# EasyEDA Pro project ProPrj_25G_2026-07-24.epro

# Schematic Schematic4
Assembly Variant: Basic; Board Name: Board1; Create Date: 2026-07-09; Page Name: P1; Project Name: 25G; Schematic Name: Schematic4; Update Date: 2026-07-09; Company: 嘉立创EDA; Page Size: A4; Version: V1.0
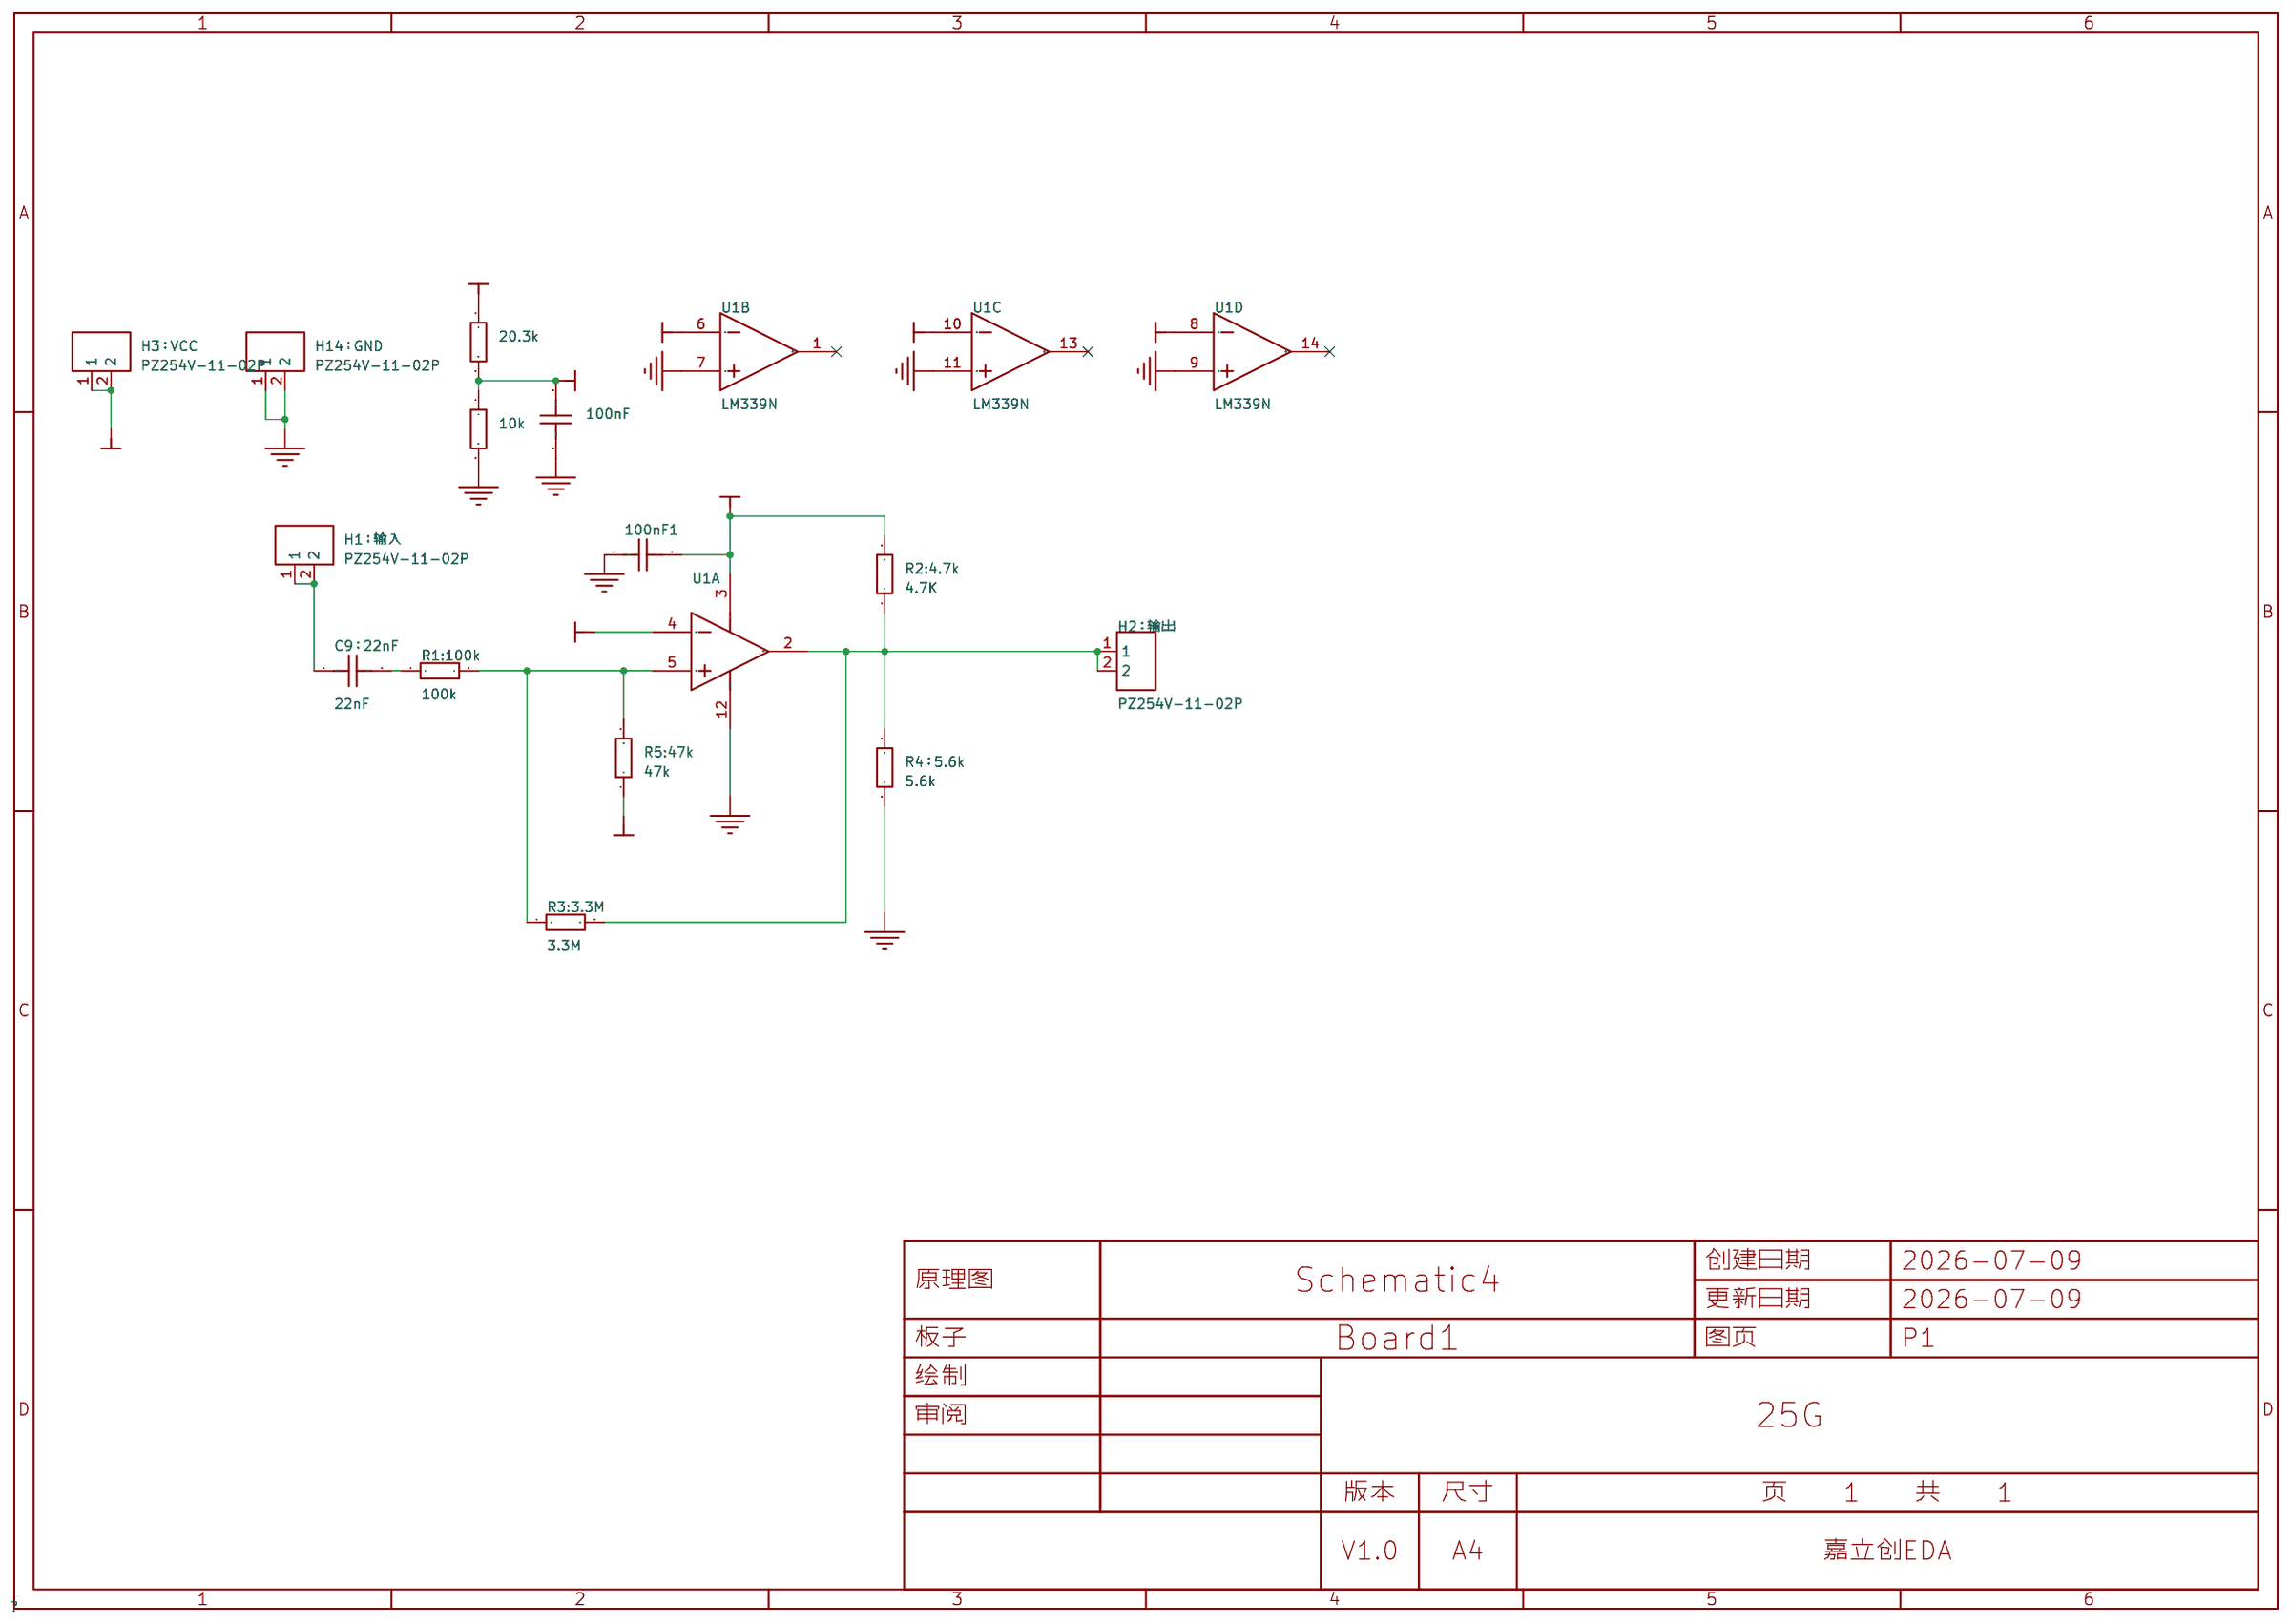
[diagram p0: schematic sheet]

## Parts
10k  20.3k  [R_AXIAL-0.3]
20.3k  20.3k  [R_AXIAL-0.3]
100nF  22nF  [CAP-TH_BD5.3-P2.00-D0.5-FD]
100nF1  22nF  [CAP-TH_BD5.3-P2.00-D0.5-FD]
C9：22nF  22nF  [CAP-TH_BD5.3-P2.00-D0.5-FD]
H1：输入  PZ254V-11-02P  [HDR-TH_2P-P2.54-V-M]
H2：输出  PZ254V-11-02P  [HDR-TH_2P-P2.54-V-M]
H3：VCC  PZ254V-11-02P  [HDR-TH_2P-P2.54-V-M]
H14：GND  PZ254V-11-02P  [HDR-TH_2P-P2.54-V-M]
R1:100k  100k  [R_AXIAL-0.3]
R2:4.7k  4.7K  [R_AXIAL-0.3]
R3:3.3M  3.3M  [R_AXIAL-0.3]
R4：5.6k  5.6k  [R_AXIAL-0.3]
R5:47k  47k  [R_AXIAL-0.3]
U1  LM339N  [PDIP-14_L19.3-W6.4-P2.54-LS9.0-BL]  (sections 1,2,3,4)

## Library data of the parts
10k 20.3k R1:100k R2:4.7k R3:3.3M R4：5.6k R5:47k = Res_0603: Supplier Footprint: 0603
100nF 100nF1 C9：22nF = CAP_0805: Supplier Footprint: 0805
H1：输入 H2：输出 H3：VCC H14：GND = PZ254V-11-02P: 插针结构:1x2P;间距:2.54mm;行距:-;圆针/方针:方针;安装方式:直插;排数:单排;总PIN位数:2P;额定电流:3A;额定电压:250V;配合针长度:6mm;塑高:2.5mm;端接针长度:3mm;触头材质:黄铜;触头镀层:-;工作温度:-40℃~+105℃;颜色:黑色;; LCSC Part Name: 1x2P 间距:2.54mm 方针 直插; Supplier Part: C492401; Manufacturer: XFCN(兴飞); Supplier Footprint: 插件,P=2.54mm; JLCPCB Part Class: Extended Part; Datasheet: https://item.szlcsc.com/datasheet/PZ254V-11-02P/502957.html; Supplier: LCSC; Pin Structure: 1x2P; Pitch: 2.54mm; Circluar Pins/Square Pins: 方针; Mounting Type: 直插; Number of Rows: 单排; Number of Pins: 2P; Current Rating: 3A; Voltage Rating (Max): 250V; Length of Mating Pin: 6mm; Insulation Height: 2.5mm; Length of End Connection Pin: 3mm; Contact Material: 黄铜; Operating Temperature: -40℃~+105℃; Color: 黑色
U1 = LM339N_C39202084: 输入失调电压(Vos):5mV;输入偏置电流(Ib):25nA;; LCSC Part Name: 四差分比较器; Supplier Part: C39202084; Manufacturer: TI(德州仪器); Supplier Footprint: DIP-14; JLCPCB Part Class: Extended Part; Datasheet: https://www.ti.com/lit/gpn/lm339; Supplier: LCSC; Vos - Input Offset Voltage: 5mV; Ib - Input Bias Current: 25nA; Propagation Delay Time: 300ns; Quiescent Current: 2mA; Operating Temperature: -40℃~+85℃

## Nets
GND: 10k.2 100nF.2 100nF1.2 H14：GND.1 H14：GND.2 R4：5.6k.1 U1.7(IN+) U1.9(IN+) U1.11(IN+) U1.12(GND)
VCC: 20.3k.1 100nF1.1 H3：VCC.1 H3：VCC.2 R2:4.7k.2 U1.3(V+)
Vref: 10k.1 20.3k.2 100nF.1 R5:47k.1 U1.4(IN-) U1.6(IN-) U1.8(IN-) U1.10(IN-)
$1N1: C9：22nF.2 H1：输入.1 H1：输入.2
$1N24: C9：22nF.1 R1:100k.1
Net-(H2：输出-1): H2：输出.1 H2：输出.2 R2:4.7k.1 R3:3.3M.2 R4：5.6k.2 U1.2(OUT)
Net-(R1:100k-2): R1:100k.2 R3:3.3M.1 R5:47k.2 U1.5(IN+)

Not connected (* = marked no-connect by the designer): U1 1(OUT)* 13(OUT)* 14(OUT)*

# Schematic Schematic6
Assembly Variant: Basic; Board Name: Board1; Create Date: 2026-07-17; Page Name: P1; Project Name: 25G; Schematic Name: Schematic6; Update Date: 2026-07-17; Company: 嘉立创EDA; Page Size: A4; Version: V1.0
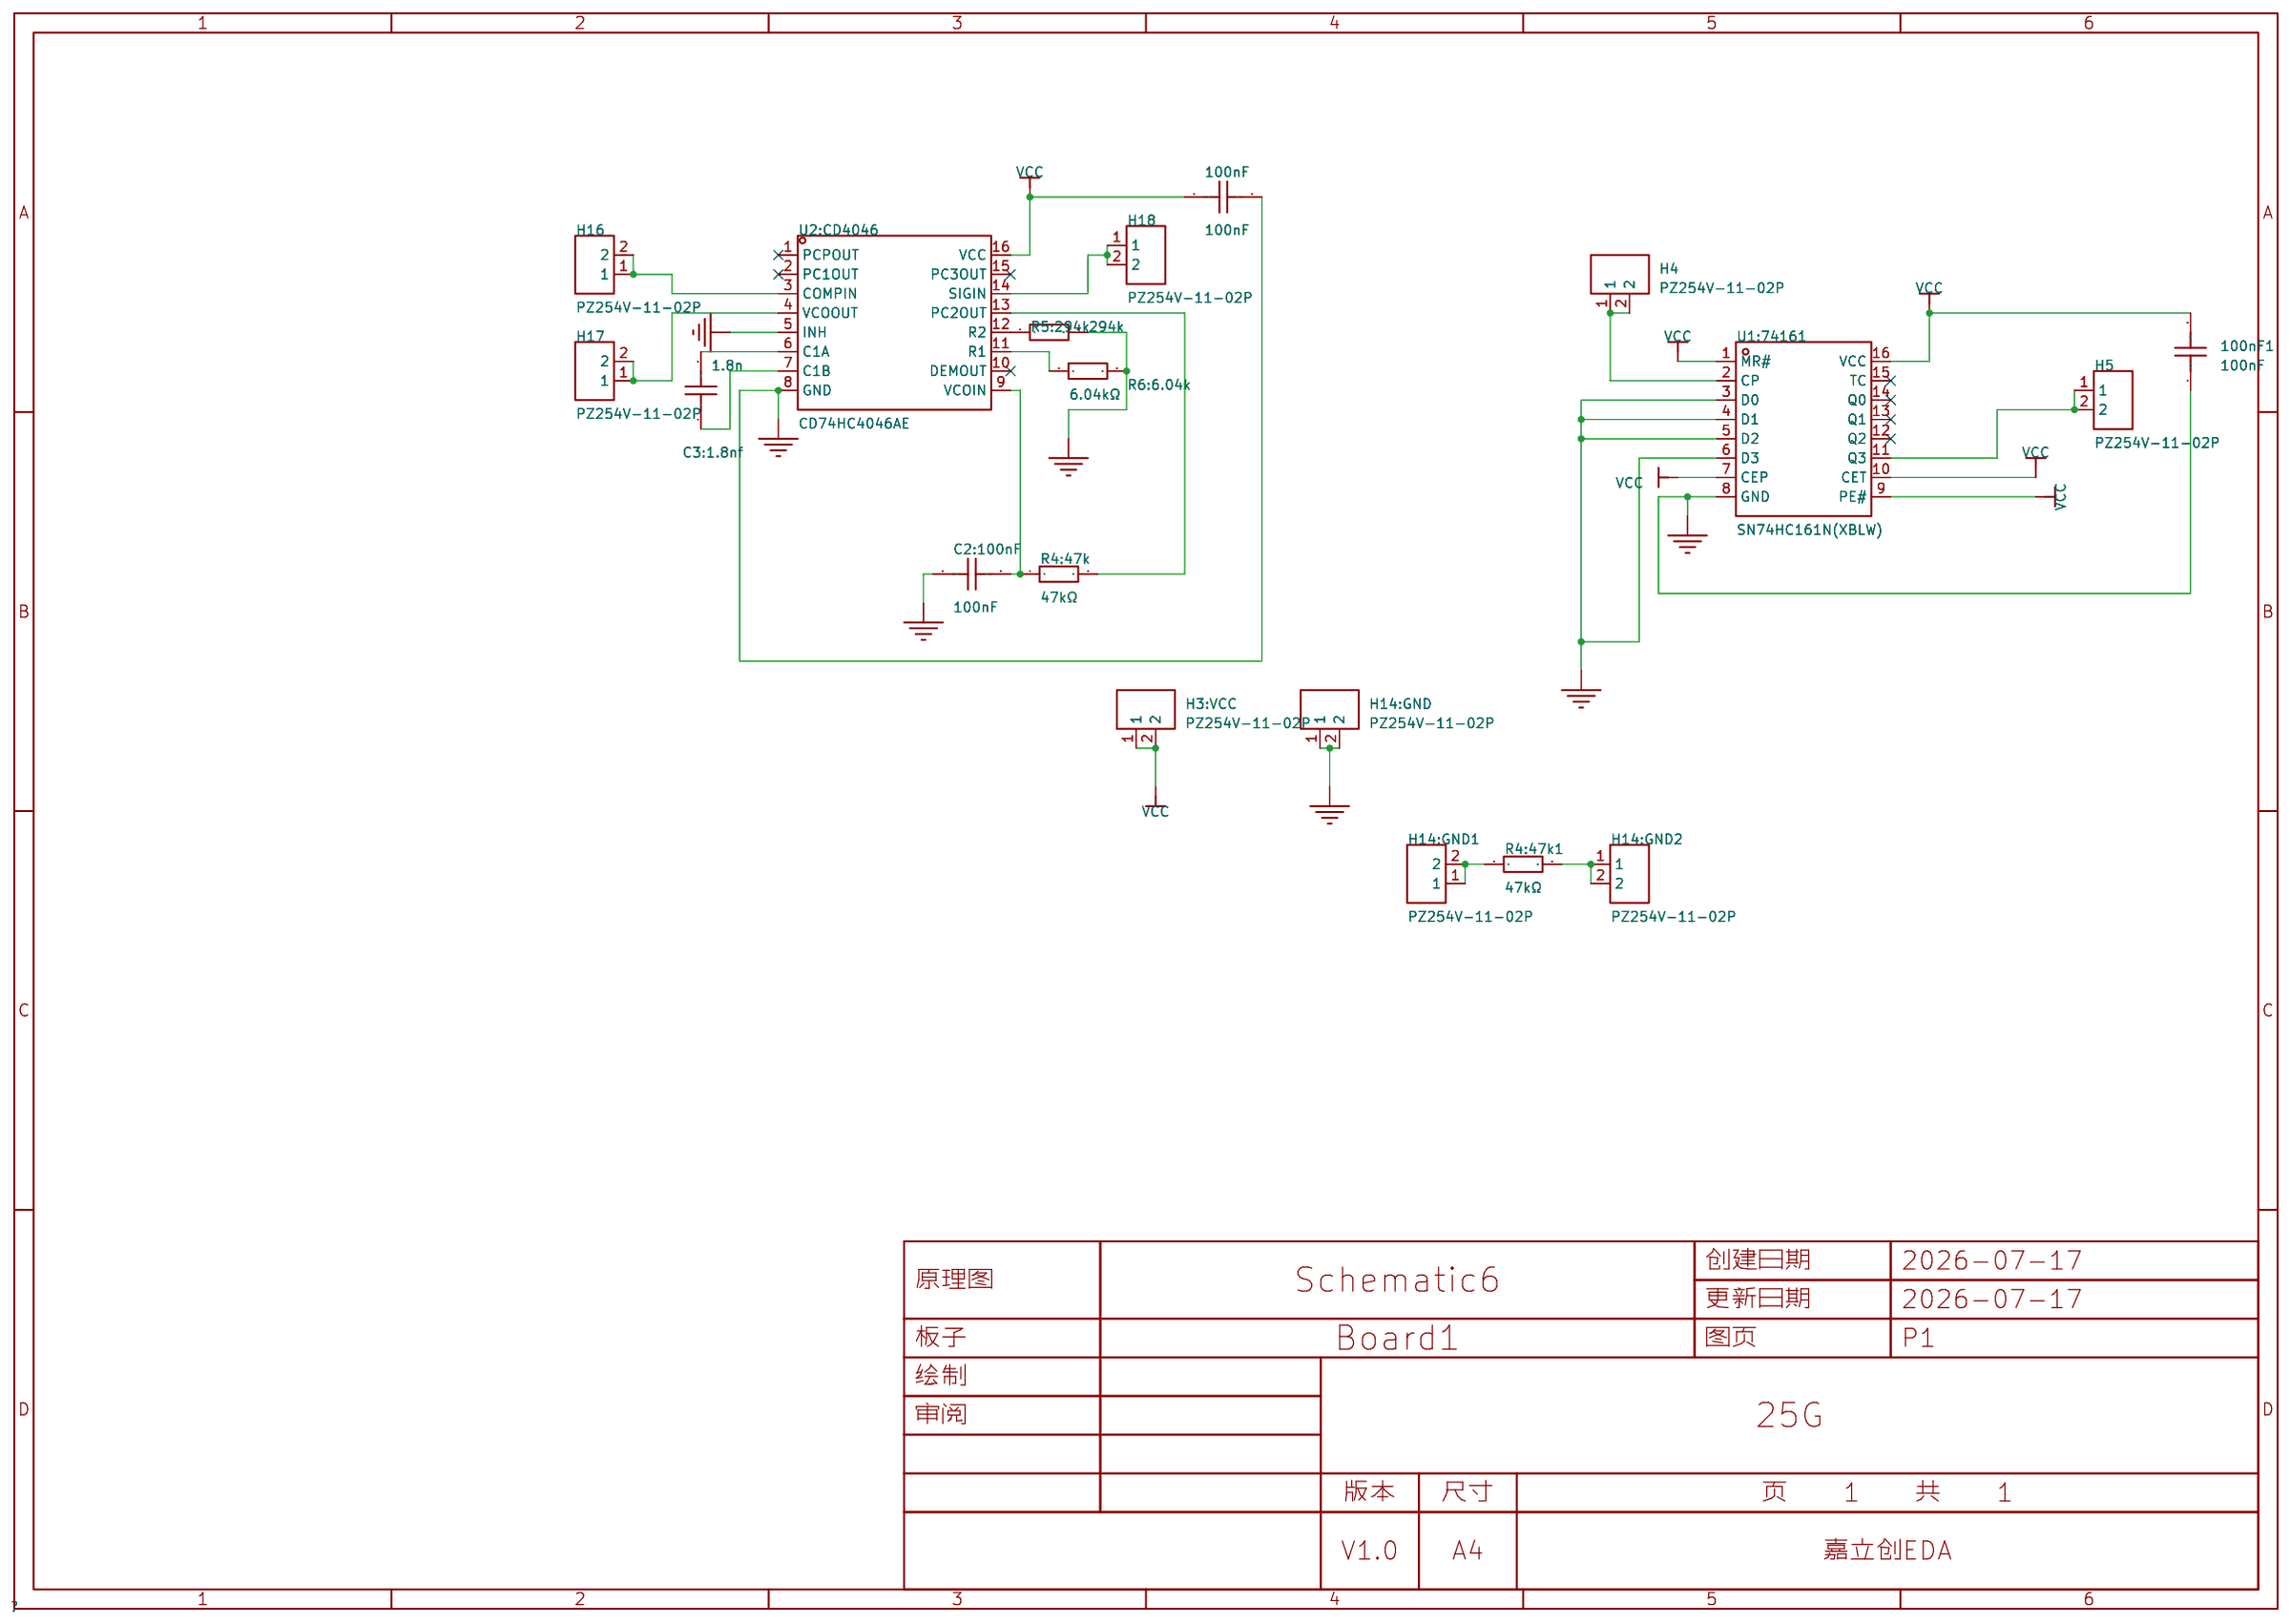
[diagram p1: schematic sheet]

## Parts
100nF  100nF  [CAP-TH_L8.5-W5.0-P5.00-D1.2]
100nF1  100nF  [CAP-TH_L8.5-W5.0-P5.00-D1.2]
C2:100nF  100nF  [CAP-TH_L8.5-W5.0-P5.00-D1.2]
C3:1.8nf  1.8n  [CAP-TH_L8.5-W5.0-P5.00-D1.2]
H3:VCC  PZ254V-11-02P  [HDR-TH_2P-P2.54-V-M]
H4  PZ254V-11-02P  [HDR-TH_2P-P2.54-V-M]
H5  PZ254V-11-02P  [HDR-TH_2P-P2.54-V-M]
H14:GND  PZ254V-11-02P  [HDR-TH_2P-P2.54-V-M]
H14:GND1  PZ254V-11-02P  [HDR-TH_2P-P2.54-V-M]
H14:GND2  PZ254V-11-02P  [HDR-TH_2P-P2.54-V-M]
H16  PZ254V-11-02P  [HDR-TH_2P-P2.54-V-M]
H17  PZ254V-11-02P  [HDR-TH_2P-P2.54-V-M]
H18  PZ254V-11-02P  [HDR-TH_2P-P2.54-V-M]
R4:47k  47kΩ  [R_AXIAL-0.3]
R4:47k1  47kΩ  [R_AXIAL-0.3]
R5:294k  294k  [R_AXIAL-0.3]
R6:6.04k  6.04kΩ  [R_AXIAL-0.3]
U1:74161  SN74HC161N(XBLW)  [PDIP-16_L19.3-W6.4-P2.54-LS7.9-BL]
U2:CD4046  CD74HC4046AE  [PDIP-16_L22.1-W6.3-P2.54-LS7.6-BL]

## Library data of the parts
100nF 100nF1 C2:100nF C3:1.8nf = CT4-0805B104K500F3: 容值:100nF;精度:±10%;额定电压:50V;温度系数:X7R;; LCSC Part Name: 100nF ±10% 50V C3型（直脚）; Supplier Part: C84772; Manufacturer: FH(风华); Supplier Footprint: 插件,P=5.08mm; JLCPCB Part Class: 扩展库; Datasheet: https://atta.szlcsc.com/upload/public/pdf/source/20190402/C385200_059806A6312B28FF1421A2413EB641E1.pdf; Supplier: LCSC; Tolerance: ±10%; Voltage Rated: 50V; Temperature Coefficient: X7R
H3:VCC H4 H5 H14:GND H14:GND1 H14:GND2 H16-H18 = PZ254V-11-02P: 插针结构:1x2P;间距:2.54mm;行距:-;圆针/方针:方针;安装方式:直插;排数:单排;总PIN位数:2P;额定电流:3A;额定电压:250V;配合针长度:6mm;塑高:2.5mm;端接针长度:3mm;触头材质:黄铜;触头镀层:-;工作温度:-40℃~+105℃;颜色:黑色;; LCSC Part Name: 1x2P 间距:2.54mm 方针 直插; Supplier Part: C492401; Manufacturer: XFCN(兴飞); Supplier Footprint: 插件,P=2.54mm; JLCPCB Part Class: Extended Part; Datasheet: https://item.szlcsc.com/datasheet/PZ254V-11-02P/502957.html; Supplier: LCSC; Pin Structure: 1x2P; Pitch: 2.54mm; Circluar Pins/Square Pins: 方针; Mounting Type: 直插; Number of Rows: 单排; Number of Pins: 2P; Current Rating: 3A; Voltage Rating (Max): 250V; Length of Mating Pin: 6mm; Insulation Height: 2.5mm; Length of End Connection Pin: 3mm; Contact Material: 黄铜; Operating Temperature: -40℃~+105℃; Color: 黑色
R4:47k R4:47k1 R5:294k R6:6.04k = Res_AXIAL-1/8W: Supplier Footprint: 轴向引线
U1:74161 = SN74HC161N(XBLW): 工作电压:2V~6V;触发沿:上升沿;计数速率:48MHz;; LCSC Part Name: SN74HC161N; Supplier Part: C18723509; Manufacturer: XBLW(芯伯乐); Supplier Footprint: DIP-16; JLCPCB Part Class: 扩展库; Datasheet: https://atta.szlcsc.com/upload/public/pdf/source/20231019/E4ACCDE238F6D312E2887AAFD4BE47C0.pdf; Supplier: LCSC; Supply Voltage: 2V~6V; Trigger Type: 上升沿; Reset Style: 异步; Timing mode: 同步; Count Rate: 48MHz; Operating Temperature: -40℃~+105℃
U2:CD4046 = CD74HC4046AE: 最大输出频率:38MHz;输出通道数:3;; LCSC Part Name: IC PLL W/VCO; Supplier Part: C354049; Manufacturer: TI(德州仪器); Supplier Footprint: PDIP-16; JLCPCB Part Class: 扩展库; Datasheet: https://www.ti.com/cn/lit/gpn/cd74hc4046a; Supplier: LCSC; Output Frequency(Max): 38MHz; Voltage - Supply: 2V~6V; Number of Outputs: 3; Operating Temperature: -55℃~+125℃

## Nets
GND: 100nF.2 100nF1.1 C2:100nF.1 H14:GND.1 H14:GND.2 R5:294k.2 R6:6.04k.2 U1:74161.3(D0) U1:74161.4(D1) U1:74161.5(D2) U1:74161.6(D3) U1:74161.8(GND) U2:CD4046.5(INH) U2:CD4046.8(GND)
VCC: 100nF.1 100nF1.2 H3:VCC.1 H3:VCC.2 U1:74161.1(MR#) U1:74161.7(CEP) U1:74161.9(PE#) U1:74161.10(CET) U1:74161.16(VCC) U2:CD4046.16(VCC)
$1N3: H18.1 H18.2 U2:CD4046.14(SIGIN)
$1N6: R5:294k.1 U2:CD4046.12(R2)
$1N8: C3:1.8nf.1 U2:CD4046.7(C1B)
$1N9: C3:1.8nf.2 U2:CD4046.6(C1A)
$1N10: R4:47k.2 U2:CD4046.13(PC2OUT)
$1N11: C2:100nF.2 R4:47k.1 U2:CD4046.9(VCOIN)
$1N13: H16.1 H16.2 U2:CD4046.3(COMPIN)
$1N14: H17.1 H17.2 U2:CD4046.4(VCOOUT)
$1N15: H5.1 H5.2 U1:74161.11(Q3)
$1N16: H4.1 H4.2 U1:74161.2(CP)
$1N28: H14:GND2.1 H14:GND2.2 R4:47k1.2
Net-(H14:GND1-1): H14:GND1.1 H14:GND1.2 R4:47k1.1
Net-(R6:6.04k-1): R6:6.04k.1 U2:CD4046.11(R1)

Not connected (* = marked no-connect by the designer): U1:74161 12(Q2)* 13(Q1)* 14(Q0)* 15(TC)*; U2:CD4046 1(PCPOUT)* 2(PC1OUT)* 10(DEMOUT)* 15(PC3OUT)*

# Schematic Schematic5
Assembly Variant: Basic; Board Name: Board1; Create Date: 2026-07-17; Page Name: P1; Project Name: 25G; Schematic Name: Schematic5; Update Date: 2026-07-17; Company: 嘉立创EDA; Page Size: A4; Version: V1.0
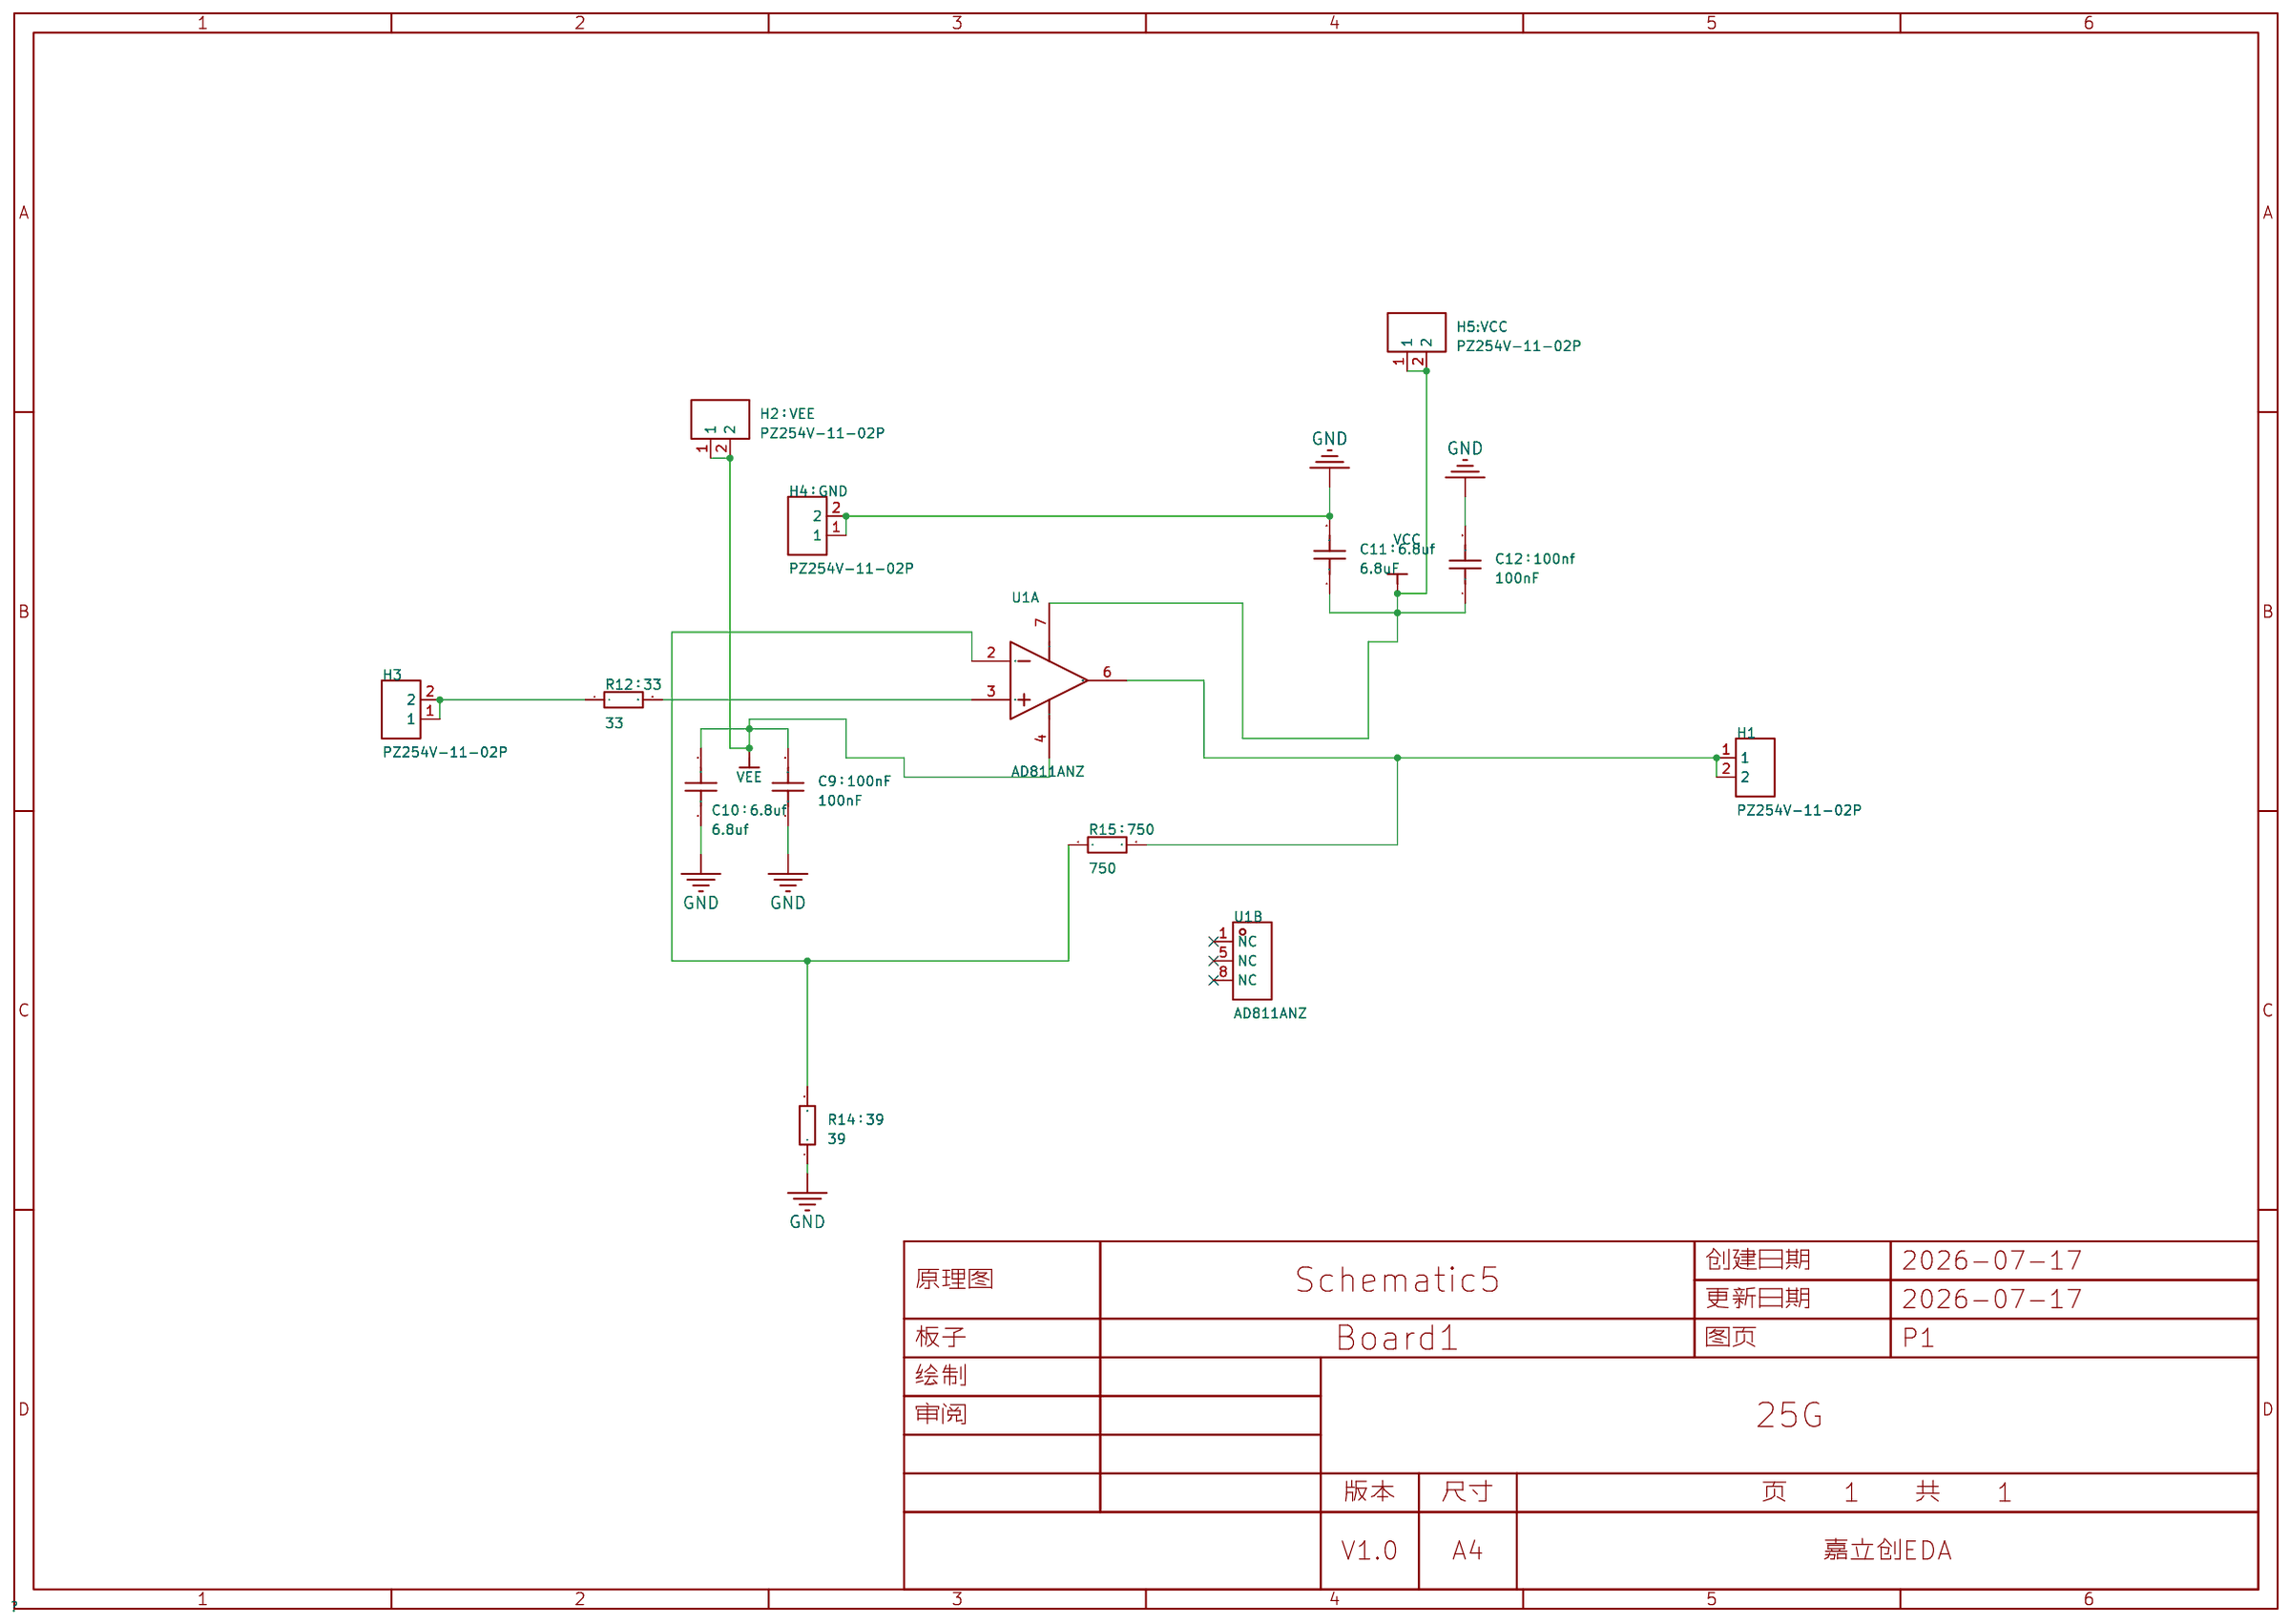
[diagram p2: schematic sheet]

## Parts
C9：100nF  100nF  [CAP-TH_BD5.3-P2.00-D0.5-FD]
C10：6.8uf  6.8uf  [CAP-TH_BD5.3-P2.00-D0.5-FD]
C11：6.8uf  6.8uF  [CAP-TH_BD5.3-P2.00-D0.5-FD]
C12：100nf  100nF  [CAP-TH_BD5.3-P2.00-D0.5-FD]
H1  PZ254V-11-02P  [HDR-TH_2P-P2.54-V-M]
H2：VEE  PZ254V-11-02P  [HDR-TH_2P-P2.54-V-M]
H3  PZ254V-11-02P  [HDR-TH_2P-P2.54-V-M]
H4：GND  PZ254V-11-02P  [HDR-TH_2P-P2.54-V-M]
H5:VCC  PZ254V-11-02P  [HDR-TH_2P-P2.54-V-M]
R12：33  33  [R_AXIAL-0.3]
R14：39  39  [R_AXIAL-0.3]
R15：750  750  [R_AXIAL-0.3]
U1  AD811ANZ  [PDIP-8_L9.3-W6.4-P2.54-LS7.9-BL-1]  (sections 1,2)

## Library data of the parts
C9：100nF C10：6.8uf C11：6.8uf C12：100nf = CAP_0805: Supplier Footprint: 0805
H1 H2：VEE H3 H4：GND H5:VCC = PZ254V-11-02P: 插针结构:1x2P;间距:2.54mm;行距:-;圆针/方针:方针;安装方式:直插;排数:单排;总PIN位数:2P;额定电流:3A;额定电压:250V;配合针长度:6mm;塑高:2.5mm;端接针长度:3mm;触头材质:黄铜;触头镀层:-;工作温度:-40℃~+105℃;颜色:黑色;; LCSC Part Name: 1x2P 间距:2.54mm 方针 直插; Supplier Part: C492401; Manufacturer: XFCN(兴飞); Supplier Footprint: 插件,P=2.54mm; JLCPCB Part Class: Extended Part; Datasheet: https://item.szlcsc.com/datasheet/PZ254V-11-02P/502957.html; Supplier: LCSC; Pin Structure: 1x2P; Pitch: 2.54mm; Circluar Pins/Square Pins: 方针; Mounting Type: 直插; Number of Rows: 单排; Number of Pins: 2P; Current Rating: 3A; Voltage Rating (Max): 250V; Length of Mating Pin: 6mm; Insulation Height: 2.5mm; Length of End Connection Pin: 3mm; Contact Material: 黄铜; Operating Temperature: -40℃~+105℃; Color: 黑色
R12：33 R14：39 R15：750 = Res_0805: Supplier Footprint: 0805
U1 = AD811ANZ: 放大器数:单路;带宽(-3db):140MHz;压摆率(SR):2500V/us;输入偏置电流(Ib):2uA;; LCSC Part Name: 高带宽电流反馈运算放大器; Supplier Part: C578626; Manufacturer: ADI(亚德诺); Supplier Footprint: PDIP-8; JLCPCB Part Class: Extended Part; Datasheet: https://item.szlcsc.com/datasheet/AD811ANZ/606403.html; Supplier: LCSC; Number of Channels: 单路; -3dB Bandwidth: 140MHz; Slew Rate: 2500V/us; Differential Gain: 0.01%; Differential Phase: 0.01deg; Voltage - Supply: 4.5V~18V；-18V~-4.5V; Ib - Input Bias Current: 2uA; Operating Temperature: -40℃~+85℃

## Nets
GND: C9：100nF.1 C10：6.8uf.1 C11：6.8uf.2 C12：100nf.2 H4：GND.1 H4：GND.2 R14：39.1
VCC: C11：6.8uf.1 C12：100nf.1 H5:VCC.1 H5:VCC.2 U1.7(V+)
VEE: C9：100nF.2 C10：6.8uf.2 H2：VEE.1 H2：VEE.2 U1.4(V-)
$1N1: H1.1 H1.2 R15：750.2 U1.6(OUT)
$1N3: R14：39.2 R15：750.1 U1.2(IN-)
$1N6: H3.1 H3.2 R12：33.1
$1N15: R12：33.2 U1.3(IN+)

Not connected (* = marked no-connect by the designer): U1 1(NC)* 5(NC)* 8(NC)*

# Schematic Schematic1
Board Name: Board1; Create Date: 2025-07-21
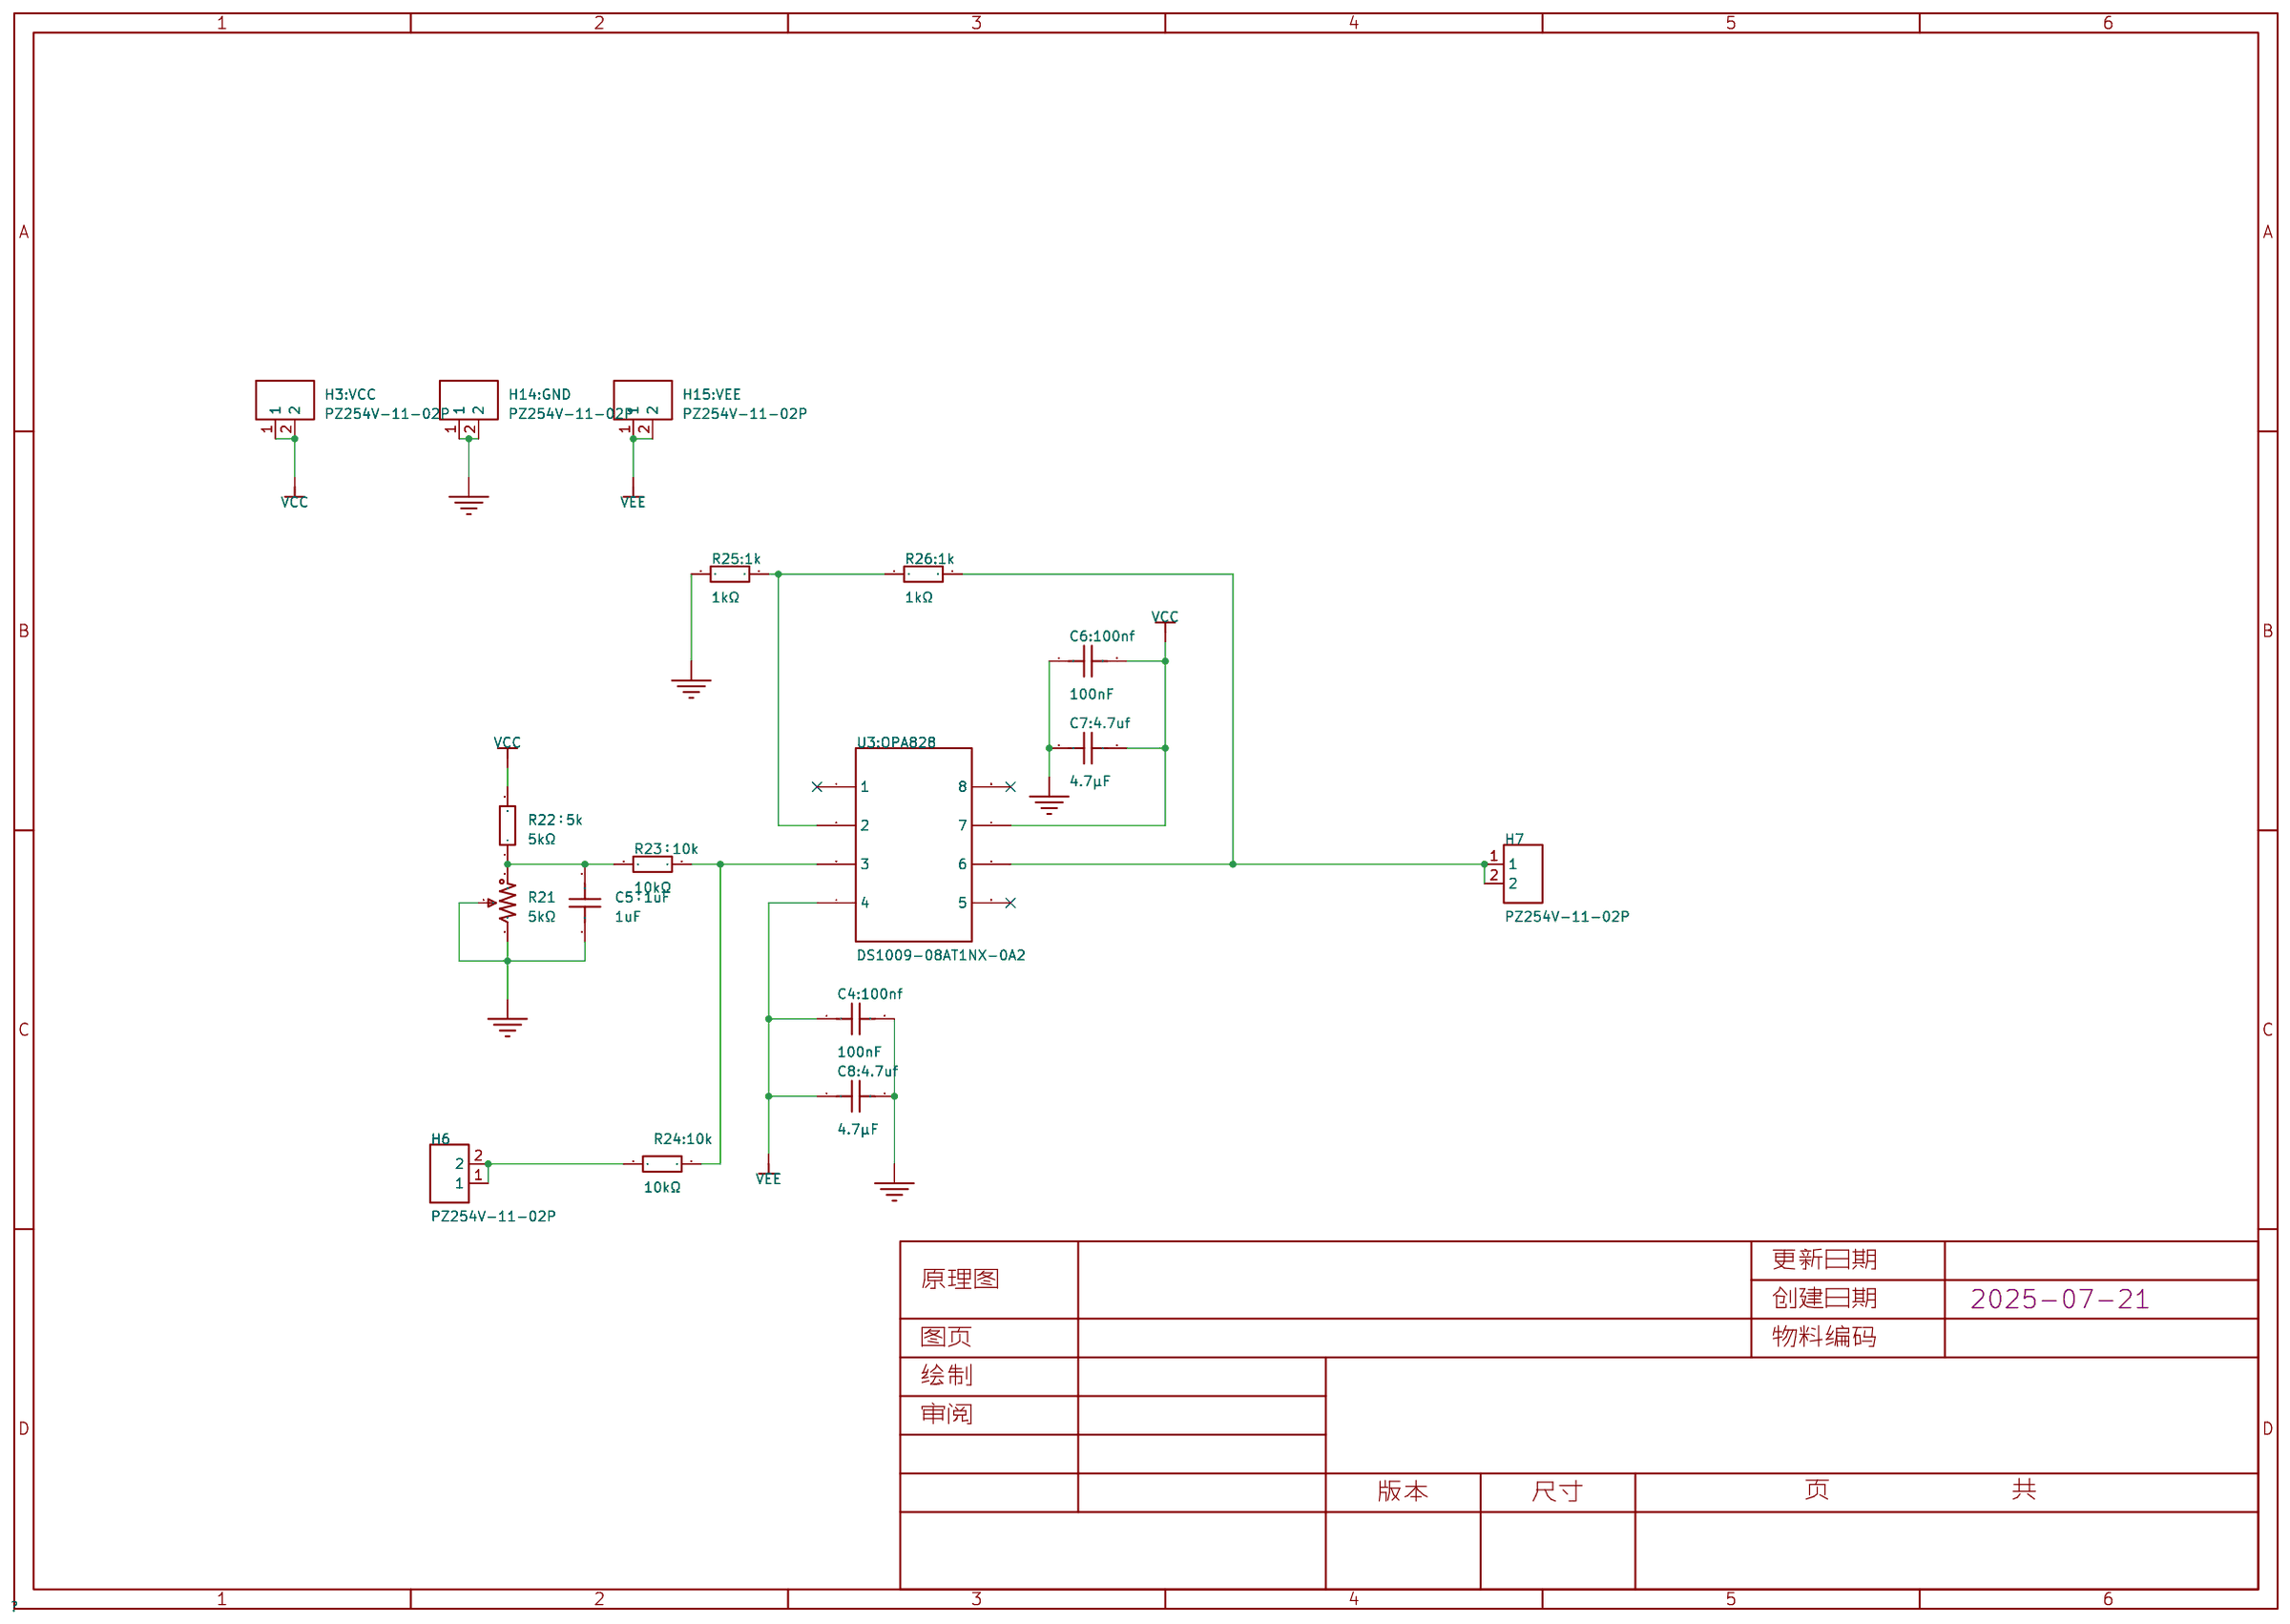
[diagram p3: schematic sheet]

## Parts
C4:100nf  100nF  [CAP-TH_L8.5-W5.0-P5.00-D1.2]
C5：1uF  1uF  [CAP-TH_L8.5-W5.0-P5.00-D1.2]
C6:100nf  100nF  [CAP-TH_L8.5-W5.0-P5.00-D1.2]
C7:4.7uf  4.7μF  [CAP-TH_L8.5-W5.0-P5.00-D1.2]
C8:4.7uf  4.7μF  [CAP-TH_L8.5-W5.0-P5.00-D1.2]
H3:VCC  PZ254V-11-02P  [HDR-TH_2P-P2.54-V-M]
H6  PZ254V-11-02P  [HDR-TH_2P-P2.54-V-M]
H7  PZ254V-11-02P  [HDR-TH_2P-P2.54-V-M]
H14:GND  PZ254V-11-02P  [HDR-TH_2P-P2.54-V-M]
H15:VEE  PZ254V-11-02P  [HDR-TH_2P-P2.54-V-M]
R21  5kΩ  [RES-ADJ-TH_3296W-1-104_C48601076]
R22：5k  5kΩ  [R_AXIAL-0.3]
R23：10k  10kΩ  [R_AXIAL-0.3]
R24:10k  10kΩ  [R_AXIAL-0.3]
R25:1k  1kΩ  [R_AXIAL-0.3]
R26:1k  1kΩ  [R_AXIAL-0.3]
U3:OPA828  DS1009-08AT1NX-0A2  [DIP-8_L10.2-W10.2-P2.54-LS7.6-BL]

## Library data of the parts
C4:100nf C5：1uF C6:100nf C7:4.7uf C8:4.7uf = CT4-0805B104K500F3: 容值:100nF;精度:±10%;额定电压:50V;温度系数:X7R;; LCSC Part Name: 100nF ±10% 50V C3型（直脚）; Supplier Part: C84772; Manufacturer: FH(风华); Supplier Footprint: 插件,P=5.08mm; JLCPCB Part Class: 扩展库; Datasheet: https://atta.szlcsc.com/upload/public/pdf/source/20190402/C385200_059806A6312B28FF1421A2413EB641E1.pdf; Supplier: LCSC; Tolerance: ±10%; Voltage Rated: 50V; Temperature Coefficient: X7R
H3:VCC H6 H7 H14:GND H15:VEE = PZ254V-11-02P: 插针结构:1x2P;间距:2.54mm;行距:-;圆针/方针:方针;安装方式:直插;排数:单排;总PIN位数:2P;额定电流:3A;额定电压:250V;配合针长度:6mm;塑高:2.5mm;端接针长度:3mm;触头材质:黄铜;触头镀层:-;工作温度:-40℃~+105℃;颜色:黑色;; LCSC Part Name: 1x2P 间距:2.54mm 方针 直插; Supplier Part: C492401; Manufacturer: XFCN(兴飞); Supplier Footprint: 插件,P=2.54mm; JLCPCB Part Class: Extended Part; Datasheet: https://item.szlcsc.com/datasheet/PZ254V-11-02P/502957.html; Supplier: LCSC; Pin Structure: 1x2P; Pitch: 2.54mm; Circluar Pins/Square Pins: 方针; Mounting Type: 直插; Number of Rows: 单排; Number of Pins: 2P; Current Rating: 3A; Voltage Rating (Max): 250V; Length of Mating Pin: 6mm; Insulation Height: 2.5mm; Length of End Connection Pin: 3mm; Contact Material: 黄铜; Operating Temperature: -40℃~+105℃; Color: 黑色
R21 = 3296W-1-103: 阻值:10kΩ;精度:±10%;; LCSC Part Name: 10kΩ ±10%; Supplier Part: C118954; Manufacturer: BOCHEN(博晨); Supplier Footprint: 插件; JLCPCB Part Class: 扩展库; Datasheet: https://atta.szlcsc.com/upload/public/pdf/source/20171114/C118954_15106326646611117443.pdf; Supplier: LCSC; Tolerance: ±10%
R22：5k R23：10k R24:10k R25:1k R26:1k = Res_AXIAL-1/8W: Supplier Footprint: 轴向引线
U3:OPA828 = DS1009-08AT1NX-0A2: 适用IC封装类型:DIP;间距:2.54mm;行距:7.62mm;总针脚数:8P;触头镀层:锡;; LCSC Part Name: 间距2.54mm P数:8P; Supplier Part: C72124; Manufacturer: CONNFLY; Supplier Footprint: DIP-8; JLCPCB Part Class: Extended Part; Datasheet: https://atta.szlcsc.com/upload/public/pdf/source/20160429/1461922462758.pdf; Supplier: LCSC; IC Type: DIP; Pitch: 2.54mm; Row Spacing: 7.62mm; Number of Positions: 8P; Contact Plating: 锡

## Nets
GND: C4:100nf.2 C5：1uF.1 C6:100nf.1 C7:4.7uf.1 C8:4.7uf.2 H14:GND.1 H14:GND.2 R21.2 R21.3 R25:1k.2
VCC: C6:100nf.2 C7:4.7uf.2 H3:VCC.1 H3:VCC.2 R22：5k.2 U3:OPA828.7
VEE: C4:100nf.1 C8:4.7uf.1 H15:VEE.1 H15:VEE.2 U3:OPA828.4
$1N2043: R25:1k.1 R26:1k.2 U3:OPA828.2
$1N2044: R23：10k.1 R24:10k.1 U3:OPA828.3
$1N2047: C5：1uF.2 R21.1 R22：5k.1 R23：10k.2
$1N2065: H6.1 H6.2 R24:10k.2
$1N2070: H7.1 H7.2 R26:1k.1 U3:OPA828.6

Not connected (* = marked no-connect by the designer): U3:OPA828 1* 5* 8*

# Schematic Schematic3
Assembly Variant: Basic; Board Name: Board1; Create Date: 2026-07-08; Page Name: P1; Project Name: 25G; Schematic Name: Schematic3; Update Date: 2026-07-08; Company: 嘉立创EDA; Page Size: A4; Version: V1.0
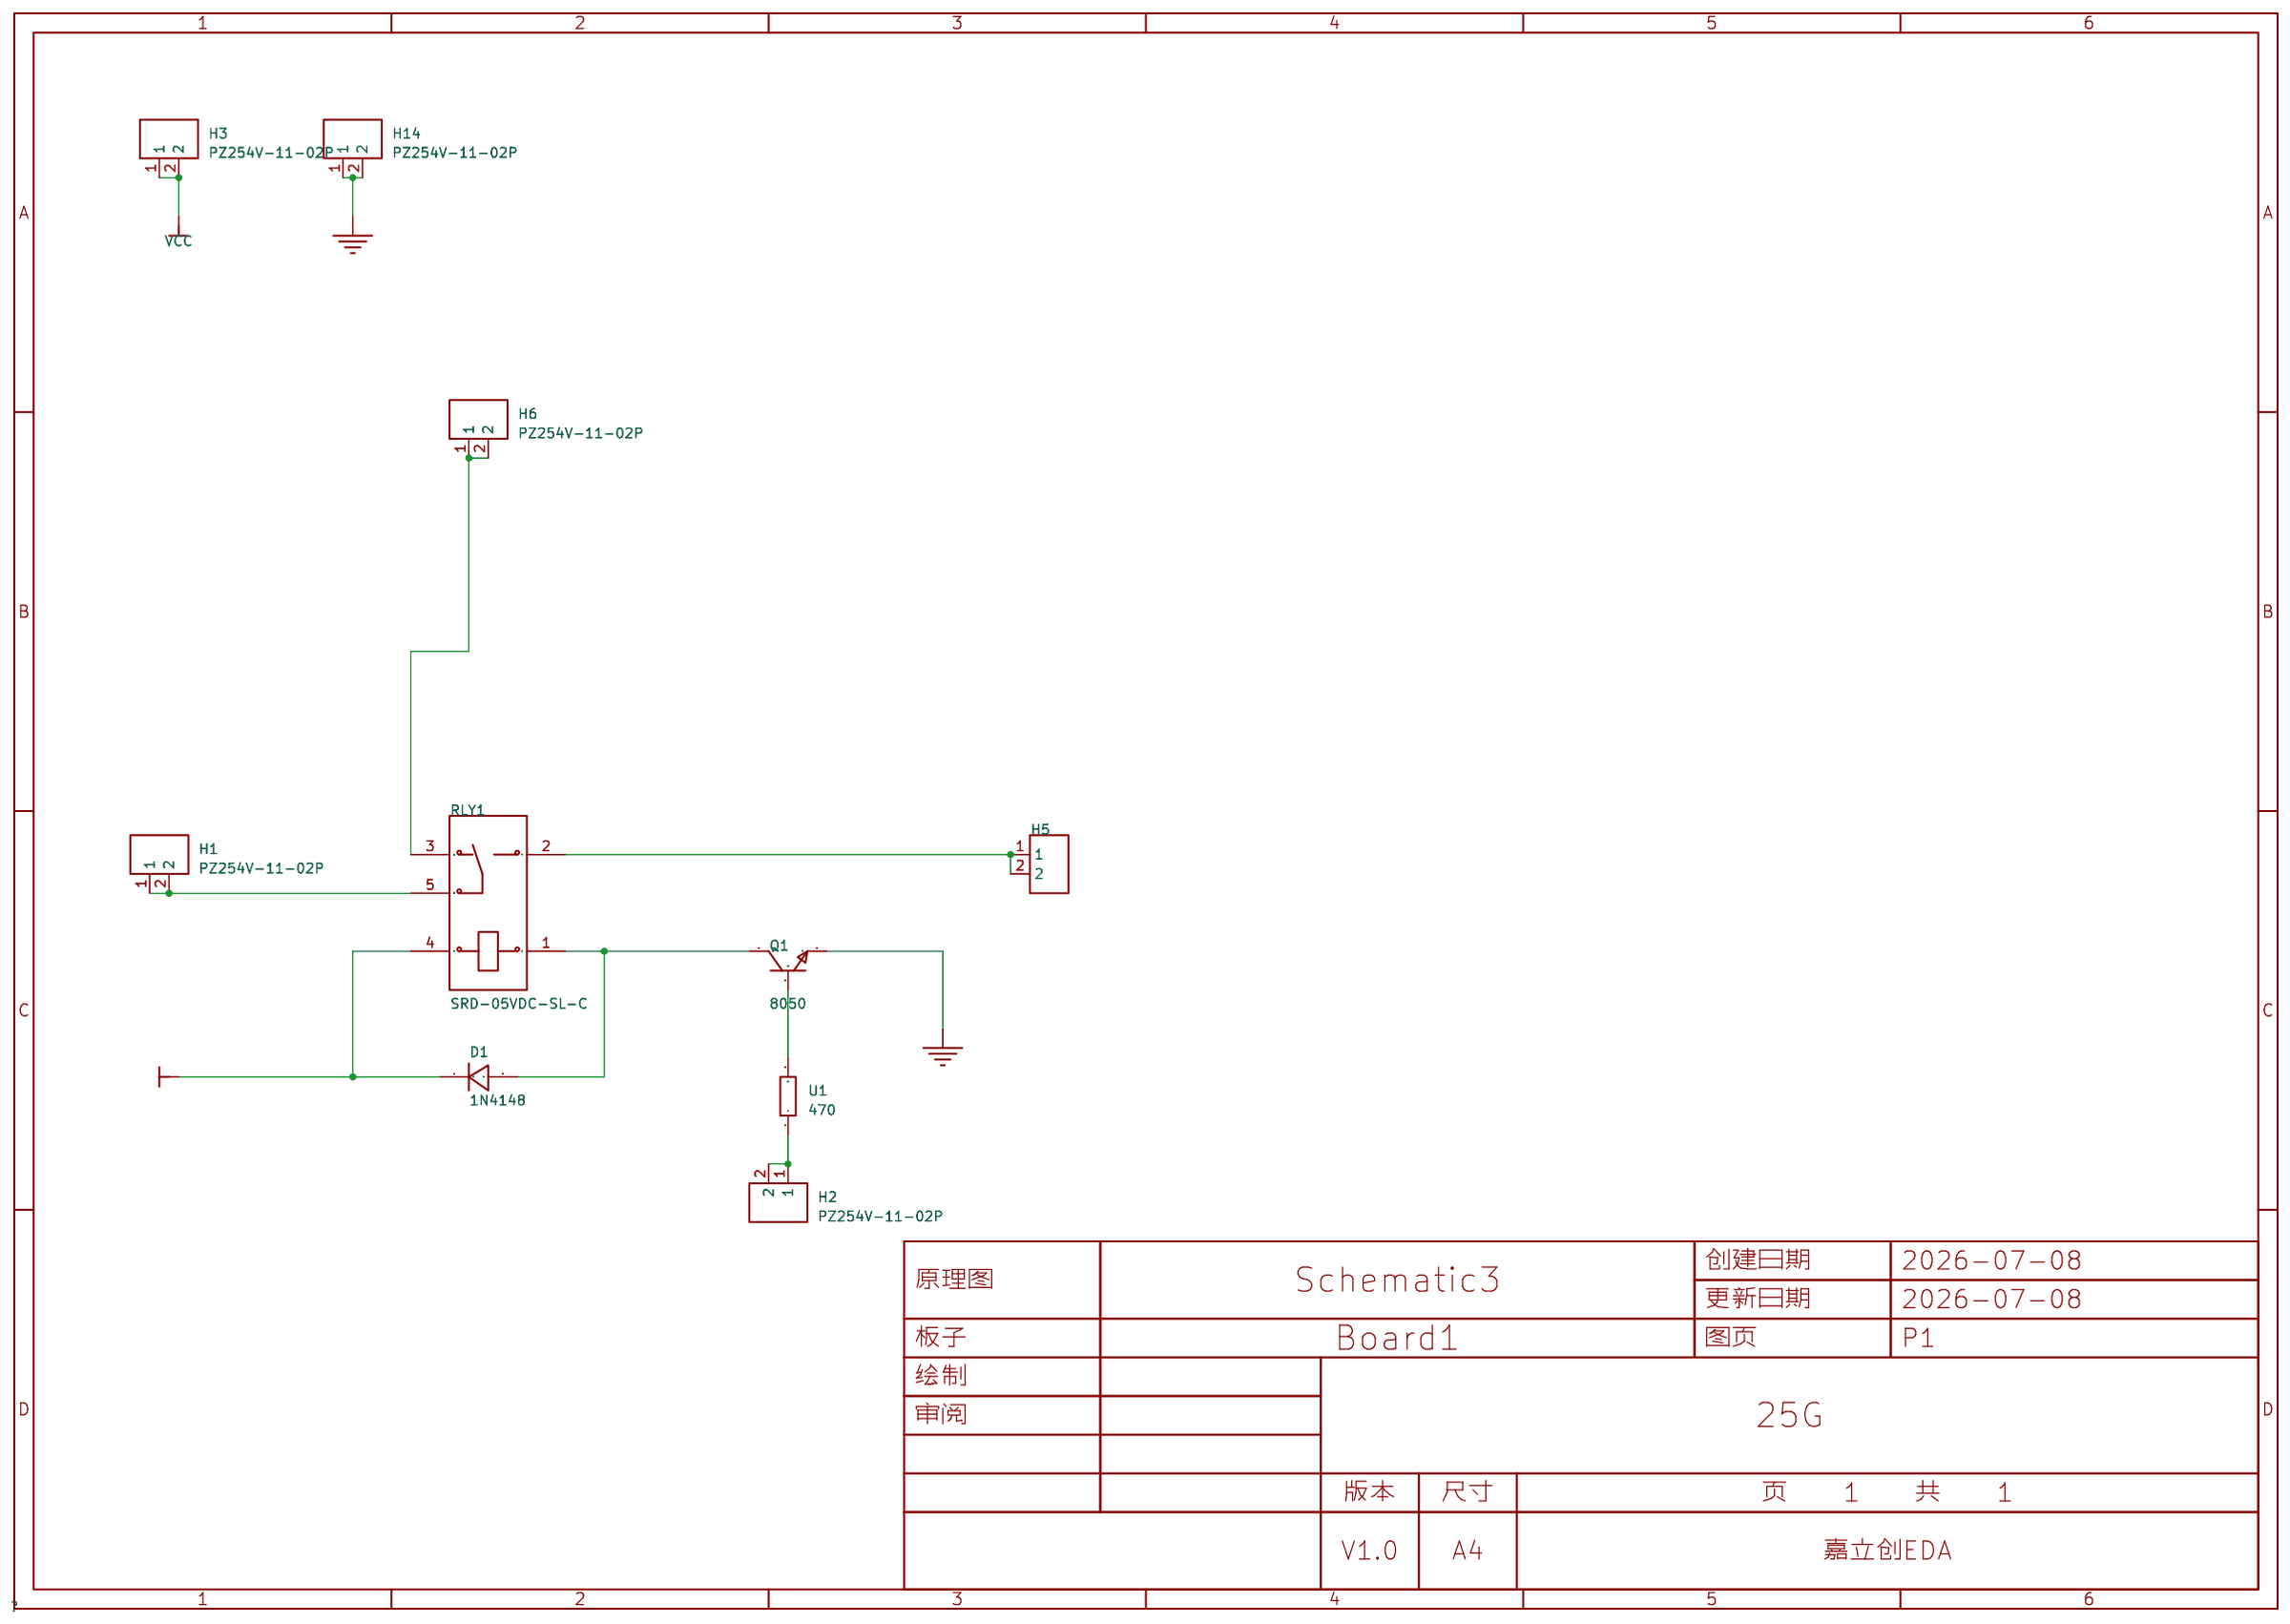
[diagram p4: schematic sheet]

## Parts
D1  1N4148  [DO-35_BD2.0-L4.2-P8.20-D0.5-RD]
H1  PZ254V-11-02P  [HDR-TH_2P-P2.54-V-M]
H2  PZ254V-11-02P  [HDR-TH_2P-P2.54-V-M]
H3  PZ254V-11-02P  [HDR-TH_2P-P2.54-V-M]
H5  PZ254V-11-02P  [HDR-TH_2P-P2.54-V-M]
H6  PZ254V-11-02P  [HDR-TH_2P-P2.54-V-M]
H14  PZ254V-11-02P  [HDR-TH_2P-P2.54-V-M]
Q1  8050  [TO-92-3_L4.8-W3.7-P2.54-R]
RLY1  SRD-05VDC-SL-C  [RELAY-TH_SRD-XXVDC-XL-C]
U1  470  [RES-TH_BD2.2-L6.0-P10.00-D0.5]

## Library data of the parts
D1 = 1N4148_C402212: 二极管配置:-;正向压降(Vf):1V@10mA;直流反向耐压(Vr):75V;整流电流:150mA;反向恢复时间(Trr):4ns;; LCSC Part Name: 75V 150mA; Supplier Part: C402212; Manufacturer: LGE(鲁光); Supplier Footprint: DO-35; JLCPCB Part Class: Extended Part; Datasheet: https://item.szlcsc.com/datasheet/1N4148/387357.html; Supplier: LCSC; Voltage - Forward(Vf@If): 1V@10mA; Voltage - DC Reverse(Vr): 75V; Current - Rectified: 150mA; Pd - Power Dissipation: 500mW; Reverse Leakage Current (Ir): 5uA@75V; Reverse Recovery Time (trr): 4ns; Non-Repetitive Peak Forward Surge Current: 2A
H1-H3 H5 H6 H14 = PZ254V-11-02P: 插针结构:1x2P;间距:2.54mm;行距:-;圆针/方针:方针;安装方式:直插;排数:单排;总PIN位数:2P;额定电流:3A;额定电压:250V;配合针长度:6mm;塑高:2.5mm;端接针长度:3mm;触头材质:黄铜;触头镀层:-;工作温度:-40℃~+105℃;颜色:黑色;; LCSC Part Name: 1x2P 间距:2.54mm 方针 直插; Supplier Part: C492401; Manufacturer: XFCN(兴飞); Supplier Footprint: 插件,P=2.54mm; JLCPCB Part Class: Extended Part; Datasheet: https://item.szlcsc.com/datasheet/PZ254V-11-02P/502957.html; Supplier: LCSC; Pin Structure: 1x2P; Pitch: 2.54mm; Circluar Pins/Square Pins: 方针; Mounting Type: 直插; Number of Rows: 单排; Number of Pins: 2P; Current Rating: 3A; Voltage Rating (Max): 250V; Length of Mating Pin: 6mm; Insulation Height: 2.5mm; Length of End Connection Pin: 3mm; Contact Material: 黄铜; Operating Temperature: -40℃~+105℃; Color: 黑色
Q1 = 8050: 晶体管类型:NPN;集电极电流(Ic):1.5A;集射极击穿电压(Vceo):25V;耗散功率(Pd):1W;直流电流增益(hFE):300@100mA,1V;; LCSC Part Name: TO-92塑封封装NPN半导体三极管 NPN 电流:1.5A 电压:25V; Supplier Part: C3037602; Manufacturer: BLUE ROCKET(蓝箭); Supplier Footprint: TO-92-2.54mm; JLCPCB Part Class: Extended Part; Datasheet: https://item.szlcsc.com/datasheet/8050/3589216.html; Supplier: LCSC; type: NPN; Current - Collector(Ic): 1.5A; Collector - Emitter Voltage VCEO: 25V; Pd - Power Dissipation: 1W; DC Current Gain: 300@100mA,1V; Transition frequency(fT): 200MHz; Current - Collector Cutoff: 100nA; Vce Saturation(VCE(sat)): 500mV@800mA,80mA; Emitter-Base Voltage(Vebo): 6V; Number: 1个NPN
RLY1 = SRD-05VDC-SL-C: 线圈电压:5V;触点形式:一组转换:1C(单刀双掷-转换);触点容量(电阻负载):-;最大切换电压:250V@AC;最大切换电流:15A;; LCSC Part Name: 蓝色 单组转换型继电器; Supplier Part: C35449; Manufacturer: 松乐; Supplier Footprint: 插件,19.2x15.6mm; JLCPCB Part Class: Extended Part; Datasheet: https://item.szlcsc.com/datasheet/SRD-05VDC-SL-C/36422.html; Supplier: LCSC; Coil Voltage: 5V; Contact Form: 一组转换:1C(单刀双掷-转换); Number of Pins: 5; Switching Voltage(Max): 250V@AC; Coil Rated Power: 360mW; Switching Current(Max): 15A; Coil Type: 无极性-单线圈; Coil Resistance: 70Ω; Contact Resistance: 100mΩ; Operate Time: 10ms; Release Time: 10ms; Length: 19.2mm; Width: 15.6mm
U1 = AXIAL-0.4_C9900020985: LCSC Part Name: AXIAL-0.4; Supplier Part: C9900020985; Supplier Footprint: RES-TH; JLCPCB Part Class: Extended Part; Supplier: LCSC

## Nets
GND: H14.1 H14.2 Q1.3(E)
VCC: D1.1(C) H3.1 H3.2 RLY1.4
$1N3: H1.1 H1.2 RLY1.5
$1N4: D1.2(A) Q1.1(C) RLY1.1
$1N8: Q1.2(B) U1.2
$1N10: H2.1 H2.2 U1.1
$1N11: H6.1 H6.2 RLY1.3
$1N14: H5.1 H5.2 RLY1.2

# Schematic Schematic2_1
Assembly Variant: Basic; Board Name: Board2; Create Date: 2026-07-08; Page Name: P1; Project Name: 4046; Schematic Name: Schematic2; Update Date: 2026-07-08; Company: 嘉立创EDA; Page Size: A4; Version: V1.0
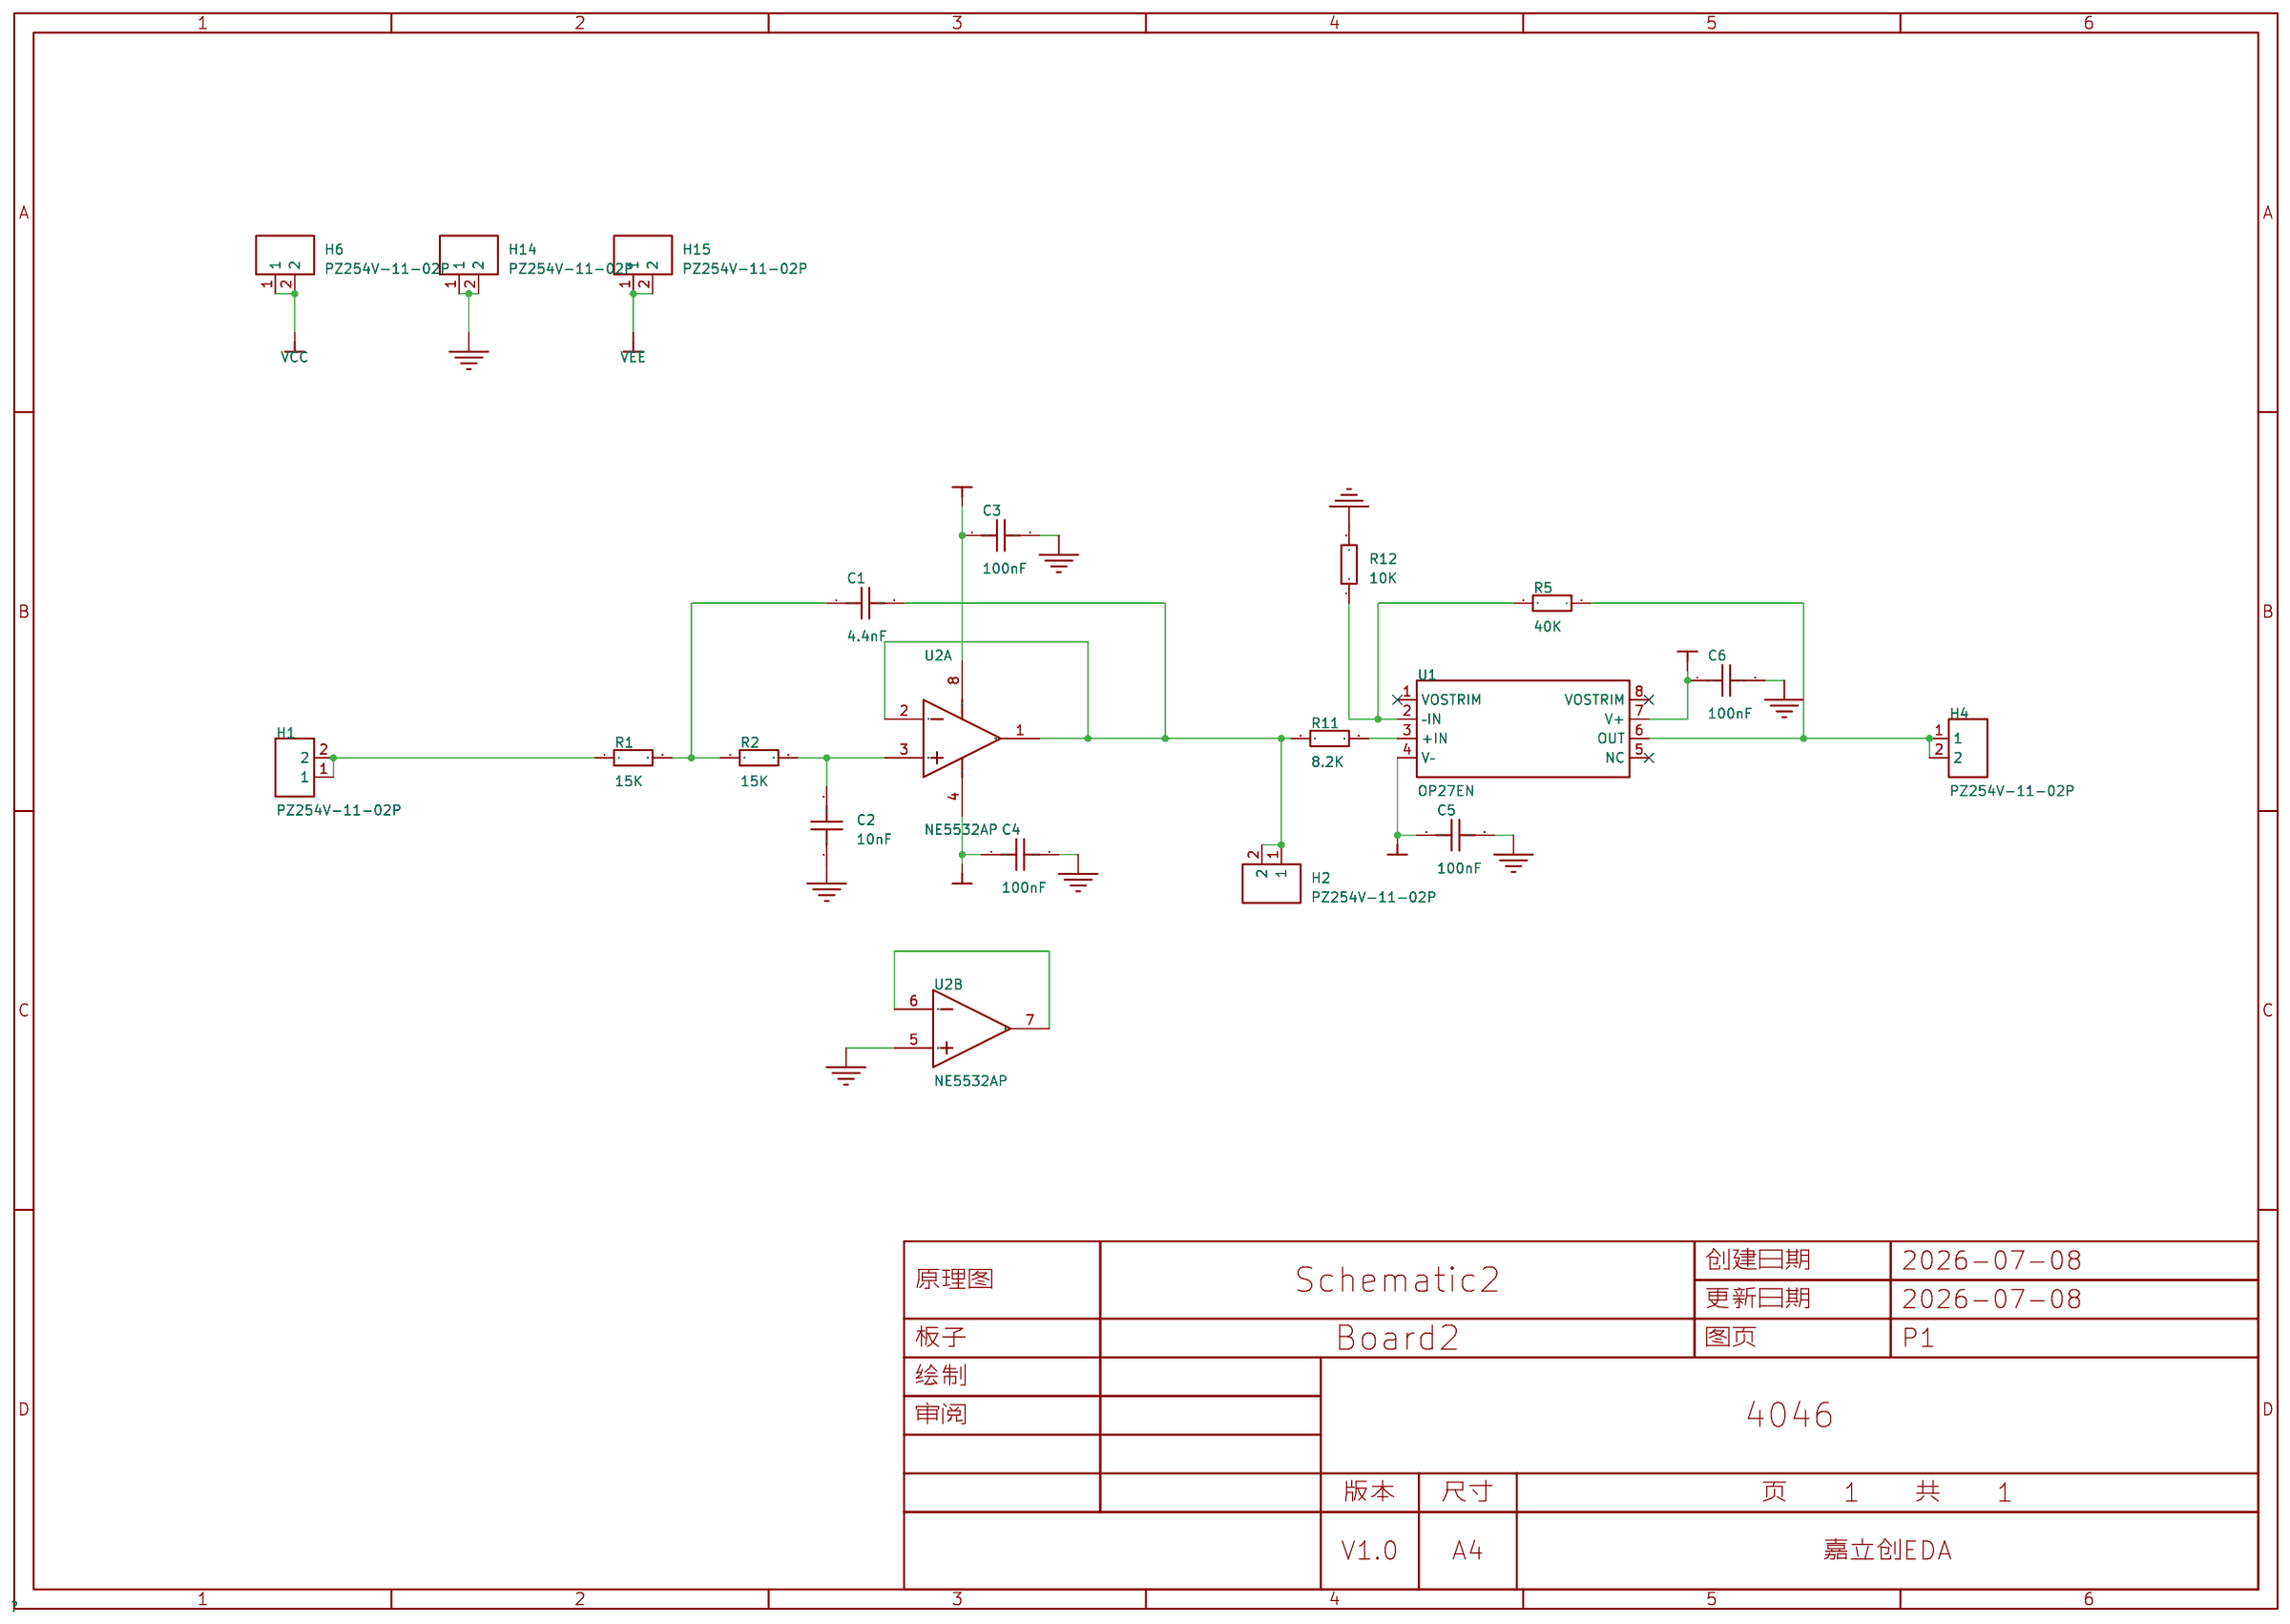
[diagram p5: schematic sheet]

## Parts
C1  4.4nF  [CAP-TH_BD5.3-P2.00-D0.5-FD]
C2  10nF  [CAP-TH_BD5.3-P2.00-D0.5-FD]
C3  100nF  [CAP-TH_BD5.3-P2.00-D0.5-FD]
C4  100nF  [CAP-TH_BD5.3-P2.00-D0.5-FD]
C5  100nF  [CAP-TH_BD5.3-P2.00-D0.5-FD]
C6  100nF  [CAP-TH_BD5.3-P2.00-D0.5-FD]
H1  PZ254V-11-02P  [HDR-TH_2P-P2.54-V-M]
H2  PZ254V-11-02P  [HDR-TH_2P-P2.54-V-M]
H4  PZ254V-11-02P  [HDR-TH_2P-P2.54-V-M]
H6  PZ254V-11-02P  [HDR-TH_2P-P2.54-V-M]
H14  PZ254V-11-02P  [HDR-TH_2P-P2.54-V-M]
H15  PZ254V-11-02P  [HDR-TH_2P-P2.54-V-M]
R1  15K  [RES-TH_BD2.2-L6.0-P10.00-D0.5]
R2  15K  [RES-TH_BD2.2-L6.0-P10.00-D0.5]
R5  40K  [RES-TH_BD2.2-L6.0-P10.00-D0.5]
R11  8.2K  [RES-TH_BD2.2-L6.0-P10.00-D0.5]
R12  10K  [RES-TH_BD2.2-L6.0-P10.00-D0.5]
U1  OP27EN  [PDIP-8_L9.3-W6.4-P2.54-LS7.6-BL]
U2  NE5532AP  [PDIP-8_L9.6-W6.4-P2.54-LS7.6-BL]  (sections 1,2)

## Library data of the parts
C1-C6 = CAP_0603: Supplier Footprint: 0603
H1 H2 H4 H6 H14 H15 = PZ254V-11-02P: 插针结构:1x2P;间距:2.54mm;行距:-;圆针/方针:方针;安装方式:直插;排数:单排;总PIN位数:2P;额定电流:3A;额定电压:250V;配合针长度:6mm;塑高:2.5mm;端接针长度:3mm;触头材质:黄铜;触头镀层:-;工作温度:-40℃~+105℃;颜色:黑色;; LCSC Part Name: 1x2P 间距:2.54mm 方针 直插; Supplier Part: C492401; Manufacturer: XFCN(兴飞); Supplier Footprint: 插件,P=2.54mm; JLCPCB Part Class: Extended Part; Datasheet: https://item.szlcsc.com/datasheet/PZ254V-11-02P/502957.html; Supplier: LCSC; Pin Structure: 1x2P; Pitch: 2.54mm; Circluar Pins/Square Pins: 方针; Mounting Type: 直插; Number of Rows: 单排; Number of Pins: 2P; Current Rating: 3A; Voltage Rating (Max): 250V; Length of Mating Pin: 6mm; Insulation Height: 2.5mm; Length of End Connection Pin: 3mm; Contact Material: 黄铜; Operating Temperature: -40℃~+105℃; Color: 黑色
R1 R2 R5 R11 R12 = Res_0603: Supplier Footprint: 0603
U1 = OP27EN: 增益带宽积(GBP):8MHz;输入偏置电流(Ib):28nA;输入失调电压(Vos):10uV;; LCSC Part Name: 低噪声高速精确运算放大器; Supplier Part: C47411535; Manufacturer: HGSEMI(华冠); Supplier Footprint: DIP-8; JLCPCB Part Class: Extended Part; Datasheet: https://item.szlcsc.com/datasheet/OP27EN/49633776.html; Supplier: LCSC; Gain Bandwidth Product: 8MHz; Ib - Input Bias Current: 28nA; Vos - Input Offset Voltage: 10uV; Common Mode Rejection Ratio(CMRR): 100dB; Input Offset Voltage Drift(Vos TC): 1.8uV/℃; Quiescent Current(Iq): 3.8mA; Dual Supply: -18V~-3V；3V~18V; Maximum Power Supply Range (Vdd-Vss): 36V; Noise density(eN): 3.5nV/√Hz@10Hz; Input Offset Current(Ios): 8nA; Operating Temperature: 0℃~+70℃
U2 = NE5532AP: NE5532A 适用于音频应用的双通道、30V、10MHz、低噪声 (6nV/√Hz) 运算放大器; Supplier Part: C353150; Manufacturer: TI(德州仪器); Supplier Footprint: PDIP-8; JLCPCB Part Class: Extended Part; Datasheet: https://www.ti.com/cn/lit/gpn/sa5532a; Supplier: LCSC

## Nets
GND: C2.1 C3.2 C4.2 C5.2 C6.2 H14.1 H14.2 R12.2 U2.5(IN B+)
VCC: C3.1 C6.1 H6.1 H6.2 U1.7(V+) U2.8(V+)
VEE: C4.1 C5.1 H15.1 H15.2 U1.4(V–) U2.4(V-)
$1N8: C1.1 R1.2 R2.1
$1N9: C2.2 R2.2 U2.3(IN A+)
$1N13: C1.2 H2.1 H2.2 R11.1 U2.1(OUT A) U2.2(IN A-)
$1N15: R11.2 U1.3(+IN)
$1N16: R5.2 R12.1 U1.2(–IN)
$1N35: U2.6(IN B-) U2.7(OUT B)
Net-(H1-1): H1.1 H1.2 R1.1
Net-(H4-1): H4.1 H4.2 R5.1 U1.6(OUT)

Not connected (* = marked no-connect by the designer): U1 1(VOSTRIM)* 5(NC)* 8(VOSTRIM)*

# Board PCB6
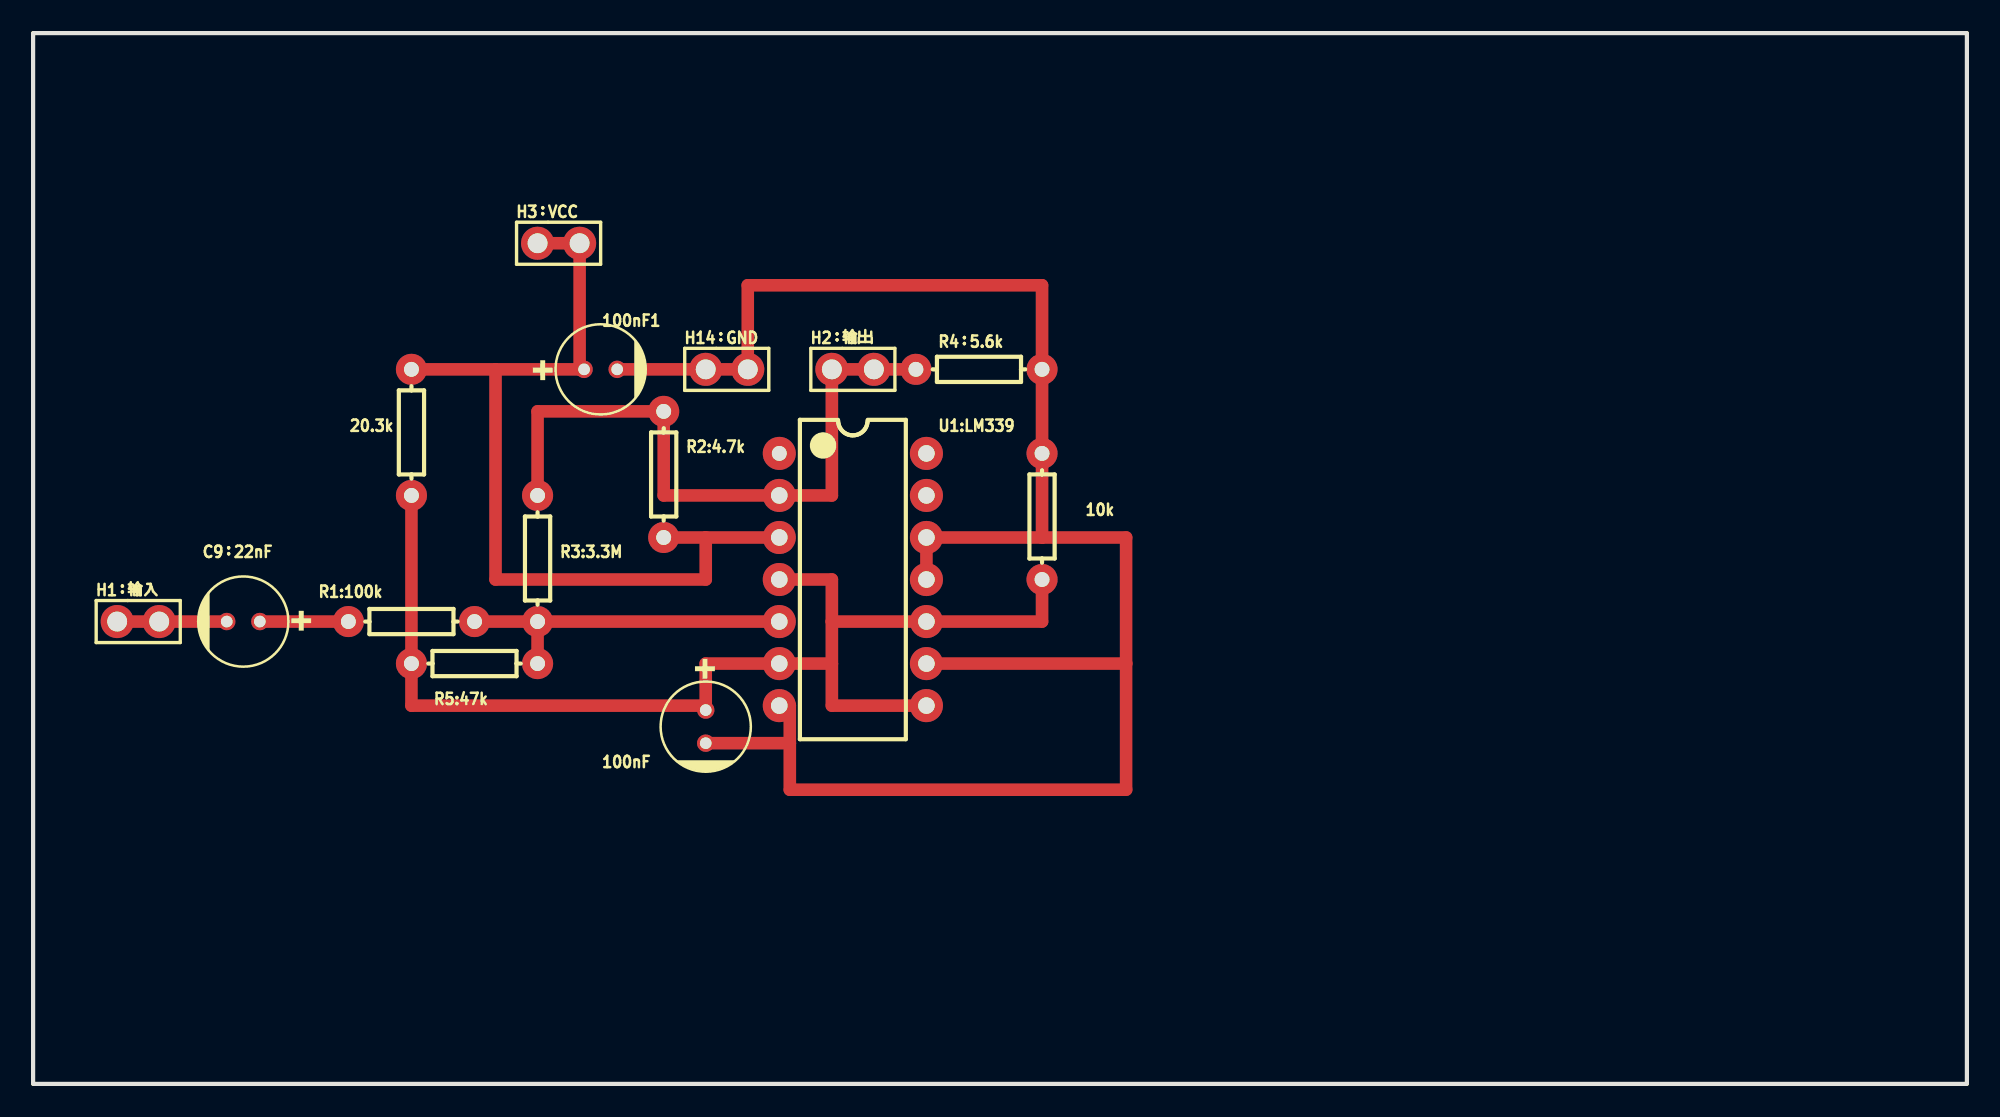
[diagram p6: board, top side]
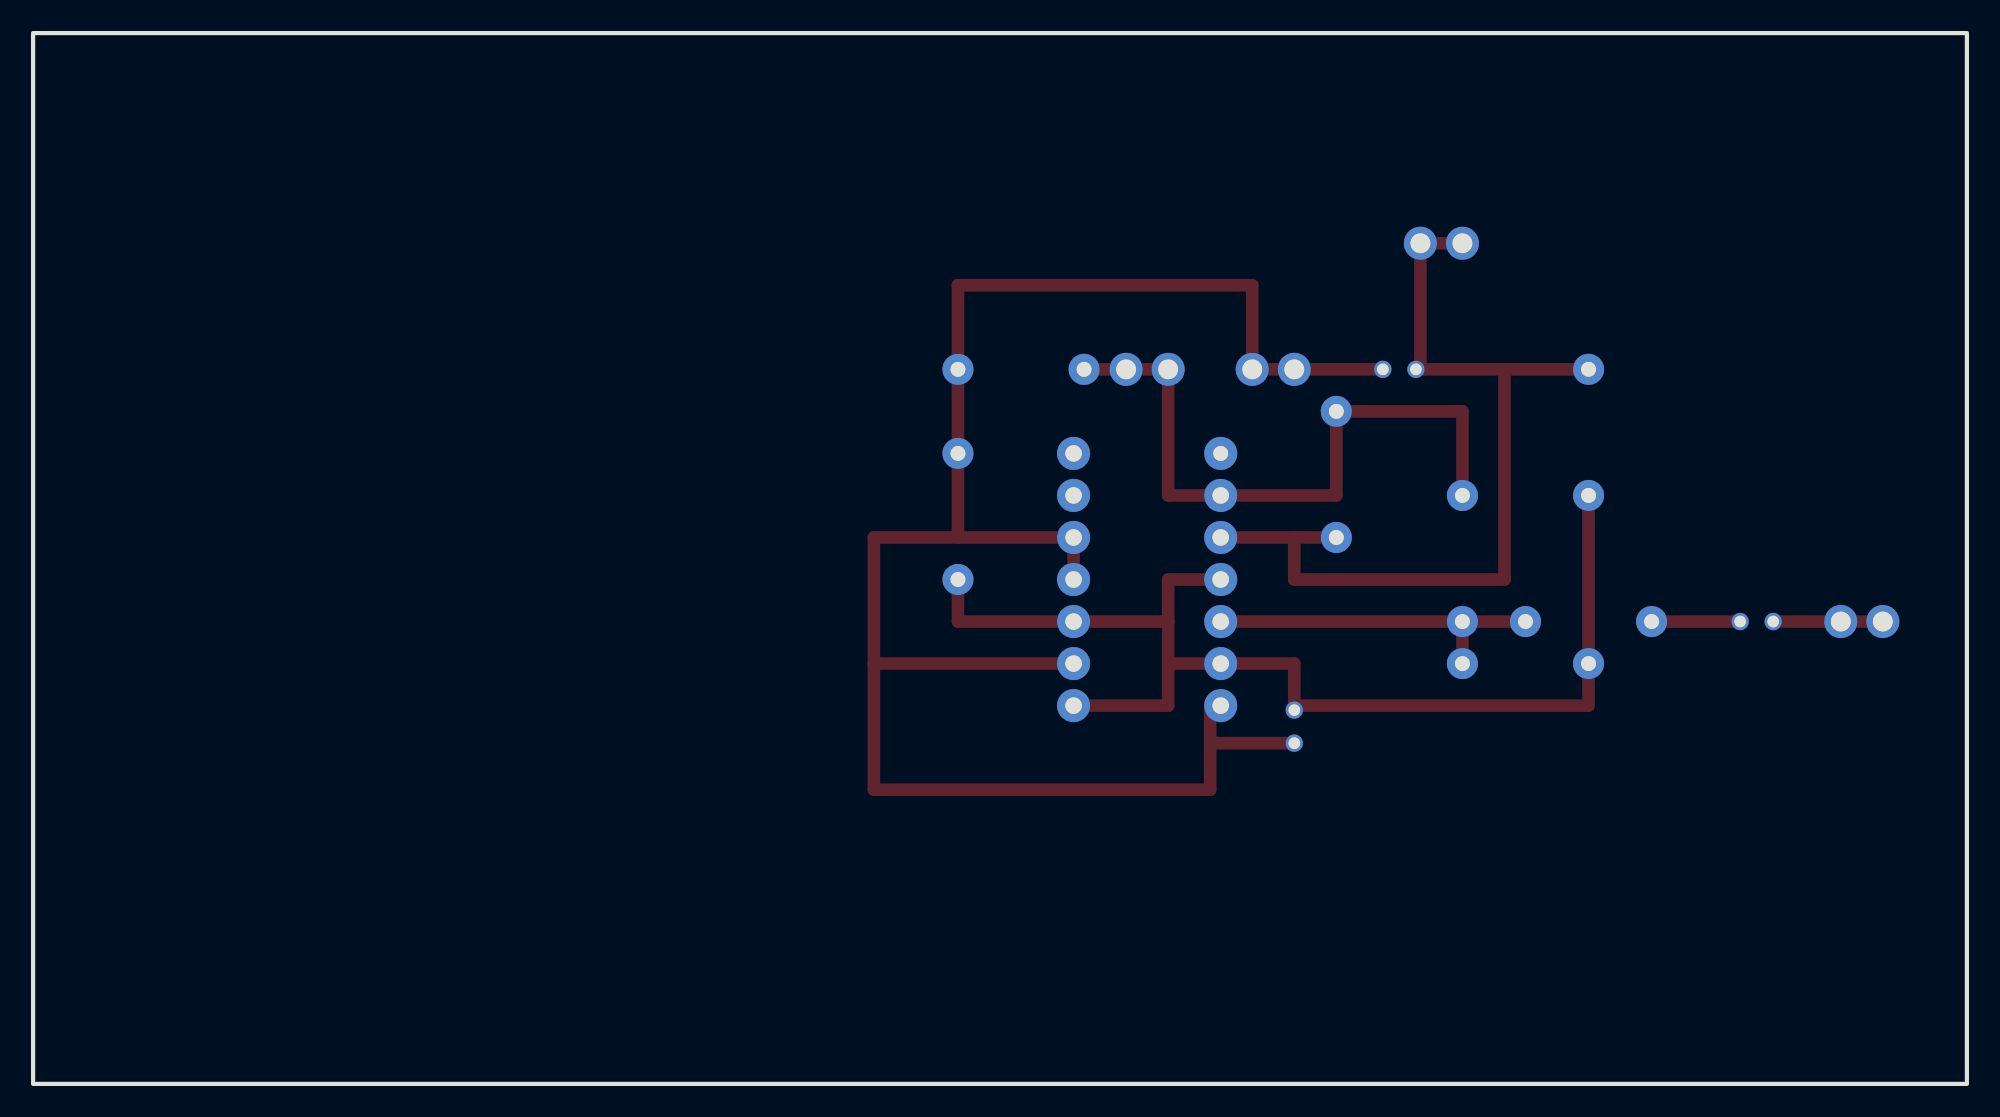
[diagram p7: board, bottom side, seen from below]

Outline 116.84 x 63.5 mm; copper layers: Top Layer, Bottom Layer. Coordinates in mm from the lower left corner of the outline.
Outline path: rectangle 0,63.5 116.84,0
Stack: Top Layer 0.035mm / Dielectric1 1.51mm FR4 er 4.5 / Bottom Layer 0.035mm

## Design rules (mm)
spacing copperThickness1oz (default): track to track 0.102, other pairs 0.152 to 0.3
spacing copperThickness2oz: track to track 0.203, other pairs 0.152 to 0.3
track width copperThickness1oz (default): min 0.127, default 0.254, max 2.54
track width copperThickness2oz: min 0.203, default 0.254, max 2.54
differential pair differentialPair (default): width min 0.127, default 0.254, max 2.54; gap min 0.152, default 0.152

## Placement (name value [footprint] x y rotation side)
10k  20.3k  [R_AXIAL-0.3]  60.96 34.29 90 top
20.3k  20.3k  [R_AXIAL-0.3]  22.86 39.37 270 top
100nF  22nF  [CAP-TH_BD5.3-P2.00-D0.5-FD]  40.64 21.59 270 top
100nF1  22nF  [CAP-TH_BD5.3-P2.00-D0.5-FD]  34.29 43.18 0 top
C9：22nF  22nF  [CAP-TH_BD5.3-P2.00-D0.5-FD]  12.7 27.94 180 top
H1：输入  PZ254V-11-02P  [HDR-TH_2P-P2.54-V-M]  6.35 27.94 0 top
H2：输出  PZ254V-11-02P  [HDR-TH_2P-P2.54-V-M]  49.53 43.18 0 top
H3：VCC  PZ254V-11-02P  [HDR-TH_2P-P2.54-V-M]  31.75 50.8 0 top
H14：GND  PZ254V-11-02P  [HDR-TH_2P-P2.54-V-M]  41.91 43.18 0 top
R1:100k  100k  [R_AXIAL-0.3]  22.86 27.94 0 top
R2:4.7k  4.7K  [R_AXIAL-0.3]  38.1 36.83 270 top
R3:3.3M  3.3M  [R_AXIAL-0.3]  30.48 31.75 90 top
R4：5.6k  5.6k  [R_AXIAL-0.3]  57.15 43.18 180 top
R5:47k  47k  [R_AXIAL-0.3]  26.67 25.4 0 top
U1:LM339  LM339N  [PDIP-14_L19.3-W6.4-P2.54-LS9.0-BL]  49.53 30.48 270 top

## Footprints (pads in the part's own frame, mm; a bottom-side part is the same pattern mirrored in y, then rotated)
CAP-TH_BD5.3-P2.00-D0.5-FD
  round 1.052 hole 0.701: 1(-1,0) 2(1,0)
HDR-TH_2P-P2.54-V-M
  round 2 hole 1.2: 1(-1.27,0) 2(1.27,0)
PDIP-14_L19.3-W6.4-P2.54-LS9.0-BL
  round 2 hole 0.9: 1(-7.62,-4.445)
  round 2 hole 1: 2(-5.08,-4.445) 3(-2.54,-4.445) 4(0,-4.445) 5(2.54,-4.445) 6(5.08,-4.445) 7(7.62,-4.445) 8(7.62,4.445) 9(5.08,4.445) 10(2.54,4.445) 11(0,4.445) 12(-2.54,4.445) 13(-5.08,4.445) 14(-7.62,4.445)
R_AXIAL-0.3
  round 1.879 hole 0.899: 1(-3.81,0) 2(3.81,0)

## Nets
GND: 10k.2 100nF.2 100nF1.2 H14：GND.1 H14：GND.2 R4：5.6k.1 U1:LM339.7 U1:LM339.9 U1:LM339.11 U1:LM339.12
VCC: 20.3k.1 100nF1.1 H3：VCC.1 H3：VCC.2 R2:4.7k.2 U1:LM339.3
Vref: 10k.1 20.3k.2 100nF.1 R5:47k.1 U1:LM339.4 U1:LM339.6 U1:LM339.8 U1:LM339.10
$1N1: C9：22nF.2 H1：输入.1 H1：输入.2
$1N23: H2：输出.1 H2：输出.2 R2:4.7k.1 R3:3.3M.2 R4：5.6k.2 U1:LM339.2
$1N24: C9：22nF.1 R1:100k.1
$1N30: R1:100k.2 R3:3.3M.1 R5:47k.2 U1:LM339.5

Pads without a net: U1:LM339 1 13 14

## Routing (per net, layer and track width the routed paths; a pad name or vN(x,y) marks a point on that pad's centre or on a via; arc(x,y) is an arc through that point)
GND: length 119
  Top Layer w0.762: 100nF.2 45.72,20.59 ; 45.72,20.59 45.72,17.78 66.04,17.78 66.04,25.4 ; 45.72,20.59 45.72,22.86 U1:LM339.7 ; 60.96,33.02 U1:LM339.12 U1:LM339.11 ; 60.96,33.02 66.04,33.02 66.04,25.4 ; 60.96,33.02 10k.2 R4：5.6k.1 60.96,48.26 43.18,48.26 H14：GND.2 H14：GND.1 100nF1.2 ; 66.04,25.4 U1:LM339.9
VCC: length 55.5
  Top Layer w0.762: 27.94,43.18 20.3k.1 ; 27.94,43.18 27.94,30.48 40.64,30.48 40.64,33.02 ; 27.94,43.18 33.02,43.18 ; H3：VCC.1 H3：VCC.2 33.02,43.18 ; 33.02,43.18 100nF1.1 ; 40.64,33.02 U1:LM339.3 ; 40.64,33.02 R2:4.7k.2
VREF: length 25.4
  Top Layer w0.762: 48.26,22.86 53.97,22.86 ; 60.96,27.94 53.97,27.94 ; 22.86,35.56 22.86,25.4 ; 48.26,30.48 48.26,27.94
Vref: length 47
  Top Layer w0.762: 48.26,25.4 48.26,22.86 ; 48.26,25.4 48.26,27.94 U1:LM339.10 ; 48.26,25.4 U1:LM339.6 40.64,25.4 40.64,22.86 22.86,22.86 R5:47k.1 ; U1:LM339.4 48.26,30.48 ; 10k.1 60.96,27.94
$1N1: length 6.6
  Top Layer w0.762: C9：22nF.2 H1：输入.2 H1：输入.1
$1N23: length 40.6
  Top Layer w0.762: R4：5.6k.2 H2：输出.2 H2：输出.1 48.26,35.56 U1:LM339.2 38.1,35.56 R2:4.7k.1 30.48,40.64 R3:3.3M.2
$1N24: length 5.3
  Top Layer w0.762: C9：22nF.1 R1:100k.1
$1N30: length 21
  Top Layer w0.762: R3:3.3M.1 R5:47k.2 ; R3:3.3M.1 R1:100k.2 ; R3:3.3M.1 U1:LM339.5

# Board PCB5
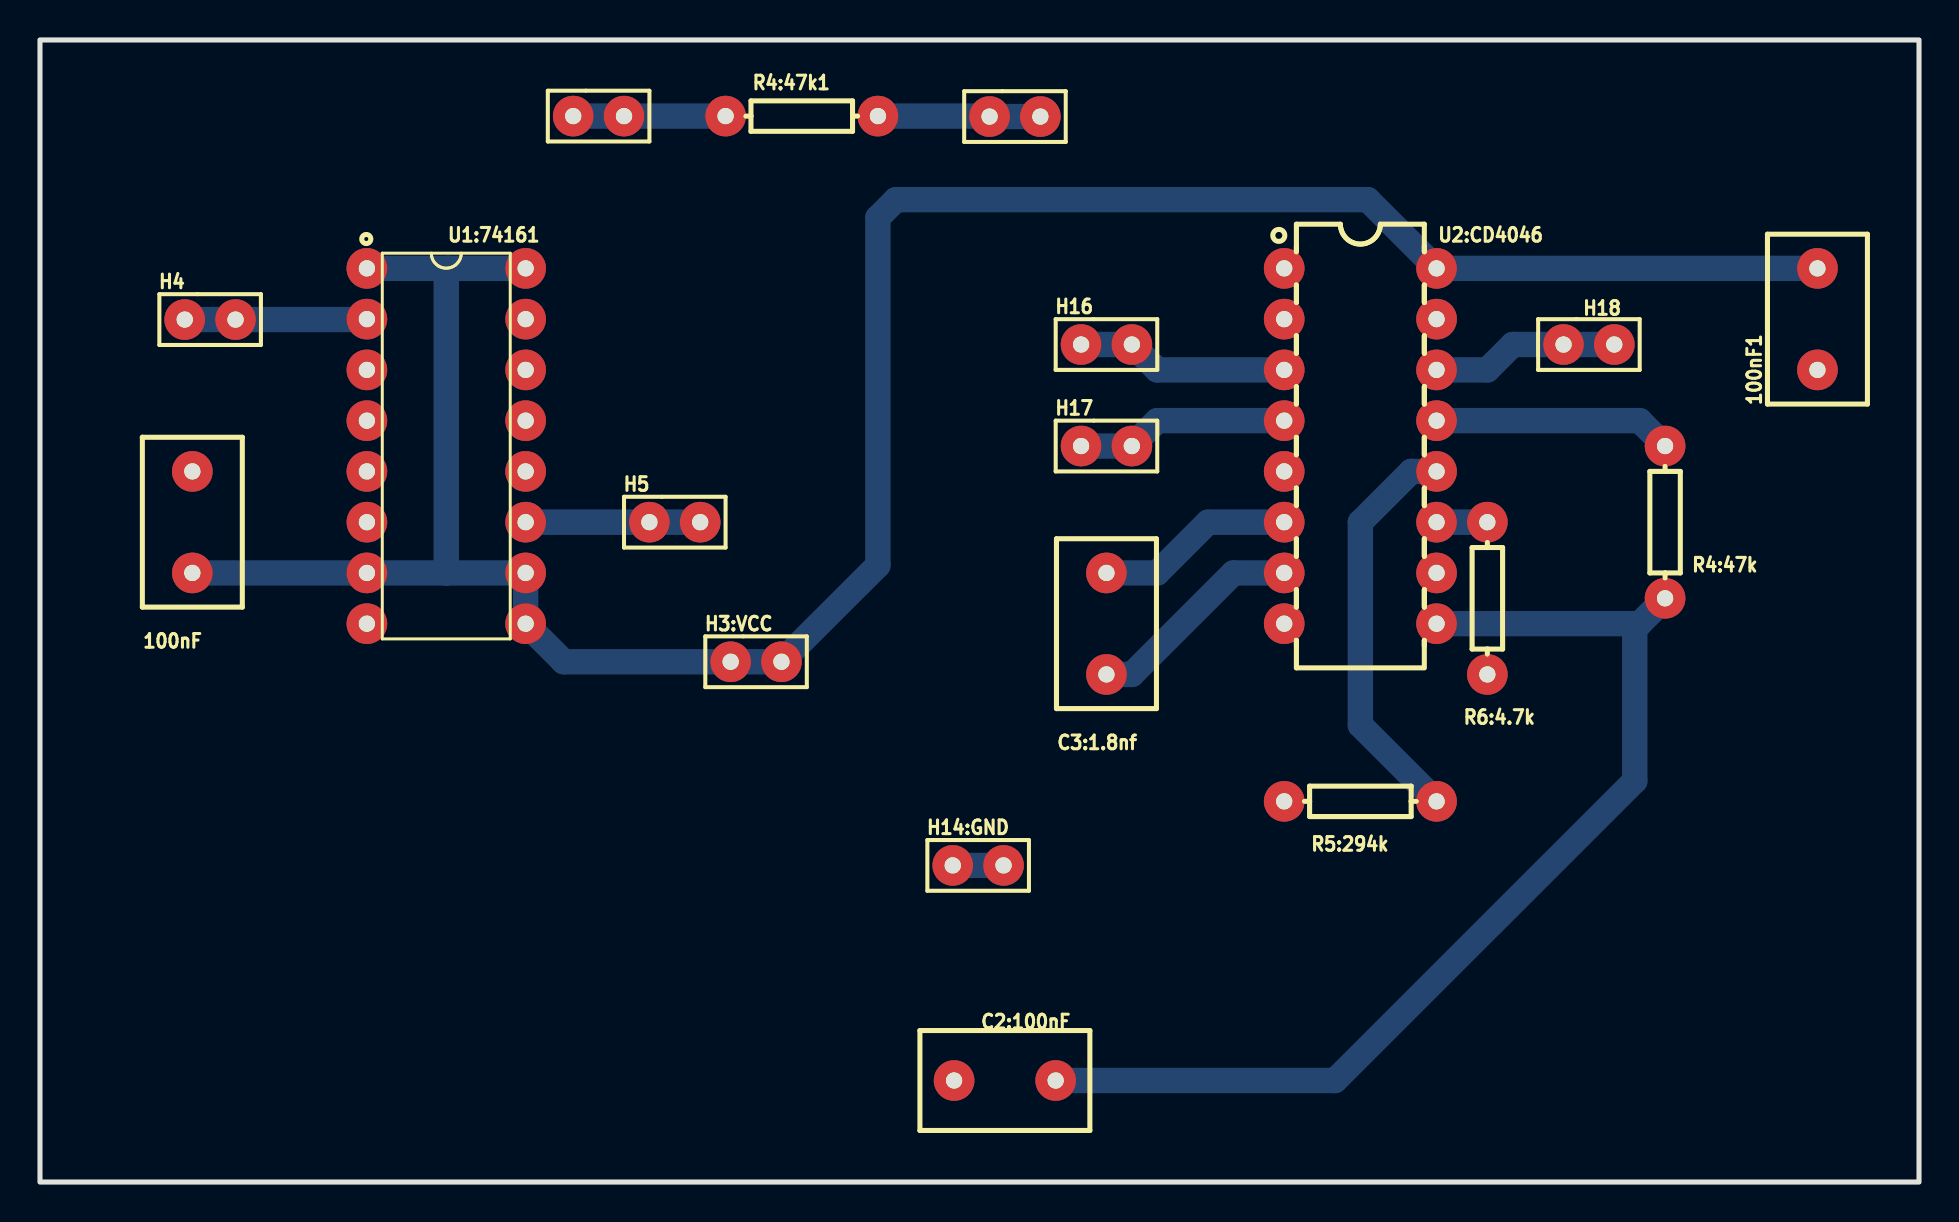
[diagram p8: board, top side]
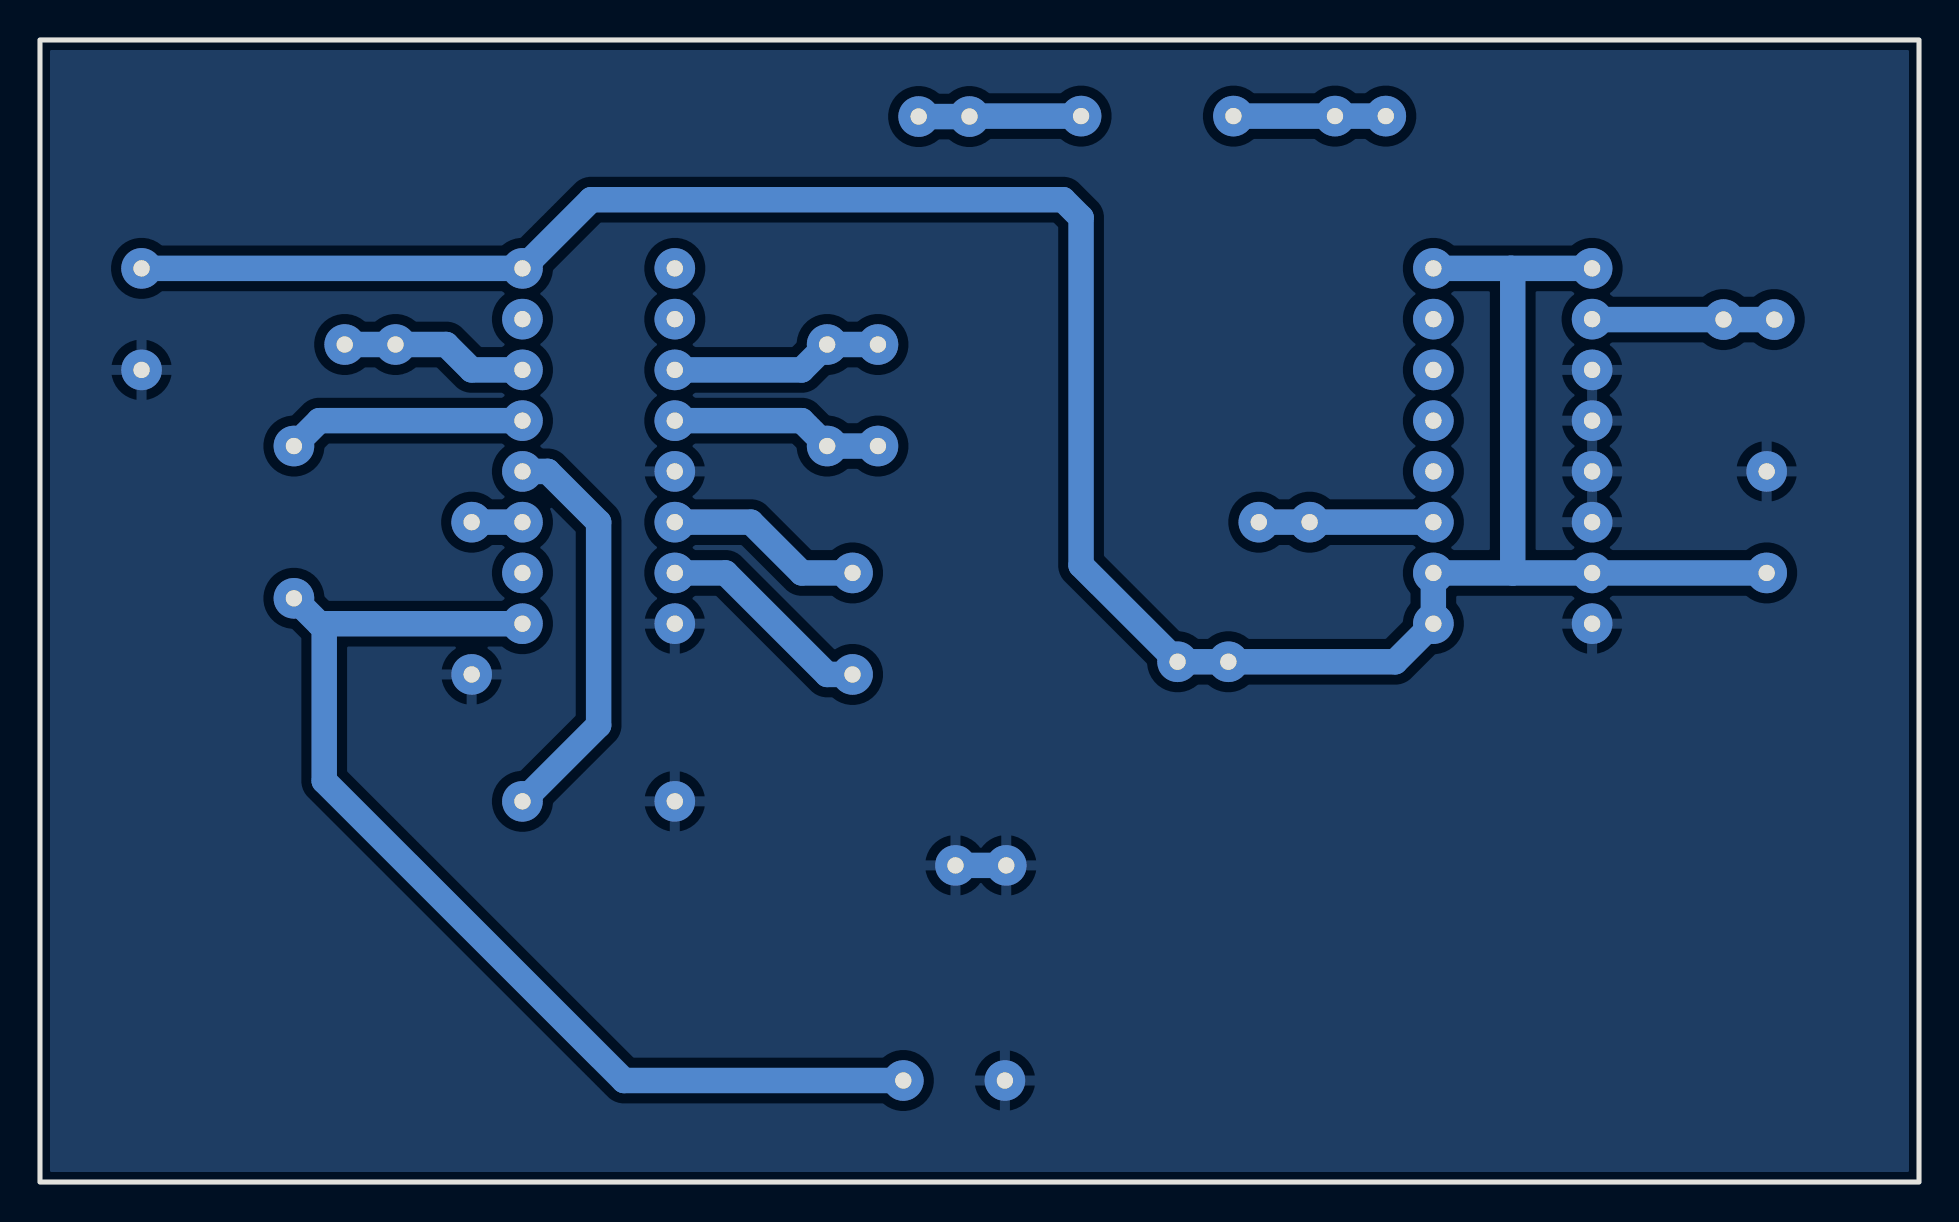
[diagram p9: board, bottom side, seen from below]

Outline 93.98 x 57.15 mm; copper layers: Top Layer, Bottom Layer. Coordinates in mm from the lower left corner of the outline.
Outline path: rectangle 0,57.15 93.98,0
Stack: Top Layer 0.035mm / Dielectric1 1.51mm FR4 er 4.5 / Bottom Layer 0.035mm

## Design rules (mm)
spacing copperThickness1oz (default): track to track 0.508, other pairs 0.508 to 0.508
spacing copperThickness2oz: track to track 0.203, other pairs 0.152 to 0.3
track width copperThickness1oz (default): min 0.127, default 0.254, max 2.54
track width copperThickness2oz: min 0.203, default 0.254, max 2.54
differential pair differentialPair (default): width min 0.127, default 0.254, max 2.54; gap min 0.152, default 0.152
net GND uses copperRegion

## Placement (name value [footprint] x y rotation side)
100nF  100nF  [CAP-TH_L8.5-W5.0-P5.00-D1.2]  7.62 33.02 90 top
100nF1  100nF  [CAP-TH_L8.5-W5.0-P5.00-D1.2]  88.9 43.18 90 top
C2:100nF  100nF  [CAP-TH_L8.5-W5.0-P5.00-D1.2]  48.26 5.08 0 top
C3:1.8nf  1.8n  [CAP-TH_L8.5-W5.0-P5.00-D1.2]  53.34 27.94 90 top
H3:VCC  PZ254V-11-02P  [HDR-TH_2P-P2.54-V-M]  35.81 26.03 0 top
H4  PZ254V-11-02P  [HDR-TH_2P-P2.54-V-M]  8.51 43.16 0 top
H5  PZ254V-11-02P  [HDR-TH_2P-P2.54-V-M]  31.75 33.02 0 top
H14:GND  PZ254V-11-02P  [HDR-TH_2P-P2.54-V-M]  46.92 15.84 0 top
H14:GND2  PZ254V-11-02P  [HDR-TH_2P-P2.54-V-M]  48.76 53.32 0 top
H16  PZ254V-11-02P  [HDR-TH_2P-P2.54-V-M]  53.34 41.91 0 top
H17  PZ254V-11-02P  [HDR-TH_2P-P2.54-V-M]  53.34 36.83 0 top
H18  PZ254V-11-02P  [HDR-TH_2P-P2.54-V-M]  77.47 41.91 0 top
NOREF  -  [HDR-TH_2P-P2.54-V-M]  27.94 53.34 0 top
R4:47k  47kΩ  [R_AXIAL-0.3]  81.28 33.02 90 top
R4:47k1  47kΩ  [R_AXIAL-0.3]  38.1 53.34 0 top
R5:294k  294k  [R_AXIAL-0.3]  66.04 19.05 180 top
R6:4.7k  6.04kΩ  [R_AXIAL-0.3]  72.39 29.21 270 top
U1:74161  SN74HC161N(XBLW)  [PDIP-16_L19.3-W6.4-P2.54-LS7.9-BL]  20.32 36.83 270 top
U2:CD4046  CD74HC4046AE  [PDIP-16_L22.1-W6.3-P2.54-LS7.6-BL]  66.04 36.83 270 top

## Footprints (pads in the part's own frame, mm; a bottom-side part is the same pattern mirrored in y, then rotated)
CAP-TH_L8.5-W5.0-P5.00-D1.2
  round 2.032 hole 0.813: 1(-2.54,0) 2(2.54,0)
HDR-TH_2P-P2.54-V-M
  round 2.032 hole 0.813: 1(-1.27,0) 2(1.27,0)
PDIP-16_L19.3-W6.4-P2.54-LS7.9-BL
  round 2.032 hole 0.813: 1(-8.89,-3.97) 2(-6.35,-3.97) 3(-3.81,-3.97) 4(-1.27,-3.97) 5(1.27,-3.97) 6(3.81,-3.97) 7(6.35,-3.97) 8(8.89,-3.97) 9(8.89,3.97) 10(6.35,3.97) 11(3.81,3.97) 12(1.27,3.97) 13(-1.27,3.97) 14(-3.81,3.97) 15(-6.35,3.97) 16(-8.89,3.97)
PDIP-16_L22.1-W6.3-P2.54-LS7.6-BL
  round 2.032 hole 0.813: 1(-8.89,-3.81) 2(-6.35,-3.81) 3(-3.81,-3.81) 4(-1.27,-3.81) 5(1.27,-3.81) 6(3.81,-3.81) 7(6.35,-3.81) 8(8.89,-3.81) 9(8.89,3.81) 10(6.35,3.81) 11(3.81,3.81) 12(1.27,3.81) 13(-1.27,3.81) 14(-3.81,3.81) 15(-6.35,3.81) 16(-8.89,3.81)
R_AXIAL-0.3
  round 2.032 hole 0.813: 1(-3.81,0) 2(3.81,0)

## Nets
As in the schematic, except:
GND: 100nF.2 100nF1.1 C2:100nF.1 H14:GND.1 H14:GND.2 R5:294k.2 R6:4.7k.2 U1:74161.3 U1:74161.4 U1:74161.5 U1:74161.6 U1:74161.8 U2:CD4046.5 U2:CD4046.8
$1N4: R6:4.7k.1 U2:CD4046.11
$1N26: NOREF.1 NOREF.2 R4:47k1.1

Pads without a net: U1:74161 12 13 14 15; U2:CD4046 1 2 10 15

## Routing (per net, layer and track width the routed paths; a pad name or vN(x,y) marks a point on that pad's centre or on a via; arc(x,y) is an arc through that point)
GND: length 2.5
  Bottom Layer w1.27: H14:GND.1 H14:GND.2
VCC: length 129
  Bottom Layer w1.27: 100nF1.2 U2:CD4046.16 66.41,49.16 42.81,49.16 41.91,48.26 41.91,30.86 H3:VCC.2 H3:VCC.1 26.19,26.03 U1:74161.9 U1:74161.10 20.32,30.48 ; 20.4,45.72 20.32,45.64 20.32,30.48 ; 20.4,45.72 U1:74161.16 ; 20.4,45.72 U1:74161.1 ; 20.32,30.48 U1:74161.7 100nF.1
$1N3: length 9.4
  Bottom Layer w1.27: H18.2 H18.1 73.66,41.91 72.39,40.64 U2:CD4046.14
$1N4: length 2.5
  Bottom Layer w1.27: U2:CD4046.11 R6:4.7k.1
$1N6: length 20.4
  Bottom Layer w1.27: U2:CD4046.12 68.58,35.56 66.04,33.02 66.04,22.86 R5:294k.1
$1N8: length 11
  Bottom Layer w1.27: U2:CD4046.7 59.69,30.48 54.61,25.4 C3:1.8nf.1
$1N9: length 9.9
  Bottom Layer w1.27: U2:CD4046.6 58.42,33.02 55.88,30.48 C3:1.8nf.2
$1N10: length 12
  Bottom Layer w1.27: R4:47k.2 80.01,38.1 U2:CD4046.13
$1N11: length 55
  Bottom Layer w1.27: C2:100nF.2 64.77,5.08 79.76,20.07 79.76,27.94 ; 79.76,27.94 80.01,27.94 R4:47k.1 ; 79.76,27.94 U2:CD4046.9
$1N13: length 10.7
  Bottom Layer w1.27: U2:CD4046.3 55.88,40.64 H16.2 H16.1
$1N14: length 10.7
  Bottom Layer w1.27: H17.1 H17.2 55.88,38.1 U2:CD4046.4
$1N15: length 8.7
  Bottom Layer w1.27: U1:74161.11 H5.1 H5.2
$1N16: length 9.1
  Bottom Layer w1.27: H4.1 H4.2 16.33,43.16 U1:74161.2
$1N26: length 7.6
  Bottom Layer w1.27: NOREF.1 NOREF.2 R4:47k1.1
$1N28: length 8.1
  Bottom Layer w1.27: H14:GND2.2 H14:GND2.1 47.47,53.34 R4:47k1.2

## Copper pours and planes (outline as drawn; the poured copper is in the pictures)
GND on Bottom Layer: 0,57.15 93.98,57.15 93.98,0 0,0
GND on Bottom Layer: 0,57.15 93.98,57.15 93.98,0 0,0

# Board PCB4
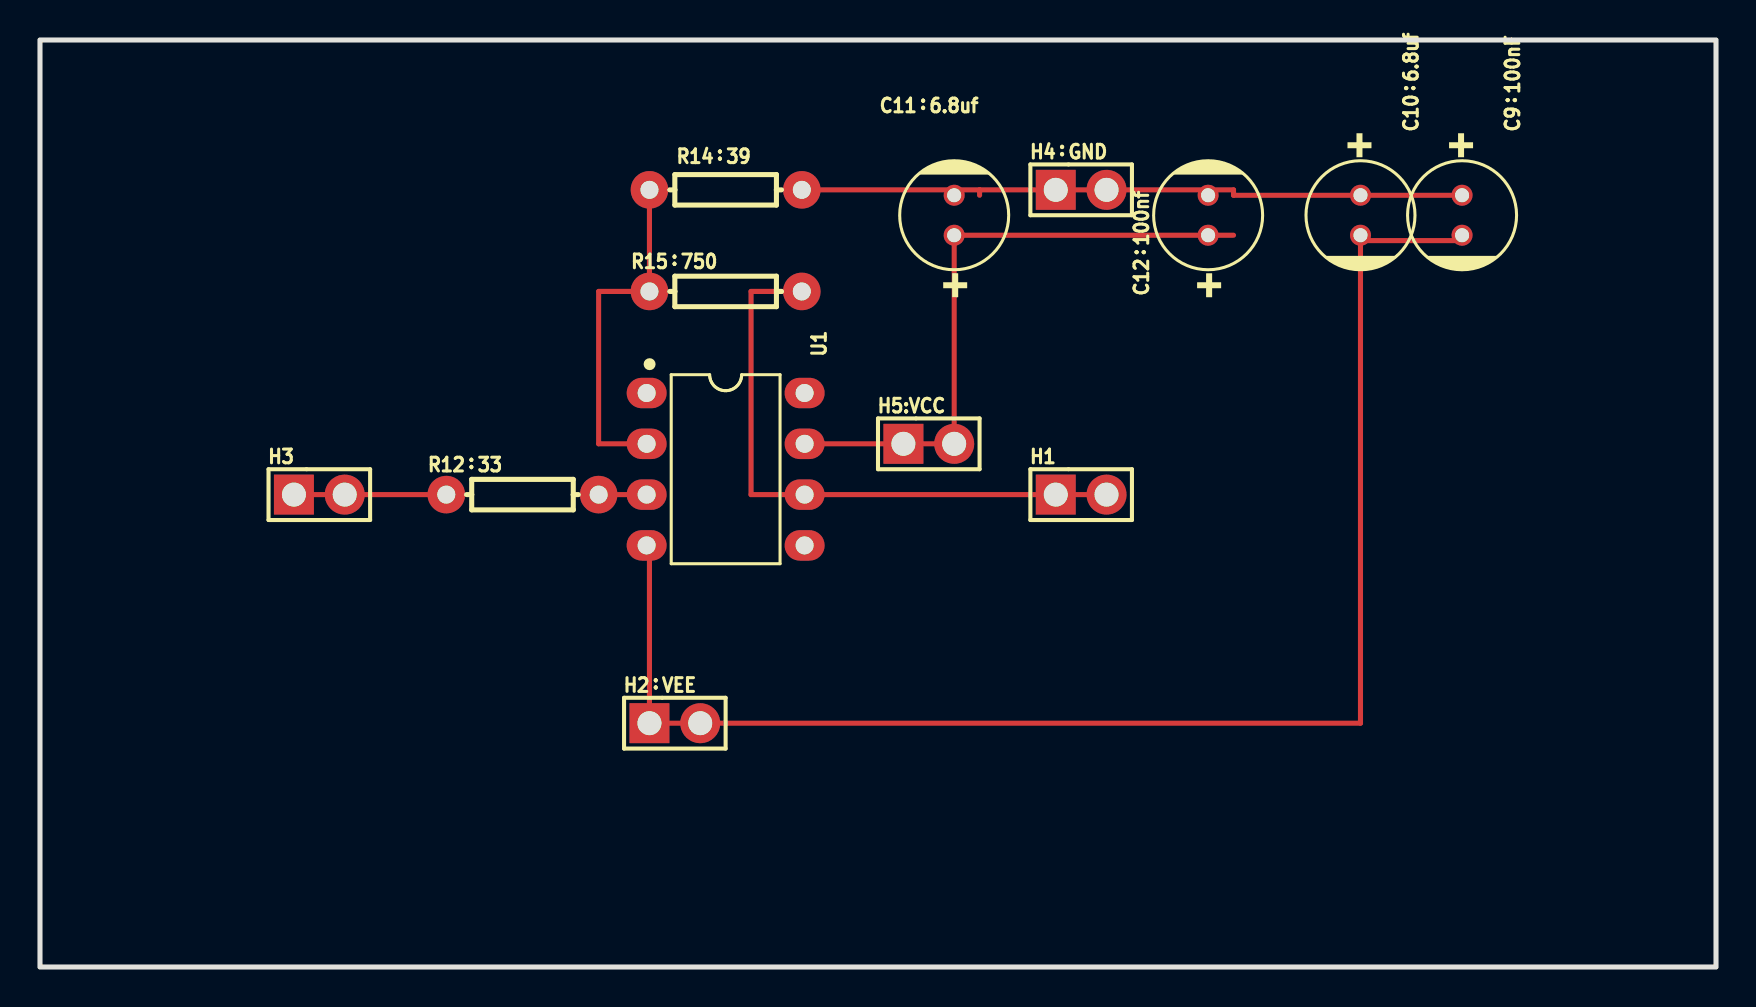
[diagram p10: board, top side]
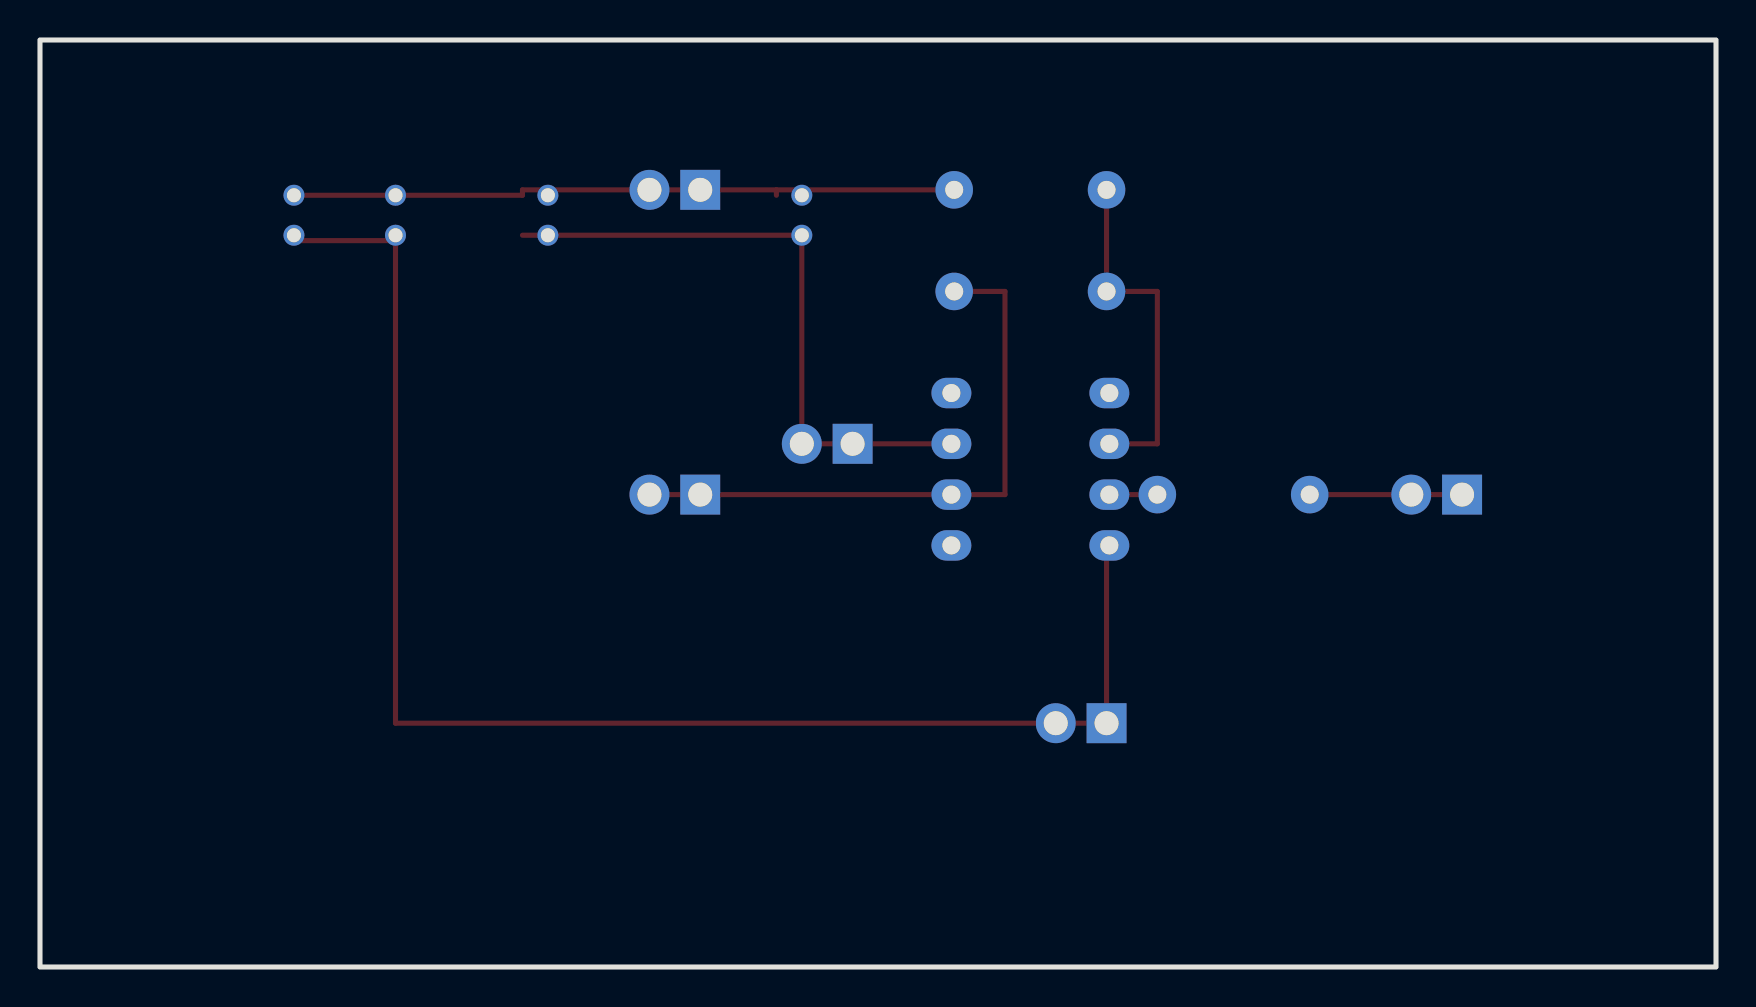
[diagram p11: board, bottom side, seen from below]

Outline 83.82 x 46.36 mm; copper layers: Top Layer, Bottom Layer. Coordinates in mm from the lower left corner of the outline.
Outline path: rectangle 0,46.36 83.82,0
Stack: Top Layer 0.035mm / Dielectric1 1.51mm FR4 er 4.5 / Bottom Layer 0.035mm

## Design rules (mm)
spacing copperThickness1oz (default): track to track 0.102, other pairs 0.152 to 0.3
spacing copperThickness2oz: track to track 0.203, other pairs 0.152 to 0.3
track width copperThickness1oz (default): min 0.127, default 0.254, max 2.54
track width copperThickness2oz: min 0.203, default 0.254, max 2.54
differential pair differentialPair (default): width min 0.127, default 0.254, max 2.54; gap min 0.152, default 0.152

## Placement (name value [footprint] x y rotation side)
C9：100nF  100nF  [CAP-TH_BD5.3-P2.00-D0.5-FD]  71.12 37.59 270 top
C10：6.8uf  6.8uf  [CAP-TH_BD5.3-P2.00-D0.5-FD]  66.04 37.59 270 top
C11：6.8uf  6.8uF  [CAP-TH_BD5.3-P2.00-D0.5-FD]  45.72 37.59 90 top
C12：100nf  100nF  [CAP-TH_BD5.3-P2.00-D0.5-FD]  58.42 37.59 90 top
H1  PZ254V-11-02P  [HDR-TH_2P-P2.54-V-M]  52.07 23.62 0 top
H2：VEE  PZ254V-11-02P  [HDR-TH_2P-P2.54-V-M]  31.75 12.19 0 top
H3  PZ254V-11-02P  [HDR-TH_2P-P2.54-V-M]  13.97 23.62 0 top
H4：GND  PZ254V-11-02P  [HDR-TH_2P-P2.54-V-M]  52.07 38.86 0 top
H5:VCC  PZ254V-11-02P  [HDR-TH_2P-P2.54-V-M]  44.45 26.16 0 top
R12：33  33  [R_AXIAL-0.3]  24.13 23.62 0 top
R14：39  39  [R_AXIAL-0.3]  34.29 38.86 180 top
R15：750  750  [R_AXIAL-0.3]  34.29 33.78 0 top
U1  AD811ANZ  [PDIP-8_L9.3-W6.4-P2.54-LS7.9-BL-1]  34.29 24.89 270 top

## Footprints (pads in the part's own frame, mm; a bottom-side part is the same pattern mirrored in y, then rotated)
CAP-TH_BD5.3-P2.00-D0.5-FD
  round 1.052 hole 0.701: 1(-1,0) 2(1,0)
HDR-TH_2P-P2.54-V-M
  rect 2x2 hole 1.2: 1(-1.27,0)
  round 2 hole 1.2: 2(1.27,0)
PDIP-8_L9.3-W6.4-P2.54-LS7.9-BL-1
  oval 1.524x2 hole 0.9: 1(-3.81,-3.95) 2(-1.27,-3.95) 3(1.27,-3.95) 4(3.81,-3.95) 5(3.81,3.95) 6(1.27,3.95) 7(-1.27,3.95) 8(-3.81,3.95)
R_AXIAL-0.3
  round 1.879 hole 0.899: 1(-3.81,0) 2(3.81,0)

## Nets
As in the schematic.

Pads without a net: U1 1 5 8

## Routing (per net, layer and track width the routed paths; a pad name or vN(x,y) marks a point on that pad's centre or on a via; arc(x,y) is an arc through that point)
GND: length 33.6
  Top Layer w0.254: 46.99,38.86 H4：GND.1 H4：GND.2 59.69,38.86 59.69,38.59 C10：6.8uf.1 C9：100nF.1 ; 46.99,38.86 46.99,38.59 ; 46.99,38.86 R14：39.1
VCC: length 31.9
  Top Layer w0.254: U1.7 H5:VCC.1 H5:VCC.2 C11：6.8uf.1 C12：100nf.1 59.69,36.59
VEE: length 74.1
  Top Layer w0.254: 66.04,36.32 71.12,36.32 ; 66.04,36.32 66.04,12.19 H2：VEE.2 H2：VEE.1 30.48,21.08 U1.4 ; 66.04,36.32 C10：6.8uf.2
$1N1: length 30.5
  Top Layer w0.254: R15：750.2 35.56,33.78 35.56,23.62 U1.6 H1.1 H1.2
$1N3: length 17.6
  Top Layer w0.254: U1.2 27.94,26.16 27.94,33.78 R15：750.1 R14：39.2
$1N6: length 7.6
  Top Layer w0.254: R12：33.1 H3.2 H3.1
$1N15: length 2.4
  Top Layer w0.254: R12：33.2 U1.3

# Board PCB1
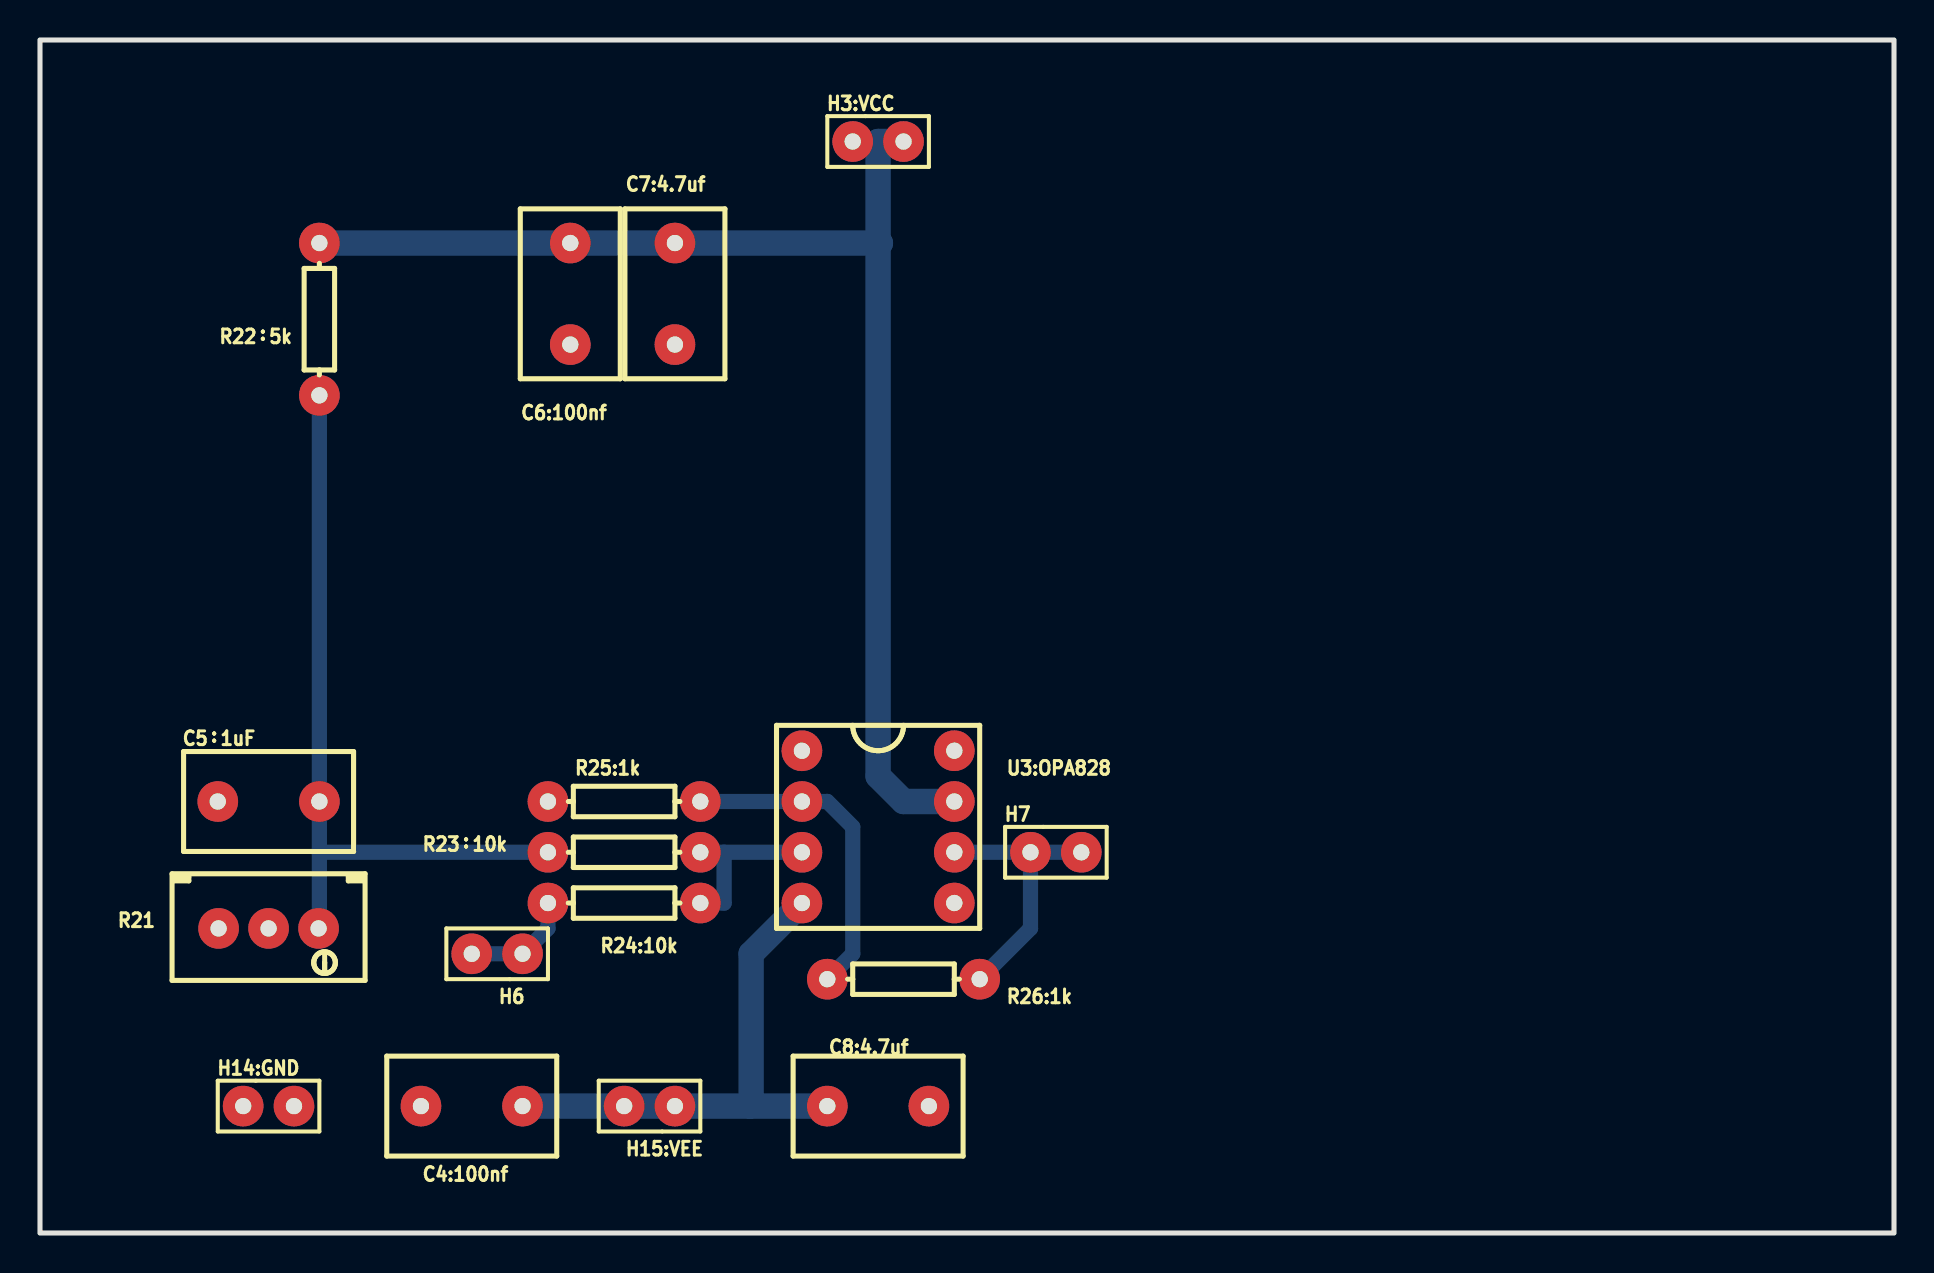
[diagram p12: board, top side]
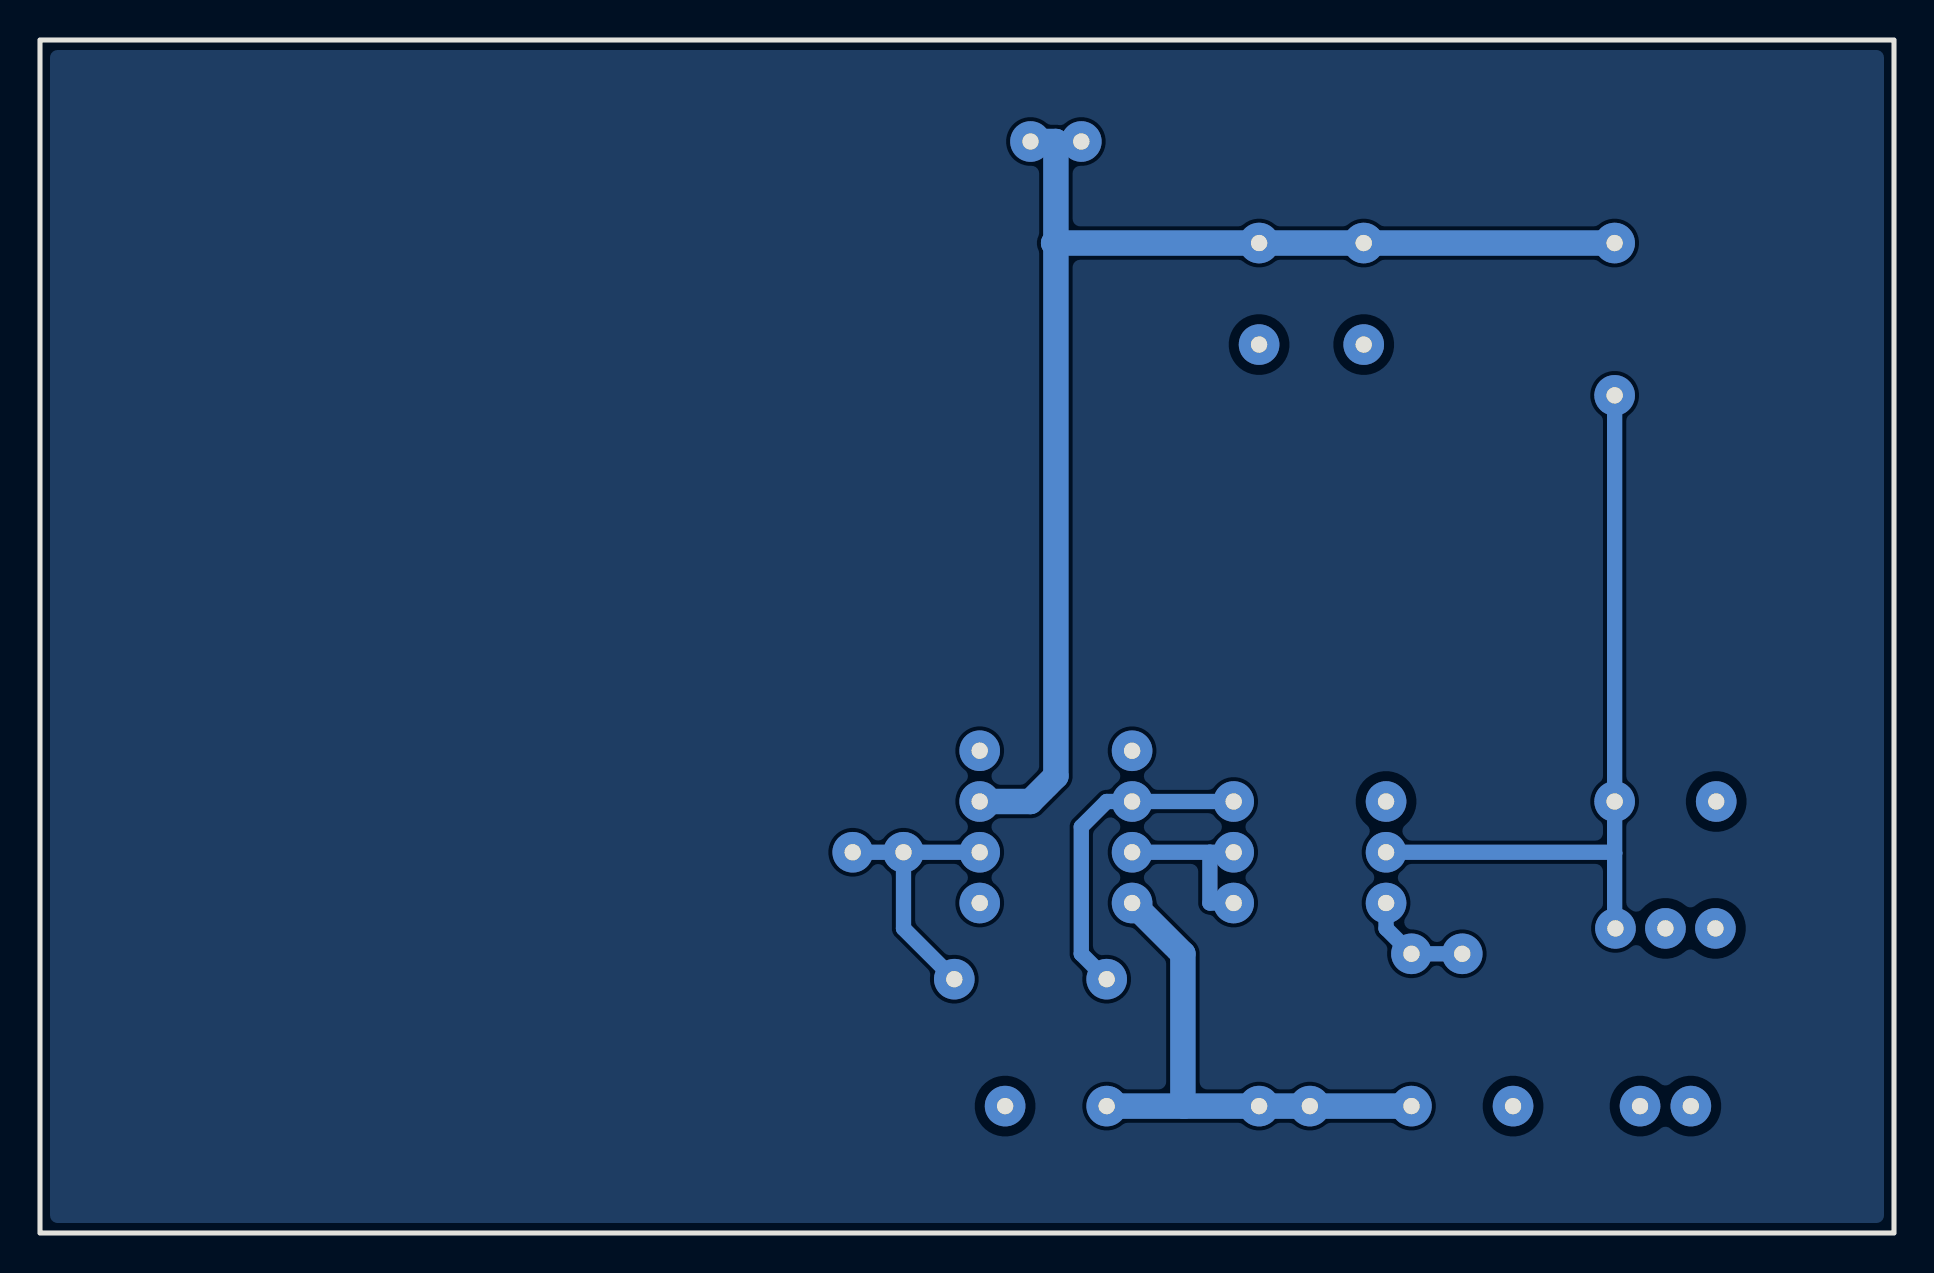
[diagram p13: board, bottom side, seen from below]

Outline 92.71 x 59.69 mm; copper layers: Top Layer, Bottom Layer. Coordinates in mm from the lower left corner of the outline.
Outline path: rectangle 0,59.69 92.71,0
Stack: Top Layer 0.035mm / Dielectric1 1.51mm FR4 er 4.5 / Bottom Layer 0.035mm

## Design rules (mm)
spacing copperThickness1oz: track to track 0.508, other pairs 0.508 to 0.508
spacing copperThickness2oz (default): track to track 0.102, other pairs 0.152 to 0.3
track width copperThickness1oz: min 0.127, default 0.254, max 2.54
track width copperThickness2oz: min 0.203, default 0.254, max 2.54
track width SIGNAL_20mil (default): min 0.762, default 0.762, max 2.54
track width POWER_30mil: min 0.762, default 0.762, max 2.54
differential pair differentialPair (default): width min 0.127, default 0.254, max 2.54; gap min 0.152, default 0.152
net GND uses copperRegion1, copperThickness1oz

## Placement (name value [footprint] x y rotation side)
C4:100nf  100nF  [CAP-TH_L8.5-W5.0-P5.00-D1.2]  21.59 6.35 180 top
C5：1uF  1uF  [CAP-TH_L8.5-W5.0-P5.00-D1.2]  11.43 21.59 0 top
C6:100nf  100nF  [CAP-TH_L8.5-W5.0-P5.00-D1.2]  26.52 46.99 90 top
C7:4.7uf  4.7μF  [CAP-TH_L8.5-W5.0-P5.00-D1.2]  31.75 46.99 90 top
C8:4.7uf  4.7μF  [CAP-TH_L8.5-W5.0-P5.00-D1.2]  41.91 6.35 0 top
H3:VCC  PZ254V-11-02P  [HDR-TH_2P-P2.54-V-M]  41.91 54.61 0 top
H6  PZ254V-11-02P  [HDR-TH_2P-P2.54-V-M]  22.86 13.97 180 top
H7  PZ254V-11-02P  [HDR-TH_2P-P2.54-V-M]  50.8 19.05 0 top
H14:GND  PZ254V-11-02P  [HDR-TH_2P-P2.54-V-M]  11.43 6.35 0 top
H15:VEE  PZ254V-11-02P  [HDR-TH_2P-P2.54-V-M]  30.48 6.35 180 top
R21  5kΩ  [RES-ADJ-TH_3296W-1-104_C48601076]  11.43 15.24 270 top
R22：5k  5kΩ  [R_AXIAL-0.3]  13.97 45.72 90 top
R23：10k  10kΩ  [R_AXIAL-0.3]  29.21 19.05 180 top
R24:10k  10kΩ  [R_AXIAL-0.3]  29.21 16.51 180 top
R25:1k  1kΩ  [R_AXIAL-0.3]  29.21 21.59 180 top
R26:1k  1kΩ  [R_AXIAL-0.3]  43.18 12.7 180 top
U3:OPA828  DS1009-08AT1NX-0A2  [DIP-8_L10.2-W10.2-P2.54-LS7.6-BL]  41.91 20.32 270 top

## Footprints (pads in the part's own frame, mm; a bottom-side part is the same pattern mirrored in y, then rotated)
CAP-TH_L8.5-W5.0-P5.00-D1.2
  round 2.032 hole 0.813: 1(-2.54,0) 2(2.54,0)
DIP-8_L10.2-W10.2-P2.54-LS7.6-BL
  round 2.032 hole 0.813: 1(-3.808,-3.81) 2(-1.27,-3.81) 3(1.27,-3.81) 4(3.81,-3.81) 5(3.81,3.81) 6(1.27,3.81) 7(-1.27,3.81) 8(-3.81,3.81)
HDR-TH_2P-P2.54-V-M
  round 2.032 hole 0.813: 1(-1.27,0) 2(1.27,0)
R_AXIAL-0.3
  round 2.032 hole 0.813: 1(-3.81,0) 2(3.81,0)
RES-ADJ-TH_3296W-1-104_C48601076
  round 2.032 hole 0.813: 1(0,2.5) 2(0,0) 3(0,-2.5)

## Nets
As in the schematic.

Pads without a net: U3:OPA828 1 5 8

## Routing (per net, layer and track width the routed paths; a pad name or vN(x,y) marks a point on that pad's centre or on a via; arc(x,y) is an arc through that point)
VCC: length 65.5
  Bottom Layer w1.27: U3:OPA828.7 43.18,21.59 41.91,22.86 41.91,49.42 42.02,49.53 41.91,49.53 ; 41.91,49.53 C7:4.7uf.2 C6:100nf.2 R22：5k.2 ; 41.91,49.53 41.91,54.61 H3:VCC.2
VEE: length 26.5
  Bottom Layer w1.27: C8:4.7uf.1 35.51,6.35 ; 35.51,6.35 35.56,6.4 35.56,13.97 U3:OPA828.4 ; 35.51,6.35 H15:VEE.1 H15:VEE.2 C4:100nf.1
$1N2043: length 16.3
  Bottom Layer w0.762: R25:1k.1 U3:OPA828.2 39.37,21.59 40.64,20.32 40.64,13.97 R26:1k.2
$1N2044: length 8.8
  Bottom Layer w0.762: R23：10k.1 34.21,19.05 ; 34.21,19.05 U3:OPA828.3 ; 34.21,19.05 34.21,16.51 R24:10k.1
$1N2047: length 38.1
  Bottom Layer w0.762: 13.97,19.01 14.01,19.05 R23：10k.2 ; 13.97,19.01 C5：1uF.2 R22：5k.1 ; 13.97,19.01 13.97,15.28 R21.1
$1N2065: length 5.6
  Bottom Layer w0.762: R24:10k.2 25.4,15.24 H6.1 H6.2
$1N2070: length 13.8
  Bottom Layer w0.762: H7.1 H7.2 ; H7.1 U3:OPA828.6 ; H7.1 49.53,15.24 R26:1k.1

## Copper pours and planes (outline as drawn; the poured copper is in the pictures)
GND on Bottom Layer: 0,59.69 92.71,59.69 92.71,0 0,0
GND on Bottom Layer: 0,59.69 92.71,59.69 92.71,0 0,0

# Board PCB2
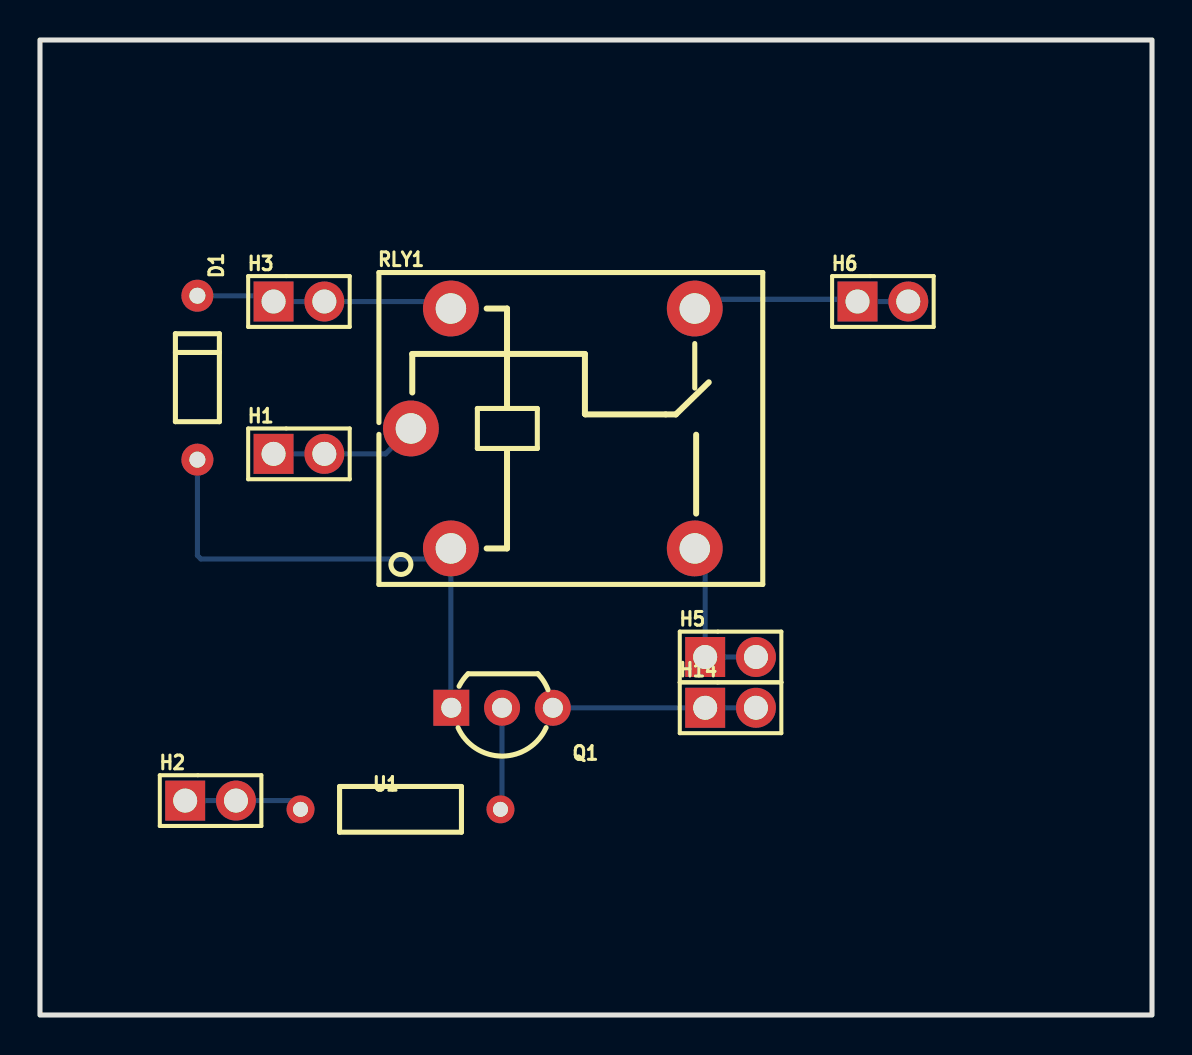
[diagram p14: board, top side]
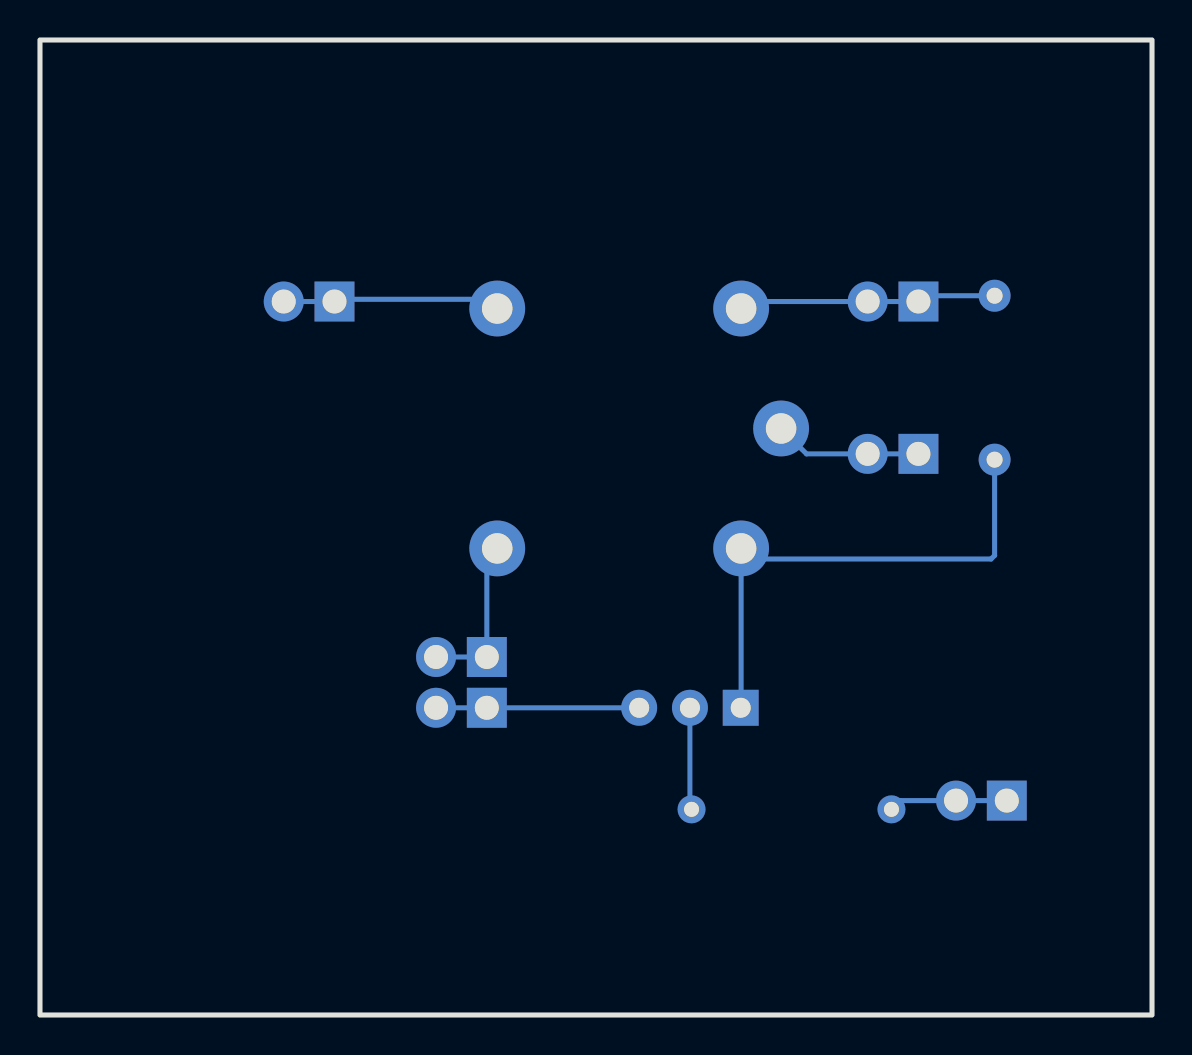
[diagram p15: board, bottom side, seen from below]

Outline 55.63 x 48.77 mm; copper layers: Top Layer, Bottom Layer. Coordinates in mm from the lower left corner of the outline.
Outline path: rectangle 0,48.77 55.63,0
Stack: Top Layer 0.035mm / Dielectric1 1.51mm FR4 er 4.5 / Bottom Layer 0.035mm

## Design rules (mm)
spacing copperThickness1oz (default): track to track 0.102, other pairs 0.152 to 0.3
spacing copperThickness2oz: track to track 0.203, other pairs 0.152 to 0.3
track width copperThickness1oz (default): min 0.127, default 0.254, max 2.54
track width copperThickness2oz: min 0.203, default 0.254, max 2.54
differential pair differentialPair (default): width min 0.127, default 0.254, max 2.54; gap min 0.152, default 0.152

## Placement (name value [footprint] x y rotation side)
D1  1N4148  [DO-35_BD2.0-L4.2-P8.20-D0.5-RD]  7.87 31.88 270 top
H1  PZ254V-11-02P  [HDR-TH_2P-P2.54-V-M]  12.95 28.07 0 top
H2  PZ254V-11-02P  [HDR-TH_2P-P2.54-V-M]  8.53 10.72 0 top
H3  PZ254V-11-02P  [HDR-TH_2P-P2.54-V-M]  12.95 35.69 0 top
H5  PZ254V-11-02P  [HDR-TH_2P-P2.54-V-M]  34.54 17.91 0 top
H6  PZ254V-11-02P  [HDR-TH_2P-P2.54-V-M]  42.16 35.69 0 top
H14  PZ254V-11-02P  [HDR-TH_2P-P2.54-V-M]  34.54 15.37 0 top
Q1  8050  [TO-92-3_L4.8-W3.7-P2.54-R]  23.11 15.37 180 top
RLY1  SRD-05VDC-SL-C  [RELAY-TH_SRD-XXVDC-XL-C]  25.65 29.34 0 top
U1  470  [RES-TH_BD2.2-L6.0-P10.00-D0.5]  18.03 10.29 0 top

## Footprints (pads in the part's own frame, mm; a bottom-side part is the same pattern mirrored in y, then rotated)
DO-35_BD2.0-L4.2-P8.20-D0.5-RD
  round 1.6 hole 0.8: 1(-4.1,0) 2(4.1,0)
HDR-TH_2P-P2.54-V-M
  rect 2x2 hole 1.2: 1(-1.27,0)
  round 2 hole 1.2: 2(1.27,0)
RELAY-TH_SRD-XXVDC-XL-C
  round 2.794 hole 1.524: 1(-5.1,-6) 2(7.1,-6) 3(7.1,6) 4(-5.1,6) 5(-7.1,0)
RES-TH_BD2.2-L6.0-P10.00-D0.5
  round 1.4 hole 0.75: 1(-5,0) 2(5,0)
TO-92-3_L4.8-W3.7-P2.54-R
  rect 1.8x1.8 hole 1: 1(2.54,0)
  round 1.8 hole 1: 2(0,0) 3(-2.54,0)

## Nets
As in the schematic.

## Routing (per net, layer and track width the routed paths; a pad name or vN(x,y) marks a point on that pad's centre or on a via; arc(x,y) is an arc through that point)
GND: length 10.2
  Bottom Layer w0.254: H14.2 H14.1 Q1.3
VCC: length 12.9
  Bottom Layer w0.254: D1.1 11.39,35.98 H3.1 H3.2 20.2,35.69 RLY1.4
$1N3: length 7.4
  Bottom Layer w0.254: H1.1 H1.2 17.28,28.07 RLY1.5
$1N4: length 25.7
  Bottom Layer w0.254: Q1.1 20.55,15.39 RLY1.1 20.02,22.81 8.05,22.81 7.87,22.99 D1.2
$1N8: length 5.1
  Bottom Layer w0.254: U1.2 23.11,10.37 Q1.2
$1N10: length 6
  Bottom Layer w0.254: U1.1 12.6,10.72 H2.2 H2.1
$1N11: length 11.2
  Bottom Layer w0.254: 32.75,35.34 32.75,35.8 40.78,35.8 H6.1 H6.2
$1N14: length 8.2
  Bottom Layer w0.254: H5.2 H5.1 33.27,22.82 RLY1.2

# Board 已知模型电路
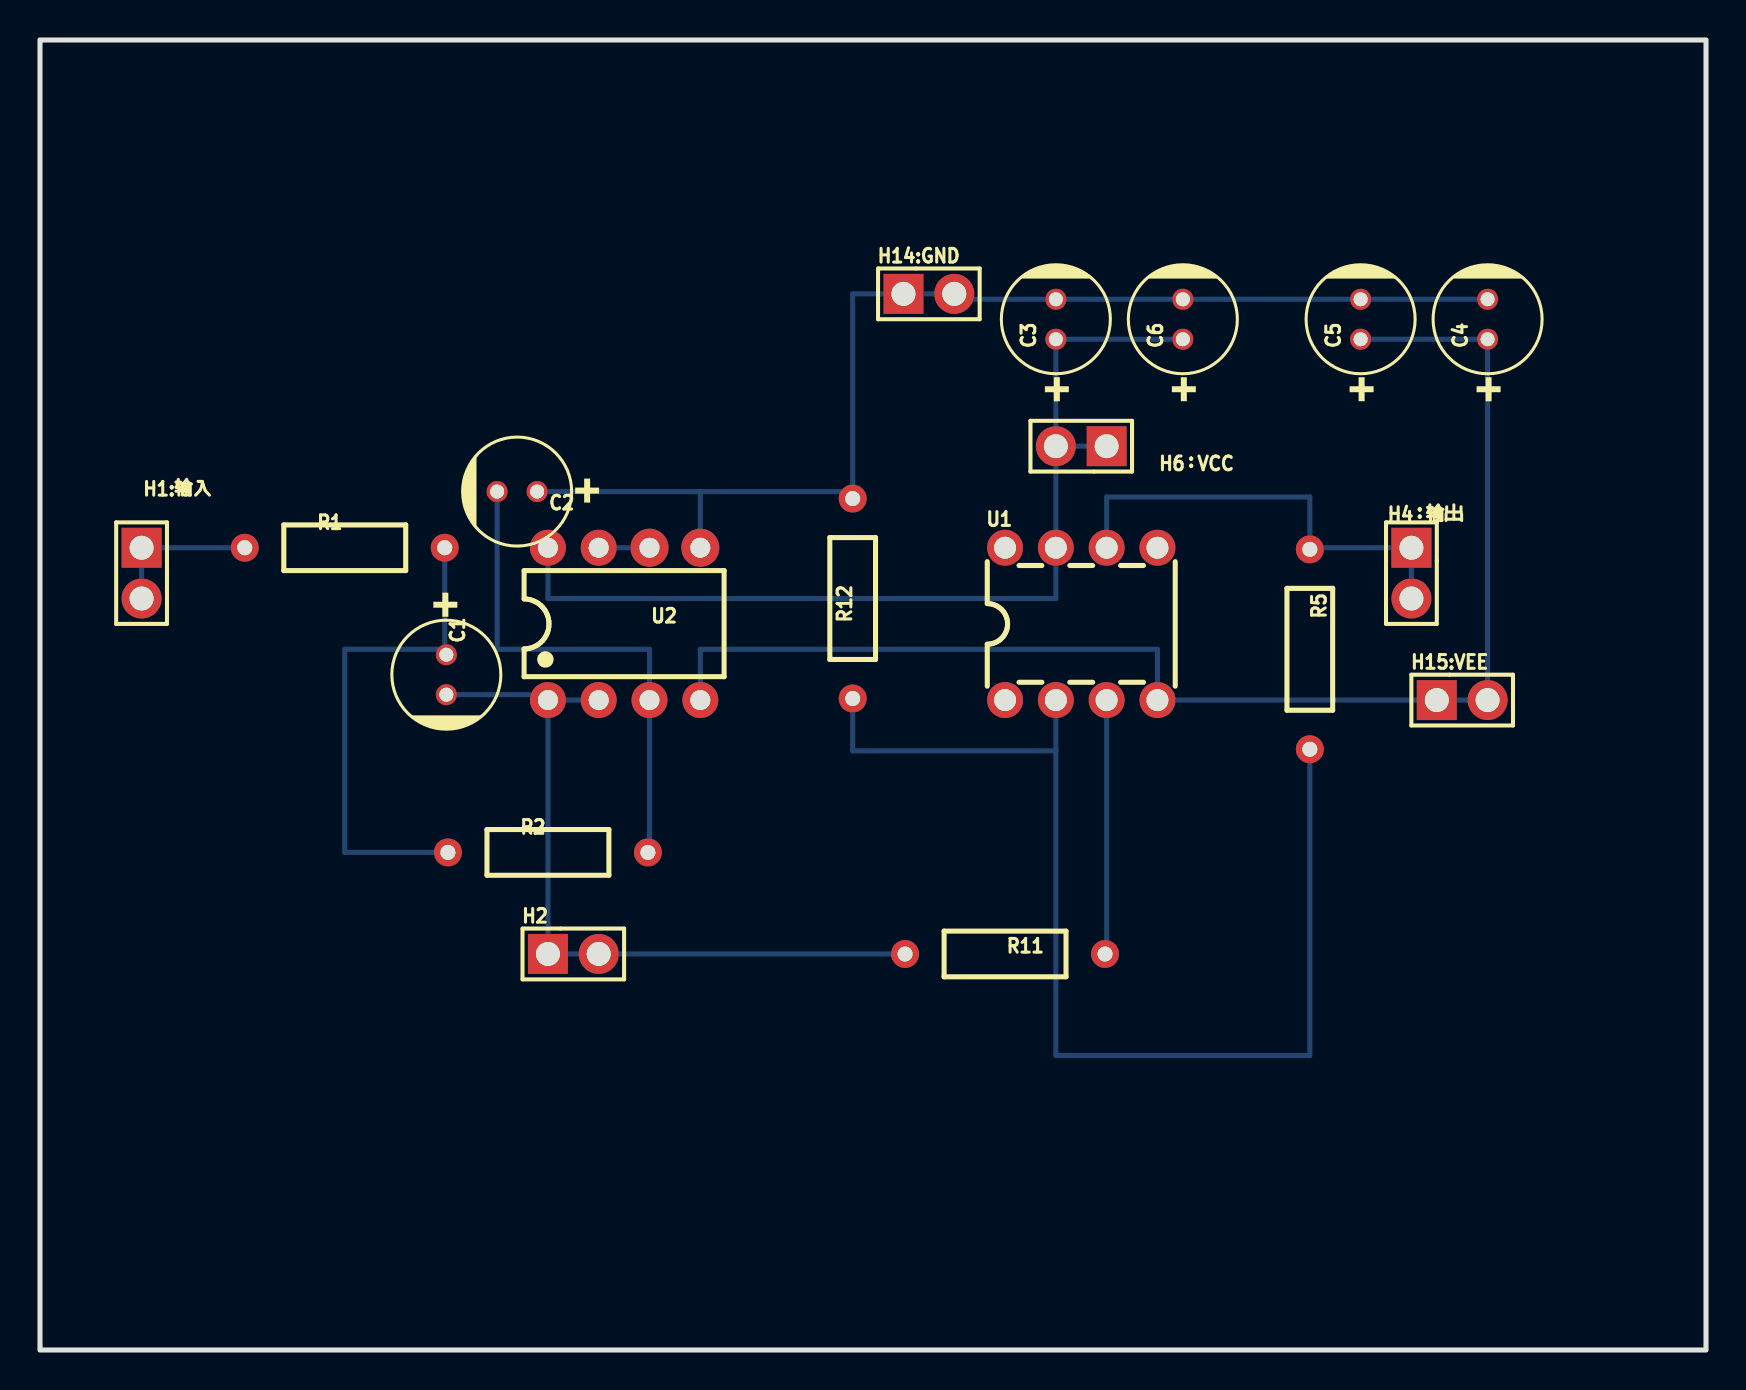
[diagram p16: board, top side]
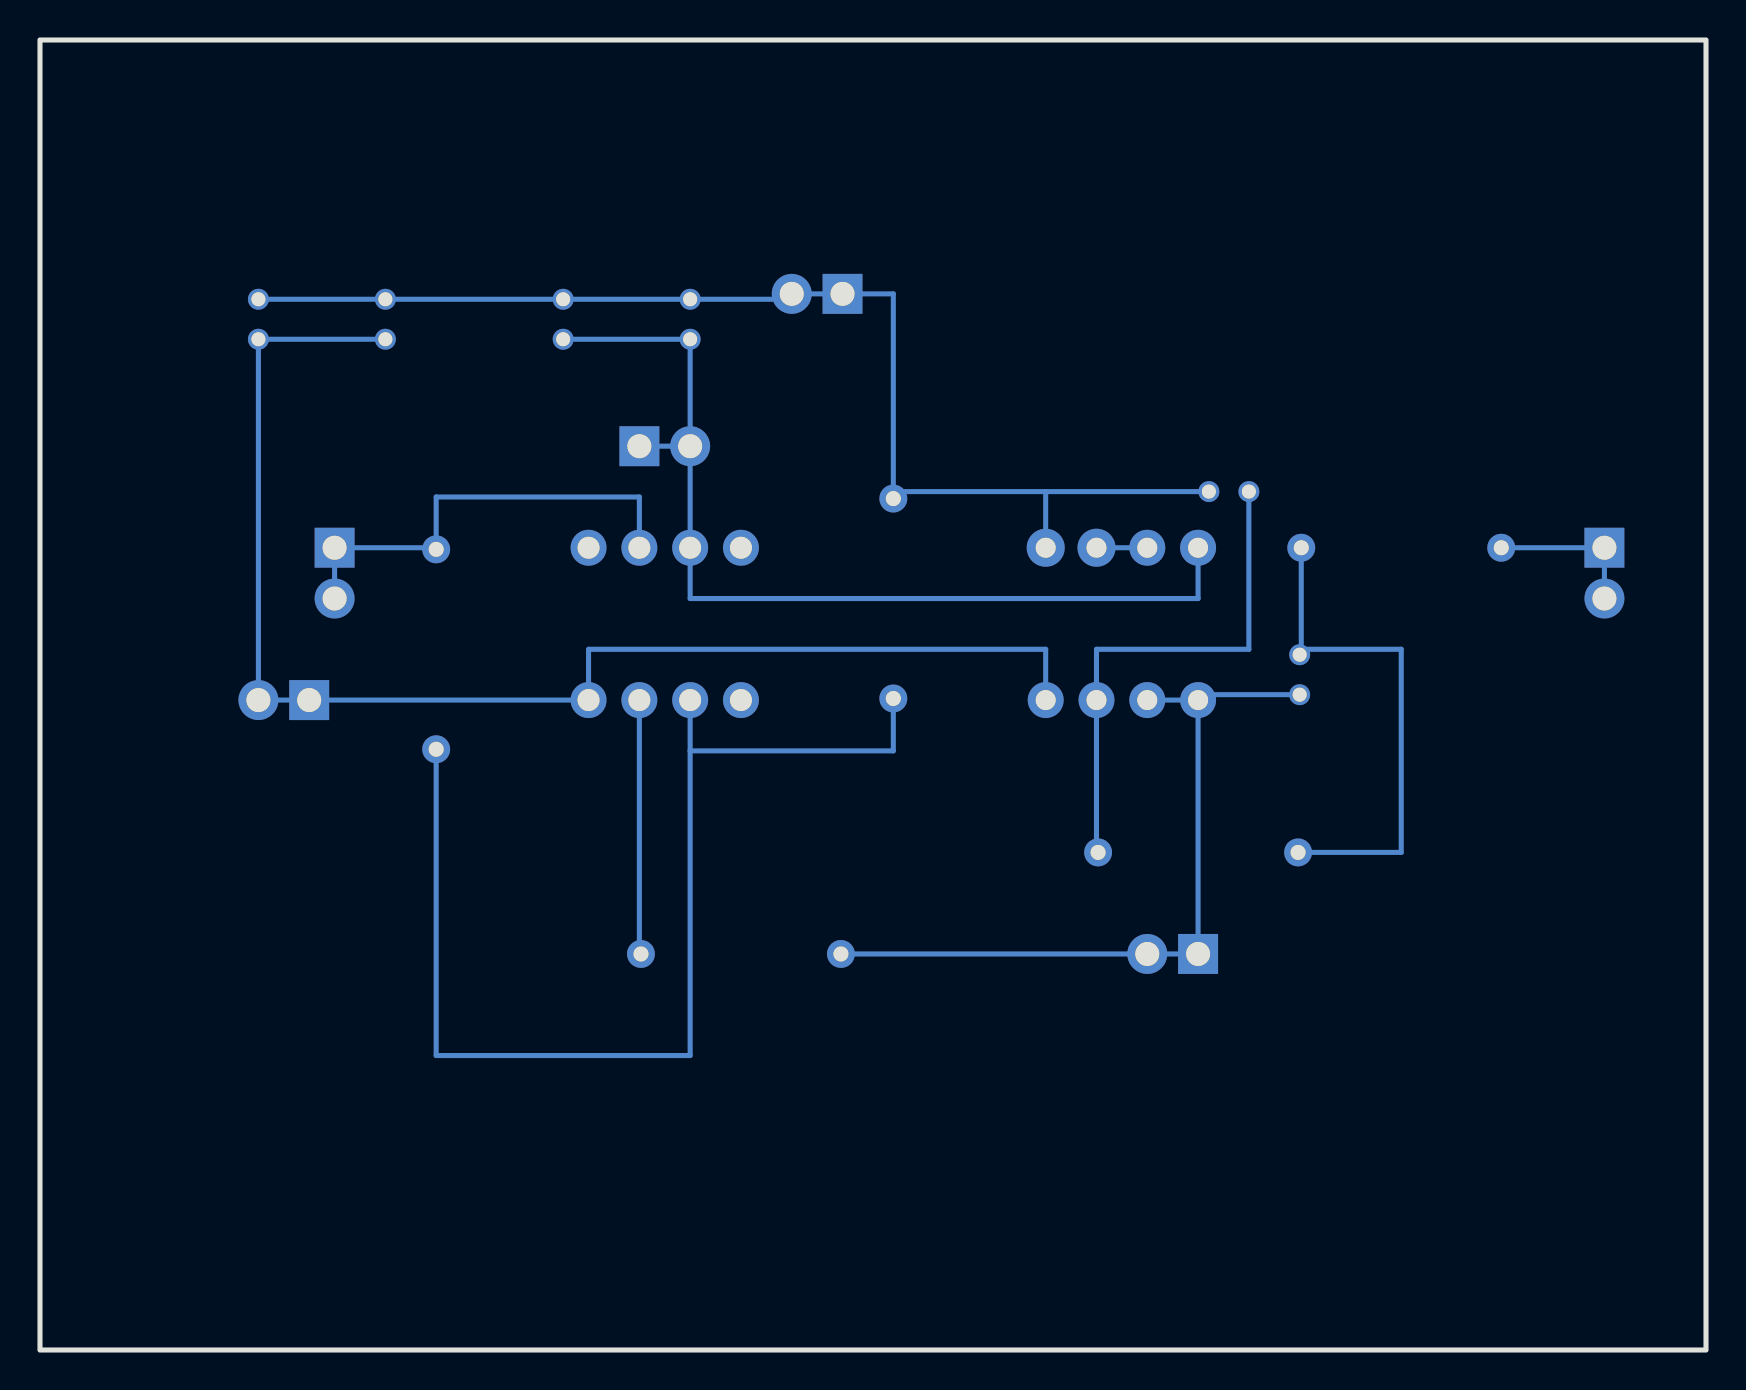
[diagram p17: board, bottom side, seen from below]

Outline 83.31 x 65.53 mm; copper layers: Top Layer, Bottom Layer. Coordinates in mm from the lower left corner of the outline.
Outline path: rectangle 0,65.53 83.31,0
Stack: Top Layer 0.035mm / Dielectric1 1.51mm FR4 er 4.5 / Bottom Layer 0.035mm

## Design rules (mm)
spacing copperThickness1oz (default): track to track 0.102, other pairs 0.152 to 0.3
spacing copperThickness2oz: track to track 0.203, other pairs 0.152 to 0.3
track width copperThickness1oz (default): min 0.127, default 0.254, max 2.54
track width copperThickness2oz: min 0.203, default 0.254, max 2.54
differential pair differentialPair (default): width min 0.127, default 0.254, max 2.54; gap min 0.152, default 0.152

## Placement (name value [footprint] x y rotation side)
C1  4.4nF  [CAP-TH_BD5.3-P2.00-D0.5-FD]  20.32 33.78 270 top
C2  10nF  [CAP-TH_BD5.3-P2.00-D0.5-FD]  23.86 42.94 180 top
C3  100nF  [CAP-TH_BD5.3-P2.00-D0.5-FD]  50.8 51.56 90 top
C4  100nF  [CAP-TH_BD5.3-P2.00-D0.5-FD]  72.39 51.56 90 top
C5  100nF  [CAP-TH_BD5.3-P2.00-D0.5-FD]  66.04 51.56 90 top
C6  100nF  [CAP-TH_BD5.3-P2.00-D0.5-FD]  57.15 51.56 90 top
H1:输入  PZ254V-11-02P  [HDR-TH_2P-P2.54-V-M]  5.08 38.86 270 top
H2  PZ254V-11-02P  [HDR-TH_2P-P2.54-V-M]  26.67 19.81 0 top
H4：输出  PZ254V-11-02P  [HDR-TH_2P-P2.54-V-M]  68.58 38.86 270 top
H6：VCC  PZ254V-11-02P  [HDR-TH_2P-P2.54-V-M]  52.07 45.21 180 top
H14:GND  PZ254V-11-02P  [HDR-TH_2P-P2.54-V-M]  44.45 52.83 0 top
H15:VEE  PZ254V-11-02P  [HDR-TH_2P-P2.54-V-M]  71.12 32.51 0 top
R1  15K  [RES-TH_BD2.2-L6.0-P10.00-D0.5]  15.24 40.13 0 top
R2  15K  [RES-TH_BD2.2-L6.0-P10.00-D0.5]  25.4 24.89 0 top
R5  40K  [RES-TH_BD2.2-L6.0-P10.00-D0.5]  63.5 35.05 270 top
R11  8.2K  [RES-TH_BD2.2-L6.0-P10.00-D0.5]  48.26 19.81 0 top
R12  10K  [RES-TH_BD2.2-L6.0-P10.00-D0.5]  40.64 37.59 90 top
U1  OP27EN  [PDIP-8_L9.3-W6.4-P2.54-LS7.6-BL]  52.07 36.32 0 top
U2  NE5532AP  [PDIP-8_L9.6-W6.4-P2.54-LS7.6-BL]  29.21 36.32 0 top

## Footprints (pads in the part's own frame, mm; a bottom-side part is the same pattern mirrored in y, then rotated)
CAP-TH_BD5.3-P2.00-D0.5-FD
  round 1.052 hole 0.701: 1(-1,0) 2(1,0)
HDR-TH_2P-P2.54-V-M
  rect 2x2 hole 1.2: 1(-1.27,0)
  round 2 hole 1.2: 2(1.27,0)
PDIP-8_L9.3-W6.4-P2.54-LS7.6-BL
  round 1.8 hole 1.1: 1(-3.81,-3.81) 2(-1.27,-3.81) 3(1.27,-3.81) 4(3.81,-3.81) 5(3.81,3.81) 6(1.27,3.81) 7(-1.27,3.81) 8(-3.81,3.81)
PDIP-8_L9.6-W6.4-P2.54-LS7.6-BL
  round 1.8 hole 1: 1(-3.81,-3.81) 2(-1.27,-3.81) 3(1.27,-3.81) 4(3.81,-3.81) 7(-1.27,3.81) 8(-3.81,3.81)
  round 1.905 hole 1: 5(3.81,3.81) 6(1.27,3.81)
RES-TH_BD2.2-L6.0-P10.00-D0.5
  round 1.4 hole 0.75: 1(-5,0) 2(5,0)

## Nets
GND: C2.1 C3.2 C4.2 C5.2 C6.2 H14:GND.1 H14:GND.2 R12.2 U2.5
VCC: C3.1 C6.1 H6：VCC.1 H6：VCC.2 U1.7 U2.8
VEE: C4.1 C5.1 H15:VEE.1 H15:VEE.2 U1.4 U2.4
$1N7: H1:输入.1 H1:输入.2 R1.1
$1N8: C1.1 R1.2 R2.1
$1N9: C2.2 R2.2 U2.3
$1N13: C1.2 H2.1 H2.2 R11.1 U2.1 U2.2
$1N15: R11.2 U1.3
$1N16: R5.2 R12.1 U1.2
$1N35: U2.6 U2.7
$1N44: H4：输出.1 H4：输出.2 R5.1 U1.6

Pads without a net: U1 1 5 8

## Routing (per net, layer and track width the routed paths; a pad name or vN(x,y) marks a point on that pad's centre or on a via; arc(x,y) is an arc through that point)
GND: length 60.8
  Bottom Layer w0.254: C2.1 33.02,42.94 ; 33.02,42.94 U2.5 ; 33.02,42.94 40.64,42.94 ; C4.2 C5.2 C6.2 C3.2 45.72,52.56 H14:GND.2 H14:GND.1 40.64,52.83 40.64,42.94 ; 40.64,42.94 R12.2
VCC: length 49.8
  Bottom Layer w0.254: U2.8 25.4,37.59 50.8,37.59 U1.7 H6：VCC.2 ; C6.1 C3.1 H6：VCC.2 ; H6：VCC.2 H6：VCC.1
VEE: length 69.1
  Bottom Layer w0.254: 66.04,50.29 C5.1 C4.1 H15:VEE.2 H15:VEE.1 U1.4 55.88,35.05 33.02,35.05 U2.4
$1N7: length 7.7
  Bottom Layer w0.254: H1:输入.2 H1:输入.1 R1.1
$1N8: length 25.8
  Bottom Layer w0.254: R1.2 20.24,35.05 ; 20.24,35.05 20.32,35.05 C1.1 ; 20.24,35.05 15.24,35.05 15.24,24.89 R2.1
$1N9: length 25.7
  Bottom Layer w0.254: C2.2 22.86,35.05 30.48,35.05 U2.3 30.48,24.89 R2.2
$1N13: length 38.4
  Bottom Layer w0.254: U2.1 25.4,32.78 C1.2 ; U2.1 U2.2 ; U2.1 H2.1 H2.2 R11.1
$1N15: length 12.8
  Bottom Layer w0.254: U1.3 53.34,19.81 R11.2
$1N16: length 58.6
  Bottom Layer w0.254: 50.8,29.97 50.8,14.73 63.5,14.73 R5.2 ; 50.8,29.97 40.64,29.97 R12.1 ; 50.8,29.97 U1.2
$1N35: length 2.5
  Bottom Layer w0.254: U2.7 U2.6
$1N44: length 22.9
  Bottom Layer w0.254: U1.6 53.34,42.67 63.5,42.67 63.5,40.13 ; 63.5,40.13 H4：输出.1 H4：输出.2 ; 63.5,40.13 R5.1
